# EAGLE schematic PCB_schematic_v1 (EAGLE 9.6.2)
Assembly variants: +3V3
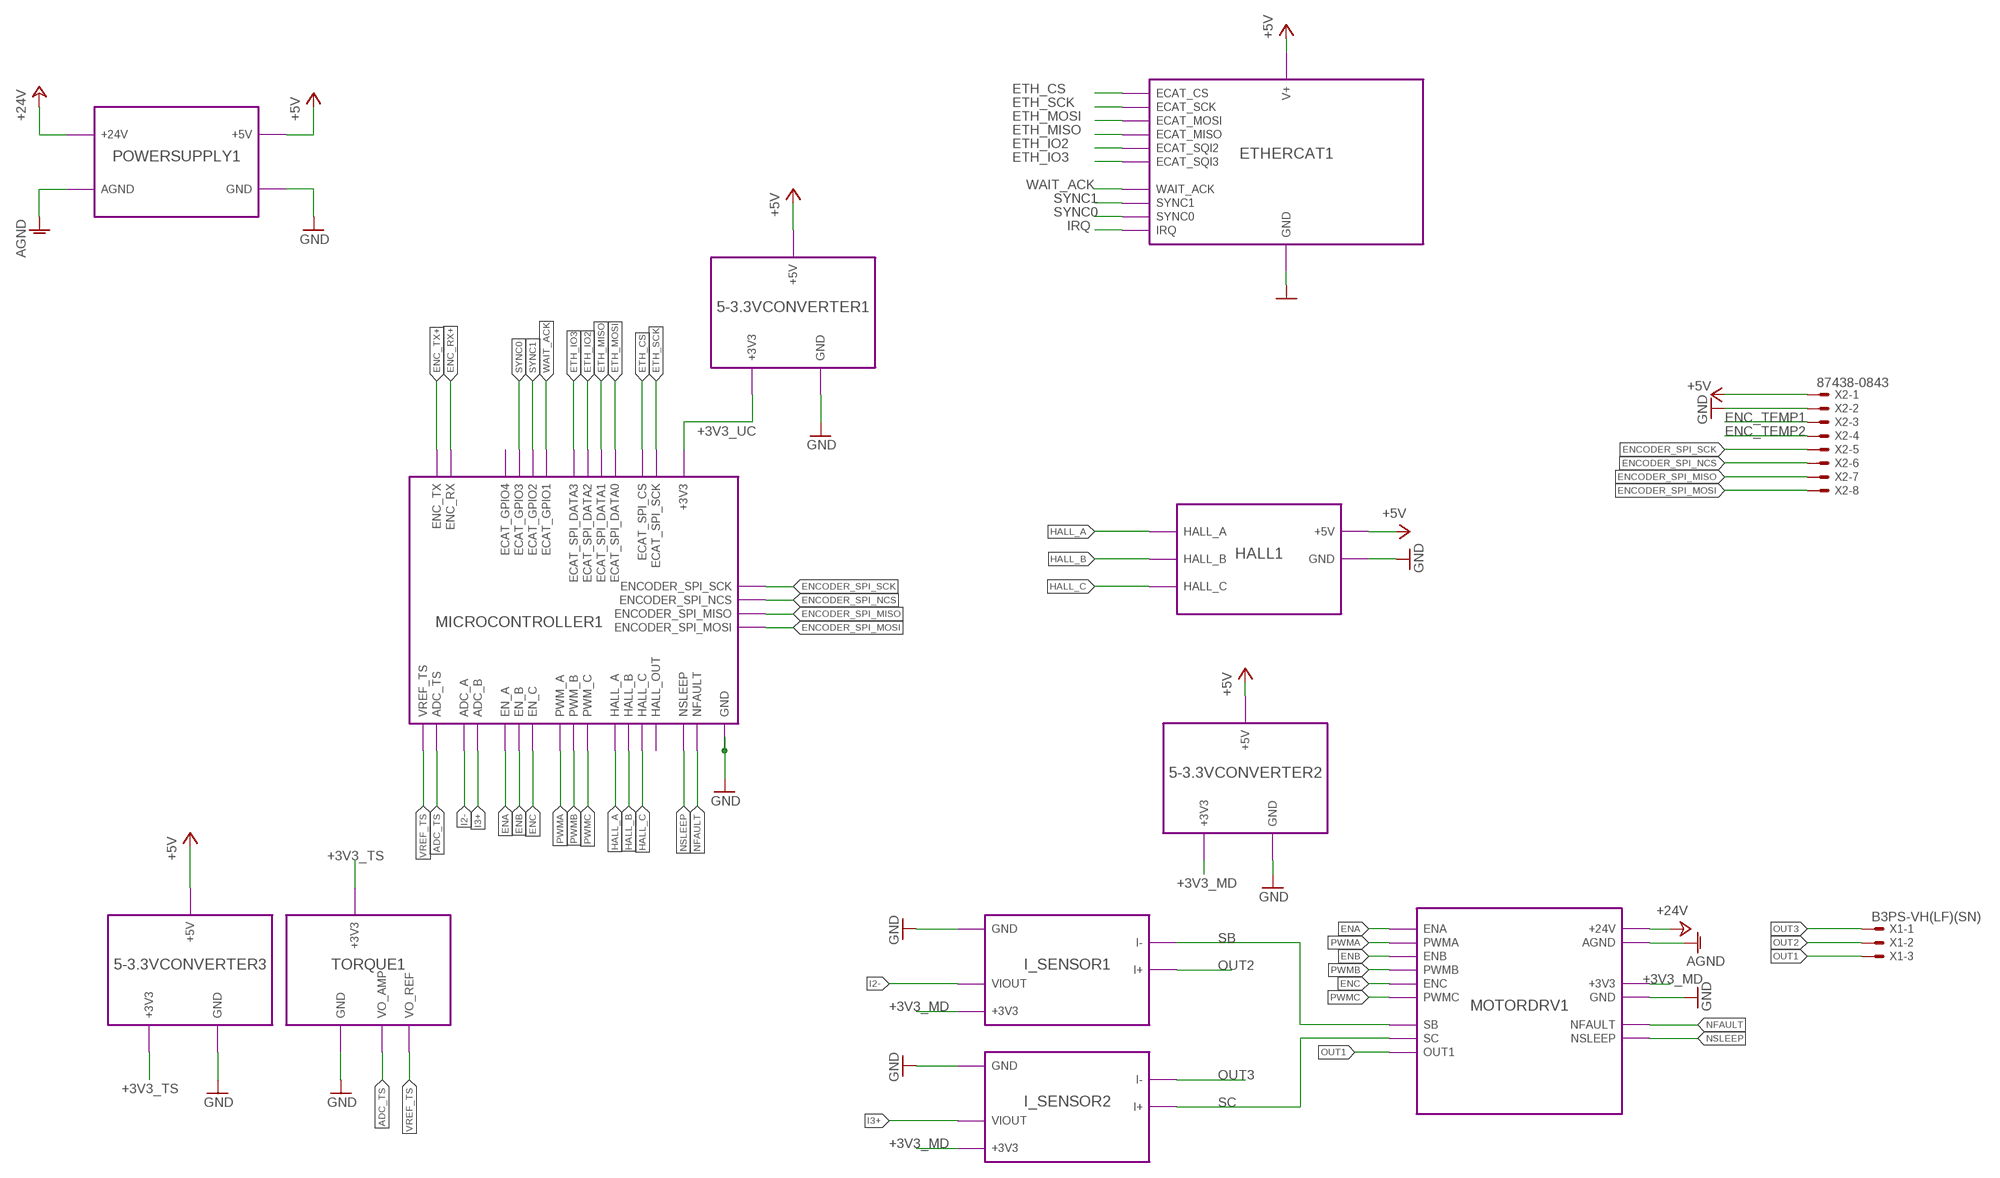
[diagram p0: schematic, sheet 1]

## Parts
X1  B3PS-VH(LF)(SN)  [B3PS-VH(LF)(SN)]
X2  87438-0843  [87438-08]

## Module instances
POWERSUPPLY1 = POWERSUPPLY
MOTORDRV1 = MOTORDRV
I_SENSOR1 = I_SENSOR
I_SENSOR2 = I_SENSOR
TORQUE1 = TORQUE
ETHERCAT1 = ETHERCAT
HALL1 = HALL
5-3.3VCONVERTER3 = 5-3.3VCONVERTER$A
5-3.3VCONVERTER1 = 5-3.3VCONVERTER$B
5-3.3VCONVERTER2 = 5-3.3VCONVERTER$C
MICROCONTROLLER1 = MICROCONTROLLER

## Nets
+3V3_MD: port 5-3.3VCONVERTER2.+3V3 I_SENSOR1.+3V3 I_SENSOR2.+3V3 MOTORDRV1.+3V3
+3V3_TS: port 5-3.3VCONVERTER3.+3V3 TORQUE1.+3V3
+3V3_UC: port 5-3.3VCONVERTER1.+3V3 MICROCONTROLLER1.+3V3
+5V: X2.1 ; port POWERSUPPLY1.+5V ETHERCAT1.V+ 5-3.3VCONVERTER2.+5V HALL1.+5V 5-3.3VCONVERTER1.+5V 5-3.3VCONVERTER3.+5V
+24V [Power]: port MOTORDRV1.+24V POWERSUPPLY1.+24V
ADC_TS: port TORQUE1.VO_AMP MICROCONTROLLER1.ADC_TS
AGND [Power]: port MOTORDRV1.AGND POWERSUPPLY1.AGND
ENA: port MOTORDRV1.ENA MICROCONTROLLER1.EN_A
ENB: port MOTORDRV1.ENB MICROCONTROLLER1.EN_B
ENC: port MOTORDRV1.ENC MICROCONTROLLER1.EN_C
ENC_RX+: port MICROCONTROLLER1.ENC_RX
ENC_TEMP1: X2.3
ENC_TEMP2: X2.4
ENC_TX+: port MICROCONTROLLER1.ENC_TX
ENCODER_SPI_MISO: X2.7 ; port MICROCONTROLLER1.ENCODER_SPI_MISO
ENCODER_SPI_MOSI: X2.8 ; port MICROCONTROLLER1.ENCODER_SPI_MOSI
ENCODER_SPI_NCS: X2.6 ; port MICROCONTROLLER1.ENCODER_SPI_NCS
ENCODER_SPI_SCK: X2.5 ; port MICROCONTROLLER1.ENCODER_SPI_SCK
ETH_CS: port ETHERCAT1.ECAT_CS MICROCONTROLLER1.ECAT_SPI_CS
ETH_IO2: port ETHERCAT1.ECAT_SQI2 MICROCONTROLLER1.ECAT_SPI_DATA2
ETH_IO3: port ETHERCAT1.ECAT_SQI3 MICROCONTROLLER1.ECAT_SPI_DATA3
ETH_MISO: port ETHERCAT1.ECAT_MISO MICROCONTROLLER1.ECAT_SPI_DATA1
ETH_MOSI: port ETHERCAT1.ECAT_MOSI MICROCONTROLLER1.ECAT_SPI_DATA0
ETH_SCK: port ETHERCAT1.ECAT_SCK MICROCONTROLLER1.ECAT_SPI_SCK
GND: X2.2 ; port I_SENSOR1.GND I_SENSOR2.GND MOTORDRV1.GND POWERSUPPLY1.GND ETHERCAT1.GND TORQUE1.GND HALL1.GND 5-3.3VCONVERTER1.GND 5-3.3VCONVERTER3.GND MICROCONTROLLER1.GND 5-3.3VCONVERTER2.GND
HALL_A: port HALL1.HALL_A MICROCONTROLLER1.HALL_A
HALL_B: port HALL1.HALL_B MICROCONTROLLER1.HALL_B
HALL_C: port HALL1.HALL_C MICROCONTROLLER1.HALL_C
I2-: port I_SENSOR1.VIOUT MICROCONTROLLER1.ADC_A
I3+: port I_SENSOR2.VIOUT MICROCONTROLLER1.ADC_B
IRQ: port ETHERCAT1.IRQ
NFAULT: port MOTORDRV1.NFAULT MICROCONTROLLER1.NFAULT
NSLEEP: port MOTORDRV1.NSLEEP MICROCONTROLLER1.NSLEEP
OUT1 [Power]: X1.1 ; port MOTORDRV1.OUT1
OUT2 [Power]: X1.2 ; port I_SENSOR1.I+
OUT3 [Power]: X1.3 ; port I_SENSOR2.I-
PWMA: port MOTORDRV1.PWMA MICROCONTROLLER1.PWM_A
PWMB: port MOTORDRV1.PWMB MICROCONTROLLER1.PWM_B
PWMC: port MOTORDRV1.PWMC MICROCONTROLLER1.PWM_C
SB: port MOTORDRV1.SB I_SENSOR1.I-
SC: port MOTORDRV1.SC I_SENSOR2.I+
SYNC0: port ETHERCAT1.SYNC0 MICROCONTROLLER1.ECAT_GPIO3
SYNC1: port ETHERCAT1.SYNC1 MICROCONTROLLER1.ECAT_GPIO2
VREF_TS: port TORQUE1.VO_REF MICROCONTROLLER1.VREF_TS
WAIT_ACK: port ETHERCAT1.WAIT_ACK MICROCONTROLLER1.ECAT_GPIO1

## Library data of the parts
X1 = msrm:B3PS-VH(LF)(SN): Connector Header Through Hole, Right Angle 3 position 0.156" (3.96mm) 455-1649 ___ Source: Digikey <https://www.digikey.de/product-detail/en/jst-sales-america-inc/B3PS-VH-LF-SN/455-1649-ND/926556> ; Datasheet <http://www.jst-mfg.com/product/pdf/eng/eVH.pdf>; DIGIKEY: 455-1649-ND
X2 = msrm:8743?-08*3: Wire-to-Board 1.50mm (.059") Pitch Header - SMT, Shrouded Source: http://www.molex.com/product/micro/87437.html; DIGIKEY: WM7652CT-ND

## Module POWERSUPPLY
Ports: +24V(pwr) AGND(pwr) +5V(pwr) GND(pwr)
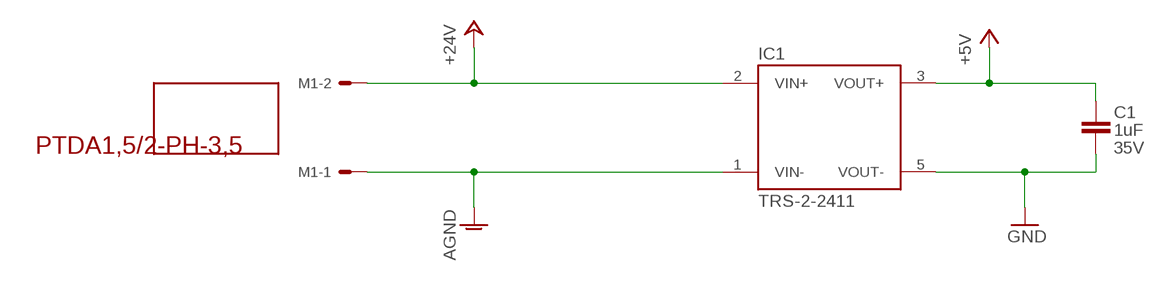
[diagram p1: schematic, module POWERSUPPLY, sheet 1]

### Parts
C1  GRM155R6YA105KE11D  [C0402]
IC1  TRS-2-2411  [7-SMD]
M1  PST1,3/2-3,5  [1945096]
U$1  PTDA1,5/2-PH-3,5  [1725107]

### Nets
+5V: C1.1 IC1.3(VOUT+)
+24V: IC1.2(VIN+) M1.2
AGND: IC1.1(VIN-) M1.1
GND: C1.2 IC1.5(VOUT-)

### Library data of the parts
C1 = msrm:GRM?R6*: CAP CER 0.1UF 100V X5R 0402 Part Numbering <https://search.murata.co.jp/Ceramy/image/img/A01X/partnumbering_e_01.pdf> package: C0402 : 4700pF ___ Source: Digikey <https://www.digikey.de/products/en?keywords=490-6317-1-ND‎> ; Datasheet <https://search.murata.co.jp/Ceramy/image/img/A01X/G101/ENG/GRM155R61H472KA01-01.pdf> 100nF_±10% ___ Source: Digikey <https://www.digikey.de/products/en?keywords=490-10458-1-ND> ; Datasheet <https://search.murata.co.jp/Ceramy/image/img/A01X/G101/ENG/GRM155R62A104KE14-01.pdf> 100nF_±20% ___ Source: Digikey <https://www.digikey.de/products/en?keywords=490-10459-1-ND> ; Datasheet <https://search.murata.co.jp/Ceramy/image/img/A01X/G101/ENG/GRM155R62A104ME14-01.pdf>; CAPACITANCE: 1uF; DIGIKEY: 490-10019-1-ND; TOLERANCE: ±10%; VOLTAGE: 35V
IC1 = msrm:TRS-2-: Isolated Module DC DC Converter 1 Output Datasheet <https://www.tracopower.com/products/trs2.pdf> package: 7-SMD : Input 24V 3300µF / 3.3V ___ Source: Digikey <https://www.digikey.de/products/en?keywords=1951-2041-ND> 1680µF / 5V ___ Source: Digikey <https://www.digikey.de/products/en?keywords=1951-2042-ND> 820µF / 12V ___ Source: Digikey <https://www.digikey.de/products/en?keywords=1951-2043-ND> 680µF / 15V ___ Source: Digikey <https://www.digikey.de/products/en?keywords=1951-2044-ND> 220µF / 24V ___ Source: Digikey <https://www.digikey.de/products/en?keywords=1951-2045-ND> 1000µF / 9V ___ Source: Digikey <https://www.digikey.de/products/en?keywords=TRS2-0919-ND> Input 24V 3300µF / 3.3V ___ Source: Digikey <https://www.digikey.de/products/en?keywords=1951-2057-ND> 1680µF / 5V ___ Source: Digikey <https://www.digikey.de/products/en?keywords=1951-2058-ND> 820µF / 12V ___ Source: Digikey <https://www.digikey.de/products/en?keywords=1951-2059-ND> 680µF / 15V ___ Source: Digikey <https://www.digikey.de/products/en?keywords=1951-2060-ND> 220µF / 24V ___ Source: Digikey <https://www.digikey.de/products/en?keywords=1951-2061-ND> 1000µF / 9V ___ Source: Digikey <https://www.digikey.de/products/en?keywords=TRS2-2419-ND> Input 48V 3300µF / 3.3V ___ Source: Digikey <https://www.digikey.de/products/en?keywords=1951-2065-ND> 1680µF / 5V ___ Source: Digikey <https://www.digikey.de/products/en?keywords=1951-2066-ND> 820µF / 12V ___ Source: Digikey <https://www.digikey.de/products/en?keywords=1951-2067-ND> 680µF / 15V ___ Source: Digikey <https://www.digikey.de/products/en?keywords=1951-2068-ND> 220µF / 24V ___ Source: Digikey <https://www.digikey.de/products/en?keywords=1951-2069-ND> 1000µF / 9V ___ Source: Digikey <https://www.digikey.de/products/en?keywords=TRS2-4819-ND>; CURRENT: 400mA; DIGIKEY: 1951-2058-ND; INPUT: 24V; MAX_CAPACITANCE: 1680uF; OUTPUT: 5V
M1 = msrm:PST*/2-?: 2 Position Terminal Block Header, Male Pins, Unshrouded 0.138" (3.50mm) Vertical Through Hole 277-1749-ND ___ Source: Digikey <https://www.digikey.de/products/en?keywords=277-1749-ND> ; Datasheet <https://media.digikey.com/pdf/Data%20Sheets/Phoenix%20Contact%20PDFs/Combicon%20Compact%20Series.pdf>; DIGIKEY: 277-1749-ND; PITCH: 3,5
U$1 = msrm:PTDA*/2-PH: 2 Position Terminal Block Plug for Unshrouded Header 0.138" (3.50mm) 45° Free Hanging (In-Line) 277-17182-ND ___ Source: Digikey <https://www.digikey.de/products/en?keywords=277-17182-ND> ; Datasheet <https://media.digikey.com/PDF/Data%20Sheets/Phoenix%20Contact%20PDFs/1725107.pdf>; DIGIKEY: 277-17182-ND

## Module MOTORDRV
Ports: ENA(io) PWMA(io) ENB(io) PWMB(io) ENC(io) PWMC(io) SB(io) SC(io) OUT1(io) +24V(io) AGND(io) +3V3(io) GND(io) NFAULT(io) NSLEEP(io)
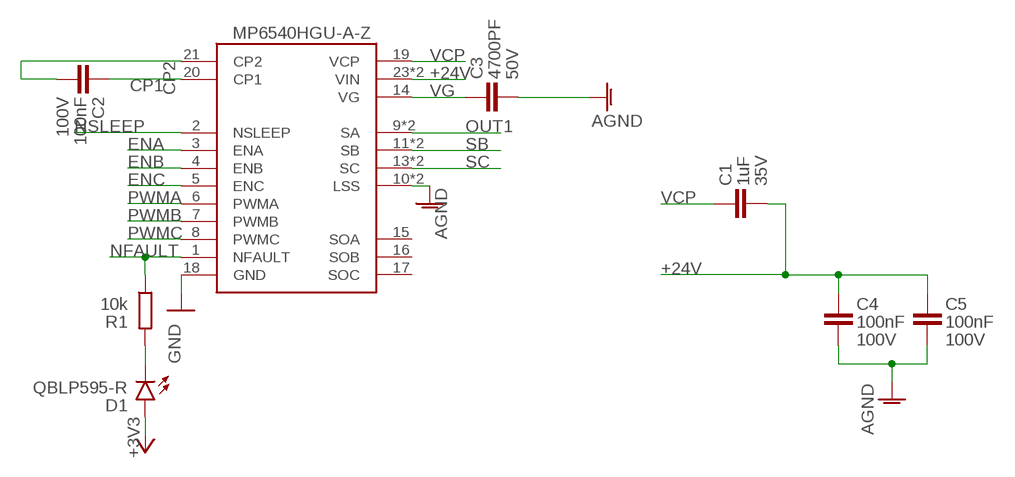
[diagram p2: schematic, module MOTORDRV, sheet 1]

### Parts
C1  GRM155R6YA105KE11D  [C0402]
C2  GRM155R62A104KE14  [C0402]
C3  GRM155R61H472KA01D  [C0402]
C4  GRM155R62A104KE14  [C0402]
C5  GRM155R62A104KE14  [C0402]
D1  QBLP595-R  [LED0402]
IC1  MP6540HGU-P  [MP6540HGUP]
R1  RT0402BRD0710KL  [R0402]

### Nets
+3V3: D1.2(A)
+24V: C1.2 C4.1 C5.1 IC1.23(VIN) IC1.25(VIN)
AGND: C3.2 C4.2 C5.2 IC1.10(LSS) IC1.12(LSS)
CP1: C2.1 IC1.20(CP1)
CP2: C2.2 IC1.21(CP2)
ENA: IC1.3(ENA)
ENB: IC1.4(ENB)
ENC: IC1.5(ENC)
GND: IC1.18(GND)
N$1: D1.1(C) R1.2
NFAULT: IC1.1(NFAULT) R1.1
NSLEEP: IC1.2(NSLEEP)
OUT1: IC1.9(SA) IC1.26(SA)
PWMA: IC1.6(PWMA)
PWMB: IC1.7(PWMB)
PWMC: IC1.8(PWMC)
SB: IC1.11(SB) IC1.24(SB)
SC: IC1.13(SC) IC1.22(SC)
VCP: C1.1 IC1.19(VCP)
VG: C3.1 IC1.14(VG)
Unconnected: IC1.15(SOA) IC1.16(SOB) IC1.17(SOC)

### Library data of the parts
C1 = msrm:GRM?R6*: CAP CER 0.1UF 100V X5R 0402 Part Numbering <https://search.murata.co.jp/Ceramy/image/img/A01X/partnumbering_e_01.pdf> package: C0402 : 4700pF ___ Source: Digikey <https://www.digikey.de/products/en?keywords=490-6317-1-ND‎> ; Datasheet <https://search.murata.co.jp/Ceramy/image/img/A01X/G101/ENG/GRM155R61H472KA01-01.pdf> 100nF_±10% ___ Source: Digikey <https://www.digikey.de/products/en?keywords=490-10458-1-ND> ; Datasheet <https://search.murata.co.jp/Ceramy/image/img/A01X/G101/ENG/GRM155R62A104KE14-01.pdf> 100nF_±20% ___ Source: Digikey <https://www.digikey.de/products/en?keywords=490-10459-1-ND> ; Datasheet <https://search.murata.co.jp/Ceramy/image/img/A01X/G101/ENG/GRM155R62A104ME14-01.pdf>; CAPACITANCE: 1uF; DIGIKEY: 490-10019-1-ND; TOLERANCE: ±10%; VOLTAGE: 35V
C2 C4 C5 = msrm:GRM?R6*: CAP CER 0.1UF 100V X5R 0402 Part Numbering <https://search.murata.co.jp/Ceramy/image/img/A01X/partnumbering_e_01.pdf> package: C0402 : 4700pF ___ Source: Digikey <https://www.digikey.de/products/en?keywords=490-6317-1-ND‎> ; Datasheet <https://search.murata.co.jp/Ceramy/image/img/A01X/G101/ENG/GRM155R61H472KA01-01.pdf> 100nF_±10% ___ Source: Digikey <https://www.digikey.de/products/en?keywords=490-10458-1-ND> ; Datasheet <https://search.murata.co.jp/Ceramy/image/img/A01X/G101/ENG/GRM155R62A104KE14-01.pdf> 100nF_±20% ___ Source: Digikey <https://www.digikey.de/products/en?keywords=490-10459-1-ND> ; Datasheet <https://search.murata.co.jp/Ceramy/image/img/A01X/G101/ENG/GRM155R62A104ME14-01.pdf>; CAPACITANCE: 100nF; DIGIKEY: 490-10458-1-ND; TOLERANCE: ±10%; VOLTAGE: 100V
C3 = msrm:GRM?R6*: CAP CER 0.1UF 100V X5R 0402 Part Numbering <https://search.murata.co.jp/Ceramy/image/img/A01X/partnumbering_e_01.pdf> package: C0402 : 4700pF ___ Source: Digikey <https://www.digikey.de/products/en?keywords=490-6317-1-ND‎> ; Datasheet <https://search.murata.co.jp/Ceramy/image/img/A01X/G101/ENG/GRM155R61H472KA01-01.pdf> 100nF_±10% ___ Source: Digikey <https://www.digikey.de/products/en?keywords=490-10458-1-ND> ; Datasheet <https://search.murata.co.jp/Ceramy/image/img/A01X/G101/ENG/GRM155R62A104KE14-01.pdf> 100nF_±20% ___ Source: Digikey <https://www.digikey.de/products/en?keywords=490-10459-1-ND> ; Datasheet <https://search.murata.co.jp/Ceramy/image/img/A01X/G101/ENG/GRM155R62A104ME14-01.pdf>; CAPACITANCE: 4700PF; DIGIKEY: 490-6317-1-ND‎; TOLERANCE: ±10%; VOLTAGE: 50V
D1 = msrm:QBLP595-: LED 0402 SMD, 2V package: 0402 : Yellow-Green ___ Source: Digikey <https://www.digikey.de/product-detail/en/qt-brightek-qtb/QBLP595-AG/1516-1218-1-ND/6201915> ; Datasheet <http://www.qt-brightek.com/datasheet/QBLP595%20Series.pdf> Blue ___ Source: Digikey <https://www.digikey.de/product-detail/en/qt-brightek-qtb/QBLP595-IB/1516-1215-1-ND/6201912> ; Datasheet <http://www.qt-brightek.com/datasheet/QBLP595%20Series.pdf> Green ___ Source: Digikey <https://www.digikey.de/product-detail/en/qt-brightek-qtb/QBLP595-IG/1516-1216-1-ND/6201913> ; Datasheet <http://www.qt-brightek.com/datasheet/QBLP595%20Series.pdf> Orange ___ Source: Digikey <https://www.digikey.de/product-detail/en/qt-brightek-qtb/QBLP595-O/1516-1220-1-ND/6201917> ; Datasheet <http://www.qt-brightek.com/datasheet/QBLP595%20Series.pdf> Red ___ Source: Digikey <https://www.digikey.de/product-detail/en/qt-brightek-qtb/QBLP595-R/1516-1217-1-ND/6201914> ; Datasheet <http://www.qt-brightek.com/datasheet/QBLP595%20Series.pdf> Yellow ___ Source: Digikey <https://www.digikey.de/product-detail/en/qt-brightek-qtb/QBLP595-Y/1516-1219-1-ND/6201916> ; Datasheet <http://www.qt-brightek.com/datasheet/QBLP595%20Series.pdf>; COLOR: Red; DIGIKEY: 1516-1217-1-ND
IC1 = msrm:MP6540H*: MP6540HGU-P - Multiphase Motor Driver Power MOSFET PWM 26-QFN (5x5) Source: Digikey <https://www.digikey.de/product-detail/en/MP6540HGU-P/1589-MP6540HGU-PCT-ND/13211361?utm_campaign=buynow&utm_medium=aggregator&curr=eur&utm_source=octopart> ; Datasheet <https://www.digikey.de/en/product-highlight/m/mps/mp6540h-mp6540ha-dc-motor-drivers>; DIGIKEY: 1589-MP6540HGU-PCT-ND
R1 = msrm:RT?BRD07*L: SMD-Resistor ±0.1% 0.063W, 1/16W Chip Resistor 0402 (1005 Metric) Thin Film package: R0402 : 1k ___ Source: Digikey <https://www.digikey.de/products/en?keywords=%20YAG1386CT-ND> ; Datasheet <https://www.yageo.com/upload/media/product/productsearch/datasheet/rchip/PYu-RT_1-to-0.01_RoHS_L_12.pdf> 2k05 ___ Source: Digikey <https://www.digikey.de/products/en?keywords=YAG1400CT-ND> ; Datasheet <https://www.yageo.com/upload/media/product/productsearch/datasheet/rchip/PYu-RT_1-to-0.01_RoHS_L_12.pdf> 3k2 ___ Source: Digikey <YAG4255CT-ND> ; Datasheet <https://www.yageo.com/upload/media/product/productsearch/datasheet/rchip/PYu-RT_1-to-0.01_RoHS_L_12.pdf> 4k99 ___ Source: Digikey <https://www.digikey.de/products/en?keywords=YAG1447CT-ND> ; Datasheet <https://www.yageo.com/upload/media/product/productsearch/datasheet/rchip/PYu-RT_1-to-0.01_RoHS_L_12.pdf> 10k ___ Source: Digikey <https://www.digikey.de/products/en?keywords=%E2%80%8EA119918CT-ND%E2%80%8E> ; Datasheet <https://www.yageo.com/upload/media/product/productsearch/datasheet/rchip/PYu-RT_1-to-0.01_RoHS_L_12.pdf> 12k ___ Source: Digikey <https://www.digikey.de/products/en?keywords=YAG1354CT-ND> ; Datasheet <https://www.yageo.com/upload/media/product/productsearch/datasheet/rchip/PYu-RT_1-to-0.01_RoHS_L_12.pdf> 22k ___ Source: Digikey <https://www.digikey.de/products/en?keywords=YAG4210CT-ND> ; Datasheet <https://www.yageo.com/upload/media/product/productsearch/datasheet/rchip/PYu-RT_1-to-0.01_RoHS_L_12.pdf> 56k ___ Source: Digikey <https://www.digikey.de/products/en?keywords=YAG1454CT-ND%20> ; Datasheet <https://www.yageo.com/upload/media/product/productsearch/datasheet/rchip/PYu-RT_1-to-0.01_RoHS_L_12.pdf> 60k4 ___ Source: Digikey <https://www.digikey.de/products/en?keywords=YAG1461CT-ND> ; Datasheet <https://www.yageo.com/upload/media/product/productsearch/datasheet/rchip/PYu-RT_1-to-0.01_RoHS_L_12.pdf> 270R ___ Source: Digikey <https://www.digikey.de/products/en?keywords=YAG1396CT-ND> ; Datasheet <https://www.yageo.com/upload/media/product/productsearch/datasheet/rchip/PYu-RT_1-to-0.01_RoHS_L_12.pdf>; DIGIKEY: ‎A119918CT-ND‎; RVALUE: 10k; SPICEPREFIX: R

## Module I_SENSOR
Ports: GND(pwr) VIOUT(out) +3V3(pwr) I-(io) I+(io)
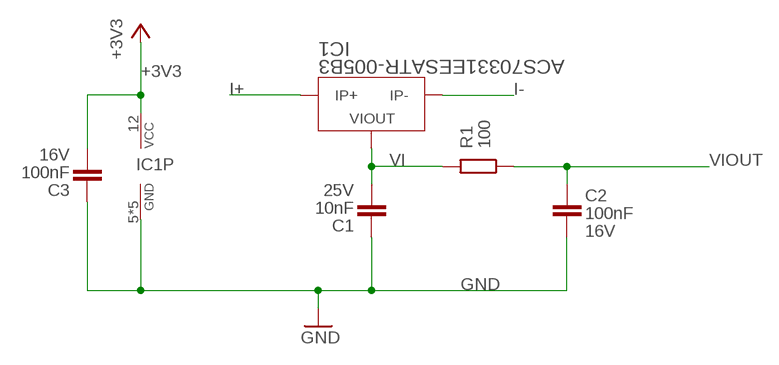
[diagram p3: schematic, module I_SENSOR, sheet 1]

### Parts
C1  GCM155R71E103KA37  [C0402]
C2  GCM155R71C104JA55  [C0402]
C3  GCM155R71C104JA55  [C0402]
IC1  ACS70331EESATR-005B3  [QFN12-ES]
R1  RT0402FRE07100RL  [R0402]

### Nets
+3V3: C3.2 IC1.12(VCC)
GND: C1.1 C2.2 C3.1 IC1.5(GND) IC1.6(GND) IC1.8(GND) IC1.9(GND) IC1.11(GND)
I+: IC1.1,2(IP+)
I-: IC1.3,4(IP-)
VI: C1.2 IC1.10(VIOUT) R1.2
VIOUT: C2.1 R1.1

### Library data of the parts
C1 = msrm:GCM?R7*: Multilayer Ceramic Capacitors Chip Multilayer Ceramic Capacitors for Automotive –55 to 125°C Sources: Catalogue <https://www.murata.com/~/media/webrenewal/support/library/catalog/products/capacitor/mlcc/c03e.ashx?la=en-us> Part Numbering <https://search.murata.co.jp/Ceramy/image/img/A01X/partnumbering_e_02.pdf> package: C0201 : 470pF ___ Source: Digikey <https://www.digikey.de/products/en?keywords=490-17744-1-ND> ; Datasheet <https://search.murata.co.jp/Ceramy/image/img/A01X/G101/ENG/GCM033R71E471KA03-01.pdf> package: C0402 : 100nF ___ Source: Digikey <https://www.digikey.de/products/en?keywords=490-16433-1-ND> ; Datasheet <https://search.murata.co.jp/Ceramy/image/img/A01X/G101/ENG/GCM155R71C104JA55-01.pdf> 220nF ___ Source: Digikey <https://www.digikey.de/products/en?keywords=490-10671-1-ND> ; Datasheet <https://www.murata.com/-/media/webrenewal/support/library/catalog/products/capacitor/ceramiccapacitor/c03e.ashx?la=en-us&cvid=20200707014404000000> 6.8nF ___ Source: Digikey <https://www.digikey.de/products/en?keywords=490-12655-1-ND> ; Datasheet <https://search.murata.co.jp/Ceramy/image/img/A01X/G101/ENG/GCM155R71C683KA55-01.pdf> 10nF ___ Source: Digikey <https://www.digikey.de/products/en?keywords=490-6043-1-ND> ; Datasheet <https://search.murata.co.jp/Ceramy/image/img/A01X/G101/ENG/GCM155R71E103KA37-01.pdf> 22nF ___ Source: Digikey <https://www.digikey.de/products/en?keywords=490-6044-1-ND> ; Datasheet <https://search.murata.co.jp/Ceramy/image/img/A01X/G101/ENG/GCM155R71E223KA55-01.pdf> 470pF ___ Source: Digikey <https://www.digikey.de/products/en?keywords=490-4913-1-ND> ; Datasheet <https://search.murata.co.jp/Ceramy/image/img/A01X/G101/ENG/GCM155R71H471KA37-01.pdf> package: C0603 : 1µF ___ Source: Digikey <https://www.digikey.de/products/en?keywords=490-5241-1-ND> ; Datasheet <https://www.murata.com/-/media/webrenewal/support/library/catalog/products/capacitor/ceramiccapacitor/c03e.ashx?la=en-us&cvid=20200707014404000000> 470nF ___ Source: Digikey <https://www.digikey.de/products/en?keywords=490-12589-1-ND> ; Datasheet <https://search.murata.co.jp/Ceramy/image/img/A01X/G101/ENG/GCM188R71C474KA55-01.pdf> 10nF ___ Source: Digikey <https://www.digikey.de/products/en?keywords=490-4781-1-ND> ; Datasheet <https://search.murata.co.jp/Ceramy/image/img/A01X/G101/ENG/GCM188R72A103KA37-01.pdf> 22nF ___ Source: Digikey <https://www.digikey.de/products/en?keywords=490-4782-1-ND> ; Datasheet <https://www.murata.com/-/media/webrenewal/support/library/catalog/products/capacitor/ceramiccapacitor/c03e.ashx?la=en-us&cvid=20200707014404000000> package: C0805 : 10µF ___ Source: Digikey <https://www.digikey.de/products/en?keywords=490-14361-1-ND> ; Datasheet <https://search.murata.co.jp/Ceramy/image/img/A01X/G101/ENG/GCM21BR70J106KE22-01.pdf> 2.2µF ___ Source: Digikey <https://www.digikey.de/products/en?keywords=490-4786-1-ND> ; Datasheet <https://search.murata.co.jp/Ceramy/image/img/A01X/G101/ENG/GCM21BR71C225KA64-01.pdf> 470nF ___ Source: Digikey <https://www.digikey.de/products/en?keywords=490-4788-1-ND> ; Datasheet <https://search.murata.co.jp/Ceramy/image/img/A01X/G101/ENG/GCM21BR71H474KA55-01.pdf> 100nF ___ Source: Digikey <https://www.digikey.de/products/en?keywords=490-8051-1-ND> ; Datasheet <https://search.murata.co.jp/Ceramy/image/img/A01X/G101/ENG/GCM21BR72A104KA37-01.pdf> package: C0805K : 220nF ___ Source: Digikey <https://www.digikey.de/products/en?keywords=490-8306-1-ND> ; Datasheet <https://search.murata.co.jp/Ceramy/image/img/A01X/G101/ENG/GRM21AR72A224KAC5-01.pdf> package: C1206 : 10µF ___ Source: Digikey <https://www.digikey.de/products/en?keywords=490-14746-1-ND> ; Datasheet <https://search.murata.co.jp/Ceramy/image/img/A01X/G101/ENG/GCM31CR71C106KA64-01.pdf> 2.2µF ___ Source: Digikey <https://www.digikey.de/products/en?keywords=490-11169-1-ND> ; Datasheet <https://search.murata.co.jp/Ceramy/image/img/A01X/G101/ENG/GCM31CR71H225KA55-01.pdf> package: C1206 : 2220nF ___ Source: Digikey <https://www.digikey.de/products/en?keywords=490-4975-1-ND> ; Datasheet <https://search.murata.co.jp/Ceramy/image/img/A01X/G101/ENG/GCM31MR72A224KA37-01.pdf>; CAPACITANCE: 10nF; DIGIKEY: 490-6043-1-ND; TOLERANCE: ±10%; VOLTAGE: 25V
C2 C3 = msrm:GCM?R7*: Multilayer Ceramic Capacitors Chip Multilayer Ceramic Capacitors for Automotive –55 to 125°C Sources: Catalogue <https://www.murata.com/~/media/webrenewal/support/library/catalog/products/capacitor/mlcc/c03e.ashx?la=en-us> Part Numbering <https://search.murata.co.jp/Ceramy/image/img/A01X/partnumbering_e_02.pdf> package: C0201 : 470pF ___ Source: Digikey <https://www.digikey.de/products/en?keywords=490-17744-1-ND> ; Datasheet <https://search.murata.co.jp/Ceramy/image/img/A01X/G101/ENG/GCM033R71E471KA03-01.pdf> package: C0402 : 100nF ___ Source: Digikey <https://www.digikey.de/products/en?keywords=490-16433-1-ND> ; Datasheet <https://search.murata.co.jp/Ceramy/image/img/A01X/G101/ENG/GCM155R71C104JA55-01.pdf> 220nF ___ Source: Digikey <https://www.digikey.de/products/en?keywords=490-10671-1-ND> ; Datasheet <https://www.murata.com/-/media/webrenewal/support/library/catalog/products/capacitor/ceramiccapacitor/c03e.ashx?la=en-us&cvid=20200707014404000000> 6.8nF ___ Source: Digikey <https://www.digikey.de/products/en?keywords=490-12655-1-ND> ; Datasheet <https://search.murata.co.jp/Ceramy/image/img/A01X/G101/ENG/GCM155R71C683KA55-01.pdf> 10nF ___ Source: Digikey <https://www.digikey.de/products/en?keywords=490-6043-1-ND> ; Datasheet <https://search.murata.co.jp/Ceramy/image/img/A01X/G101/ENG/GCM155R71E103KA37-01.pdf> 22nF ___ Source: Digikey <https://www.digikey.de/products/en?keywords=490-6044-1-ND> ; Datasheet <https://search.murata.co.jp/Ceramy/image/img/A01X/G101/ENG/GCM155R71E223KA55-01.pdf> 470pF ___ Source: Digikey <https://www.digikey.de/products/en?keywords=490-4913-1-ND> ; Datasheet <https://search.murata.co.jp/Ceramy/image/img/A01X/G101/ENG/GCM155R71H471KA37-01.pdf> package: C0603 : 1µF ___ Source: Digikey <https://www.digikey.de/products/en?keywords=490-5241-1-ND> ; Datasheet <https://www.murata.com/-/media/webrenewal/support/library/catalog/products/capacitor/ceramiccapacitor/c03e.ashx?la=en-us&cvid=20200707014404000000> 470nF ___ Source: Digikey <https://www.digikey.de/products/en?keywords=490-12589-1-ND> ; Datasheet <https://search.murata.co.jp/Ceramy/image/img/A01X/G101/ENG/GCM188R71C474KA55-01.pdf> 10nF ___ Source: Digikey <https://www.digikey.de/products/en?keywords=490-4781-1-ND> ; Datasheet <https://search.murata.co.jp/Ceramy/image/img/A01X/G101/ENG/GCM188R72A103KA37-01.pdf> 22nF ___ Source: Digikey <https://www.digikey.de/products/en?keywords=490-4782-1-ND> ; Datasheet <https://www.murata.com/-/media/webrenewal/support/library/catalog/products/capacitor/ceramiccapacitor/c03e.ashx?la=en-us&cvid=20200707014404000000> package: C0805 : 10µF ___ Source: Digikey <https://www.digikey.de/products/en?keywords=490-14361-1-ND> ; Datasheet <https://search.murata.co.jp/Ceramy/image/img/A01X/G101/ENG/GCM21BR70J106KE22-01.pdf> 2.2µF ___ Source: Digikey <https://www.digikey.de/products/en?keywords=490-4786-1-ND> ; Datasheet <https://search.murata.co.jp/Ceramy/image/img/A01X/G101/ENG/GCM21BR71C225KA64-01.pdf> 470nF ___ Source: Digikey <https://www.digikey.de/products/en?keywords=490-4788-1-ND> ; Datasheet <https://search.murata.co.jp/Ceramy/image/img/A01X/G101/ENG/GCM21BR71H474KA55-01.pdf> 100nF ___ Source: Digikey <https://www.digikey.de/products/en?keywords=490-8051-1-ND> ; Datasheet <https://search.murata.co.jp/Ceramy/image/img/A01X/G101/ENG/GCM21BR72A104KA37-01.pdf> package: C0805K : 220nF ___ Source: Digikey <https://www.digikey.de/products/en?keywords=490-8306-1-ND> ; Datasheet <https://search.murata.co.jp/Ceramy/image/img/A01X/G101/ENG/GRM21AR72A224KAC5-01.pdf> package: C1206 : 10µF ___ Source: Digikey <https://www.digikey.de/products/en?keywords=490-14746-1-ND> ; Datasheet <https://search.murata.co.jp/Ceramy/image/img/A01X/G101/ENG/GCM31CR71C106KA64-01.pdf> 2.2µF ___ Source: Digikey <https://www.digikey.de/products/en?keywords=490-11169-1-ND> ; Datasheet <https://search.murata.co.jp/Ceramy/image/img/A01X/G101/ENG/GCM31CR71H225KA55-01.pdf> package: C1206 : 2220nF ___ Source: Digikey <https://www.digikey.de/products/en?keywords=490-4975-1-ND> ; Datasheet <https://search.murata.co.jp/Ceramy/image/img/A01X/G101/ENG/GCM31MR72A224KA37-01.pdf>; CAPACITANCE: 100nF; DIGIKEY: 490-16433-1-ND; TOLERANCE: ±5%; VOLTAGE: 16V
IC1 = msrm:ACS70331E?: ACS70331 current sensor small package, Package:12-contact QFN with fused current loop. Temperature(°C): –40 to 85. Packing: 1500 pieces per reel. package: QFN12-ES 620-1889-1-ND___Source: Digikey <https://www.digikey.de/products/en?keywords=620-1889-1-ND> ; Datasheet <https://www.allegromicro.com/~/media/Files/Datasheets/ACS70331-Datasheet.ashx> 620-1890-1-ND___Source: Digikey <https://www.digikey.de/products/en?keywords=620-1890-1-ND> ; Datasheet <https://www.allegromicro.com/~/media/Files/Datasheets/ACS70331-Datasheet.ashx> 620-1887-1-ND___Source: Digikey <https://www.digikey.de/products/en?keywords=620-1887-1-ND> ; Datasheet <https://www.allegromicro.com/~/media/Files/Datasheets/ACS70331-Datasheet.ashx> 620-1888-1-ND___Source: Digikey <https://www.digikey.de/products/en?keywords=620-1888-1-ND> ; Datasheet <https://www.allegromicro.com/~/media/Files/Datasheets/ACS70331-Datasheet.ashx> package: SOIC8 ACS70331EOLCTR-2P5B3-ND___Source: Digikey <https://www.digikey.de/products/en?keywords=ACS70331EOLCTR-2P5B3> ; Datasheet <https://www.allegromicro.com/~/media/Files/Datasheets/ACS70331-Datasheet.ashx> ACS70331EOLCTR-2P5U3-ND ___Source: Digikey <https://www.digikey.de/products/en?keywords=ACS70331EOLCTR-2P5U3> ; Datasheet <https://www.allegromicro.com/~/media/Files/Datasheets/ACS70331-Datasheet.ashx> ACS70331EOLCTR-005B3-ND___Source: Digikey <https://www.digikey.de/products/en?keywords=ACS70331EOLCTR-005B3> ; Datasheet <https://www.allegromicro.com/~/media/Files/Datasheets/ACS70331-Datasheet.ashx> ACS70331EOLCTR-005U3-ND___Source: Digikey <https://www.digikey.de/products/en?keywords=ACS70331EOLCTR-005U3> ; Datasheet <https://www.allegromicro.com/~/media/Files/Datasheets/ACS70331-Datasheet.ashx>; CURRENT_RANGE: -5~5A; DIGIKEY: 620-1887-1-ND; SENSITIVITY: 200mV/A
R1 = msrm:RT?FRE07*L: SMD RESISTOR ± 1% Tol, Paper/PE taping reel, 50 ppm/°C, 7 inch dia. Reel Datasheet <http://www.yageo.com/documents/recent/PYu-RT_1-to-0.01_RoHS_L_11.pdf> package: 0201 : 0R ___ Source: Digikey <https://www.digikey.de/products/en?keywords=311-0.0MCT-ND> 1k ___ Source: Digikey <https://www.digikey.de/products/en?keywords=RT0201FRE071KL-ND> 10k ___ Source: Digikey <https://www.digikey.de/products/en?keywords=RT0201FRE0710KL-ND> 100 ___ Source: Digikey <https://www.digikey.de/products/en?keywords=RT0201FRE07100RL-ND> 330 ___ Source: Digikey <https://www.digikey.de/products/en?keywords=RT0201FRE07330RL-ND> package: 0402 : 0R ___ Source: Digikey <https://www.digikey.de/products/en?keywords=311-0.0LRCT-ND> 1k ___ Source: Digikey <https://www.digikey.de/products/en?keywords=%20YAG1234CT-ND> 2k2 ___ Source: Digikey <https://www.digikey.de/products/en?keywords=RT0402FRE072K2L-ND> 2k ___ Source: Digikey <https://www.digikey.de/products/en?keywords=YAG3345CT-ND> 4k7 ___ Source: Digikey <https://www.digikey.de/products/en?keywords=YAG3347CT-ND%20> 10k ___ Source: Digikey <https://www.digikey.de/products/en?keywords=YAG1233CT-ND> 12k1 ___ Source: Digikey <https://www.digikey.de/products/en?keywords=RT0402FRE0712K1L-ND> 49R9 ___ Source: Digikey <https://www.digikey.de/products/en?keywords=YAG3346CT-ND> 56k ___ Source: Digikey <https://www.digikey.de/products/en?keywords=RT0402FRE0756K2L-ND> 100k ___ Source: Digikey <https://www.digikey.de/products/en?keywords=YAG2307CT-ND> 100 ___ Source: Digikey <https://www.digikey.de/products/en?keywords=YAG3342CT-ND> 150 ___ Source: Digikey <https://www.digikey.de/product-detail/en/yageo/RT0402FRE07150RL/13-RT0402FRE07150RLCT-ND/12705162> 300 ___ Source: Digikey <https://www.digikey.de/products/en?keywords=RT0402FRE07300RL-ND> package: 0603 : 0R ___ Source: Digikey <https://www.digikey.de/products/en?keywords=311-0.0HRCT-ND> 1k ___ Source: Digikey <https://www.digikey.de/products/en?keywords=YAG2323CT-ND> 10k ___ Source: Digikey <https://www.digikey.de/products/en?keywords=YAG2321CT-ND> 100k ___ Source: Digikey <https://www.digikey.de/products/en?keywords=YAG2319CT-ND> 100 ___ Source: Digikey <https://www.digikey.de/products/en?keywords=YAG2320CT-ND> 300 ___ Source: Digikey <https://www.digikey.de/products/en?keywords=RT0603FRE07300RL-ND> 330 ___ Source: Digikey <https://www.digikey.de/products/en?keywords=YAG5957CT-ND>; DIGIKEY: YAG3342CT-ND; RVALUE: 100; SPICEPREFIX: R

## Module ETHERCAT
Ports: ECAT_CS(in) ECAT_MISO(io) ECAT_MOSI(io) ECAT_SCK(in) ECAT_SQI2(io) ECAT_SQI3(io) V+(pwr) GND(pwr) WAIT_ACK(out) SYNC0(out) SYNC1(out) IRQ(out)
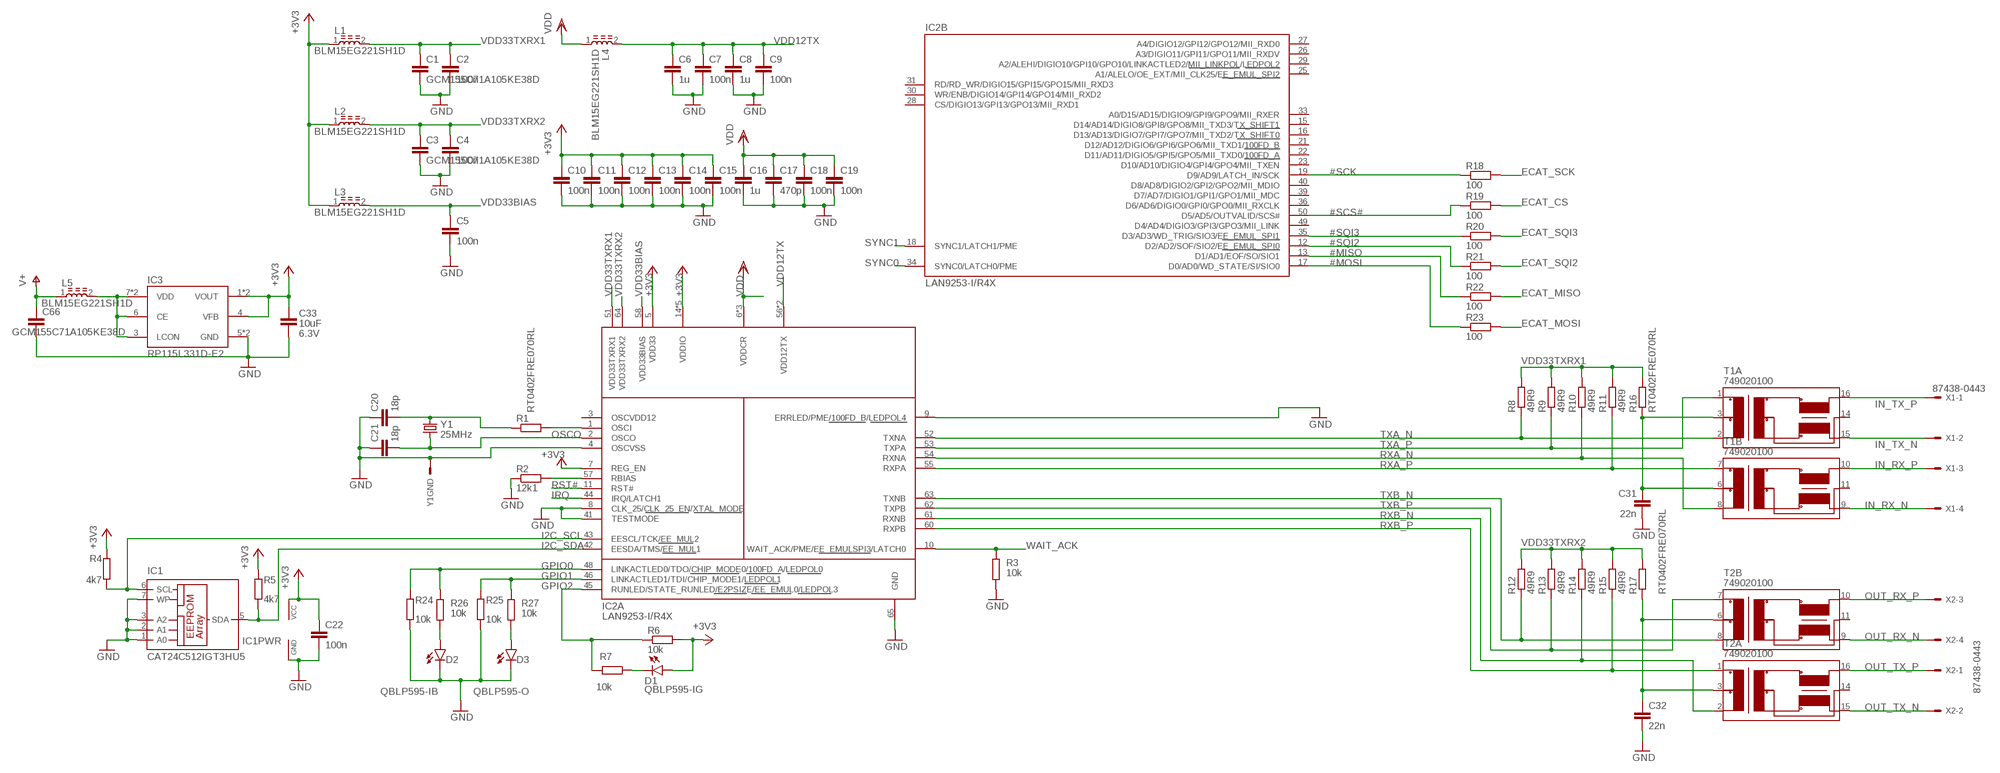
[diagram p4: schematic, module ETHERCAT, sheet 1]

### Parts
C1  GCM155C71A105KE38D  [C0402]
C2  100n  GCM155R71C104JA55  [C0402]
C3  GCM155C71A105KE38D  [C0402]
C4  100n  GCM155R71C104JA55  [C0402]
C5  100n  GCM155R71C104JA55  [C0402]
C6  1u  GCM155C71A105KE38D  [C0402]
C7  100n  GCM155R71C104JA55  [C0402]
C8  1u  GCM155C71A105KE38D  [C0402]
C9  100n  GCM155R71C104JA55  [C0402]
C10  100n  GCM155R71C104JA55  [C0402]
C11  100n  GCM155R71C104JA55  [C0402]
C12  100n  GCM155R71C104JA55  [C0402]
C13  100n  GCM155R71C104JA55  [C0402]
C14  100n  GCM155R71C104JA55  [C0402]
C15  100n  GCM155R71C104JA55  [C0402]
C16  1u  GCM155C71A105KE38D  [C0402]
C17  470p  GCM155R71H471KA37  [C0402]
C18  100n  GCM155R71C104JA55  [C0402]
C19  100n  GCM155R71C104JA55  [C0402]
C20  18p  GCM1555C1H180JA16  [C0402]
C21  18p  GCM1555C1H180JA16  [C0402]
C22  100n  GCM155R71C104JA55  [C0402]
C31  22n  GCM155R71E223KA55  [C0402]
C32  22n  GCM155R71E223KA55  [C0402]
C33  GRM155C80J106ME11D  [C0402]
C66  GCM155C71A105KE38D  [C0402]  (not fitted in variant +3V3)
D1  QBLP595-IG  [LED0402]
D2  QBLP595-IB  [LED0402]
D3  QBLP595-O  [LED0402]
IC1  CAT24C512IGT3HU5  [UDFN8]
IC2  LAN9253-I/R4X  [QFN64-T600]
IC3  RP115L331D-E2  [SON40P120X160X40-9T30X130N]
L1  BLM15EG221SH1D  [BEAD0402]
L2  BLM15EG221SH1D  [BEAD0402]
L3  BLM15EG221SH1D  [BEAD0402]
L4  BLM15EG221SH1D  [BEAD0402]
L5  BLM15EG221SH1D  [BEAD0402]
R1  RT0402FRE070RL  [R0402]
R2  12k1  RT0402FRE0712K1L  [R0402]
R3  RL1206FR-7WL  RT0402FRE0710KL  [R0402]
R4  4k7  RT0402FRE074K7L  [R0402]
R5  4k7  RT0402FRE074K7L  [R0402]
R6  10k  RT0402FRE0710KL  [R0402]
R7  RL1206FR-7WL  RT0402FRE0710KL  [R0402]
R8  49R9  RT0402FRE0749R9L  [R0402]
R9  49R9  RT0402FRE0749R9L  [R0402]
R10  49R9  RT0402FRE0749R9L  [R0402]
R11  49R9  RT0402FRE0749R9L  [R0402]
R12  49R9  RT0402FRE0749R9L  [R0402]
R13  49R9  RT0402FRE0749R9L  [R0402]
R14  49R9  RT0402FRE0749R9L  [R0402]
R15  49R9  RT0402FRE0749R9L  [R0402]
R16  RT0402FRE070RL  [R0402]
R17  RT0402FRE070RL  [R0402]
R18  100  RT0402FRE07100RL  [R0402]
R19  100  RT0402FRE07100RL  [R0402]
R20  100  RT0402FRE07100RL  [R0402]
R21  100  RT0402FRE07100RL  [R0402]
R22  100  RT0402FRE07100RL  [R0402]
R23  100  RT0402FRE07100RL  [R0402]
R24  10k  RT0402FRE0710KL  [R0402]
R25  10k  RT0402FRE0710KL  [R0402]
R26  RL1206FR-7WL  RT0402FRE0710KL  [R0402]
R27  RL1206FR-7WL  RT0402FRE0710KL  [R0402]
T1  749020100  [SOIC127P965X533-16-TRAFO]
T2  749020100  [SOIC127P965X533-16-TRAFO]
X1  87438-0443  [87438-04]
X2  87438-0443  [87438-04]
Y1  ECS-250-18-36B-CKY-TR  [ECX-2236]

### Nets
#MISO: IC2.13(B:D1/AD1/EOF/SO/SIO1) R22.1
#MOSI: IC2.17(B:D0/AD0/WD_STATE/SI/SIO0) R23.1
#SCK: IC2.19(B:D9/AD9/LATCH_IN/SCK) R18.1
#SCS#: IC2.50(B:D5/AD5/OUTVALID/SCS#) R19.1
#SQI2: IC2.12(B:D2/AD2/SOF/SIO2/EE_EMUL_SPI0) R21.1
#SQI3: IC2.35(B:D3/AD3/WD_TRIG/SIO3/EE_EMUL_SPI1) R20.1
+3V3 [Power]: C10.1 C11.1 C12.1 C13.1 C14.1 C15.1 C22.1 C33.1 D1.2(A) IC1.8(VCC) IC2.5(A:VDD33) IC2.7(A:REG_EN) IC2.14(A:VDDIO) IC2.20(A:VDDIO) IC2.32(A:VDDIO) IC2.37(A:VDDIO) IC2.47(A:VDDIO) IC3.1(VOUT) IC3.2(VOUT) IC3.4(VFB) L1.1 L2.1 L3.1 R4.2 R5.2 R6.2
CT1: C31.1 R16.1 T1.3(A:CT) T1.6(B:CT)
CT2: C32.1 R17.1 T2.3(A:CT) T2.6(B:CT)
ECAT_CS: R19.2
ECAT_MISO: R22.2
ECAT_MOSI: R23.2
ECAT_SCK: R18.2
ECAT_SQI2: R21.2
ECAT_SQI3: R20.2
GND [Power]: C1.2 C2.2 C3.2 C4.2 C5.2 C6.2 C7.2 C8.2 C9.2 C10.2 C11.2 C12.2 C13.2 C14.2 C15.2 C16.2 C17.2 C18.2 C19.2 C20.1 C21.1 C22.2 C31.2 C32.2 C33.2 C66.2 D2.1(C) D3.1(C) IC1.1(A0) IC1.2(A1) IC1.3(A2) IC1.4(GND) IC1.7(WP) IC1.9(GND) IC2.4(A:OSCVSS) IC2.8(A:CLK_25/CLK_25_EN/XTAL_MODE) IC2.9(A:ERRLED/PME/100FD_B/LEDPOL4) IC2.41(A:TESTMODE) IC2.65(A:GND) IC3.5(GND) IC3.9(GND) R2.1 R3.2 R24.1 R25.1 Y1.2(S) Y1.4(S)
GPIO0: IC2.48(A:LINKACTLED0/TDO/CHIP_MODE0/100FD_A/LEDPOL0) R24.2 R26.1
GPIO1: IC2.46(A:LINKACTLED1/TDI/CHIP_MODE1/LEDPOL1) R25.2 R27.1
GPIO2: IC2.45(A:RUNLED/STATE_RUNLED/E2PSIZE/EE_EMUL0/LEDPOL3) R6.1 R7.2
I2C_SCL: IC1.6(SCL) IC2.43(A:EESCL/TCK/EE_MUL2) R4.1
I2C_SDA: IC1.5(SDA) IC2.42(A:EESDA/TMS/EE_MUL1) R5.1
IN_RX_N [Ethernet]: T1.9(B:X-) X1.4
IN_RX_P [Ethernet]: T1.10(B:X+) X1.3
IN_TX_N [Ethernet]: T1.15(A:X-) X1.2
IN_TX_P [Ethernet]: T1.16(A:X+) X1.1
IRQ: IC2.44(A:IRQ/LATCH1)
N$1: D2.2(A) R26.2
N$2: D3.2(A) R27.2
N$3: IC3.3(LCON) IC3.6(CE) IC3.7(VDD) IC3.8(VDD) L5.2
N$15: D1.1(C) R7.1
OSCI: IC2.1(A:OSCI) R1.2
OSCI1: C20.2 R1.1 Y1.3
OSCO: C21.2 IC2.2(A:OSCO) Y1.1
OUT_RX_N [Ethernet]: T2.9(B:X-) X2.4
OUT_RX_P [Ethernet]: T2.10(B:X+) X2.3
OUT_TX_N [Ethernet]: T2.15(A:X-) X2.2
OUT_TX_P [Ethernet]: T2.16(A:X+) X2.1
RBIAS: IC2.57(A:RBIAS) R2.2
RST#: IC2.11(A:RST#)
RXA_N: IC2.54(A:RXNA) R10.1 T1.8(B:D-)
RXA_P: IC2.55(A:RXPA) R11.1 T1.7(B:D+)
RXB_N: IC2.61(A:RXNB) R14.1 T2.2(A:D-)
RXB_P: IC2.60(A:RXPB) R15.1 T2.1(A:D+)
SYNC0: IC2.34(B:SYNC0/LATCH0/PME)
SYNC1: IC2.18(B:SYNC1/LATCH1/PME)
TXA_N: IC2.52(A:TXNA) R8.1 T1.2(A:D-)
TXA_P: IC2.53(A:TXPA) R9.1 T1.1(A:D+)
TXB_N: IC2.63(A:TXNB) R12.1 T2.8(B:D-)
TXB_P: IC2.62(A:TXPB) R13.1 T2.7(B:D+)
V+: C66.1 L5.1
VDD [Power]: C16.1 C17.1 C18.1 C19.1 IC2.6(A:VDDCR) IC2.24(A:VDDCR) IC2.38(A:VDDCR) L4.1
VDD12TX [Power]: C6.1 C7.1 C8.1 C9.1 IC2.56(A:VDD12TX) IC2.59(A:VDD12TX) L4.2
VDD33BIAS [Power]: C5.1 IC2.58(A:VDD33BIAS) L3.2
VDD33TXRX1 [Power]: C1.1 C2.1 IC2.51(A:VDD33TXRX1) L1.2 R8.2 R9.2 R10.2 R11.2 R16.2
VDD33TXRX2 [Power]: C3.1 C4.1 IC2.64(A:VDD33TXRX2) L2.2 R12.2 R13.2 R14.2 R15.2 R17.2
WAIT_ACK: IC2.10(A:WAIT_ACK/PME/EE_EMULSPI3/LATCH0) R3.1
Unconnected: IC2.15(B:D14/AD14/DIGIO8/GPI8/GPO8/MII_TXD3/TX_SHIFT1) IC2.16(B:D13/AD13/DIGIO7/GPI7/GPO7/MII_TXD2/TX_SHIFT0) IC2.21(B:D12/AD12/DIGIO6/GPI6/GPO6/MII_TXD1/100FD_B) IC2.22(B:D11/AD11/DIGIO5/GPI5/GPO5/MII_TXD0/100FD_A) IC2.23(B:D10/AD10/DIGIO4/GPI4/GPO4/MII_TXEN) IC2.25(B:A1/ALELO/OE_EXT/MII_CLK25/EE_EMUL_SPI2) IC2.26(B:A3/DIGIO11/GPI11/GPO11/MII_RXDV) IC2.27(B:A4/DIGIO12/GPI12/GPO12/MII_RXD0) IC2.28(B:CS/DIGIO13/GPI13/GPO13/MII_RXD1) IC2.29(B:A2/ALEHI/DIGIO10/GPI10/GPO10/LINKACTLED2/MII_LINKPOL/LEDPOL2) IC2.30(B:WR/ENB/DIGIO14/GPI14/GPO14/MII_RXD2) IC2.31(B:RD/RD_WR/DIGIO15/GPI15/GPO15/MII_RXD3) IC2.33(B:A0/D15/AD15/DIGIO9/GPI9/GPO9/MII_RXER) IC2.36(B:D6/AD6/DIGIO0/GPI0/GPO0/MII_RXCLK) IC2.39(B:D7/AD7/DIGIO1/GPI1/GPO1/MII_MDC) IC2.40(B:D8/AD8/DIGIO2/GPI2/GPO2/MII_MDIO) IC2.49(B:D4/AD4/DIGIO3/GPI3/GPO3/MII_LINK) T1.11(B:XCT) T1.14(A:XCT) T2.11(B:XCT) T2.14(A:XCT)

### Power pins joined to a net without a drawn wire
OSCVDD12: IC2.3(A:OSCVDD12)

### Library data of the parts
C1 C3 C6 C8 C16 C66 = msrm:GCM?C7*: Multilayer Ceramic Capacitors Chip Multilayer Ceramic Capacitors for Automotive Sources: Catalogue <https://www.murata.com/~/media/webrenewal/support/library/catalog/products/capacitor/mlcc/c03e.ashx?la=en-us> Part Numbering <https://search.murata.co.jp/Ceramy/image/img/A01X/partnumbering_e_02.pdf> package: C0402 : 490-13409-1 ___ Source: Digikey <https://www.digikey.de/products/en?keywords=490-13409-1-ND> ; Datasheet <https://www.murata.com/-/media/webrenewal/support/library/catalog/products/capacitor/ceramiccapacitor/c03e.ashx?la=en-us&cvid=20200707014404000000> 490-14427-1 ___ Source: Digikey <https://www.digikey.de/products/en?keywords=490-14427-1-ND> ; Datasheet <https://search.murata.co.jp/Ceramy/image/img/A01X/G101/ENG/GCM155C71A474KE36-01.pdf>; CAPACITANCE: 1uF; DIGIKEY: 490-13409-1-ND; TOLERANCE: ±10%; VOLTAGE: 10V
C2 C4 C5 C7 C9-C15 C18 C19 C22 = msrm:GCM?R7*: Multilayer Ceramic Capacitors Chip Multilayer Ceramic Capacitors for Automotive –55 to 125°C Sources: Catalogue <https://www.murata.com/~/media/webrenewal/support/library/catalog/products/capacitor/mlcc/c03e.ashx?la=en-us> Part Numbering <https://search.murata.co.jp/Ceramy/image/img/A01X/partnumbering_e_02.pdf> package: C0201 : 470pF ___ Source: Digikey <https://www.digikey.de/products/en?keywords=490-17744-1-ND> ; Datasheet <https://search.murata.co.jp/Ceramy/image/img/A01X/G101/ENG/GCM033R71E471KA03-01.pdf> package: C0402 : 100nF ___ Source: Digikey <https://www.digikey.de/products/en?keywords=490-16433-1-ND> ; Datasheet <https://search.murata.co.jp/Ceramy/image/img/A01X/G101/ENG/GCM155R71C104JA55-01.pdf> 220nF ___ Source: Digikey <https://www.digikey.de/products/en?keywords=490-10671-1-ND> ; Datasheet <https://www.murata.com/-/media/webrenewal/support/library/catalog/products/capacitor/ceramiccapacitor/c03e.ashx?la=en-us&cvid=20200707014404000000> 6.8nF ___ Source: Digikey <https://www.digikey.de/products/en?keywords=490-12655-1-ND> ; Datasheet <https://search.murata.co.jp/Ceramy/image/img/A01X/G101/ENG/GCM155R71C683KA55-01.pdf> 10nF ___ Source: Digikey <https://www.digikey.de/products/en?keywords=490-6043-1-ND> ; Datasheet <https://search.murata.co.jp/Ceramy/image/img/A01X/G101/ENG/GCM155R71E103KA37-01.pdf> 22nF ___ Source: Digikey <https://www.digikey.de/products/en?keywords=490-6044-1-ND> ; Datasheet <https://search.murata.co.jp/Ceramy/image/img/A01X/G101/ENG/GCM155R71E223KA55-01.pdf> 470pF ___ Source: Digikey <https://www.digikey.de/products/en?keywords=490-4913-1-ND> ; Datasheet <https://search.murata.co.jp/Ceramy/image/img/A01X/G101/ENG/GCM155R71H471KA37-01.pdf> package: C0603 : 1µF ___ Source: Digikey <https://www.digikey.de/products/en?keywords=490-5241-1-ND> ; Datasheet <https://www.murata.com/-/media/webrenewal/support/library/catalog/products/capacitor/ceramiccapacitor/c03e.ashx?la=en-us&cvid=20200707014404000000> 470nF ___ Source: Digikey <https://www.digikey.de/products/en?keywords=490-12589-1-ND> ; Datasheet <https://search.murata.co.jp/Ceramy/image/img/A01X/G101/ENG/GCM188R71C474KA55-01.pdf> 10nF ___ Source: Digikey <https://www.digikey.de/products/en?keywords=490-4781-1-ND> ; Datasheet <https://search.murata.co.jp/Ceramy/image/img/A01X/G101/ENG/GCM188R72A103KA37-01.pdf> 22nF ___ Source: Digikey <https://www.digikey.de/products/en?keywords=490-4782-1-ND> ; Datasheet <https://www.murata.com/-/media/webrenewal/support/library/catalog/products/capacitor/ceramiccapacitor/c03e.ashx?la=en-us&cvid=20200707014404000000> package: C0805 : 10µF ___ Source: Digikey <https://www.digikey.de/products/en?keywords=490-14361-1-ND> ; Datasheet <https://search.murata.co.jp/Ceramy/image/img/A01X/G101/ENG/GCM21BR70J106KE22-01.pdf> 2.2µF ___ Source: Digikey <https://www.digikey.de/products/en?keywords=490-4786-1-ND> ; Datasheet <https://search.murata.co.jp/Ceramy/image/img/A01X/G101/ENG/GCM21BR71C225KA64-01.pdf> 470nF ___ Source: Digikey <https://www.digikey.de/products/en?keywords=490-4788-1-ND> ; Datasheet <https://search.murata.co.jp/Ceramy/image/img/A01X/G101/ENG/GCM21BR71H474KA55-01.pdf> 100nF ___ Source: Digikey <https://www.digikey.de/products/en?keywords=490-8051-1-ND> ; Datasheet <https://search.murata.co.jp/Ceramy/image/img/A01X/G101/ENG/GCM21BR72A104KA37-01.pdf> package: C0805K : 220nF ___ Source: Digikey <https://www.digikey.de/products/en?keywords=490-8306-1-ND> ; Datasheet <https://search.murata.co.jp/Ceramy/image/img/A01X/G101/ENG/GRM21AR72A224KAC5-01.pdf> package: C1206 : 10µF ___ Source: Digikey <https://www.digikey.de/products/en?keywords=490-14746-1-ND> ; Datasheet <https://search.murata.co.jp/Ceramy/image/img/A01X/G101/ENG/GCM31CR71C106KA64-01.pdf> 2.2µF ___ Source: Digikey <https://www.digikey.de/products/en?keywords=490-11169-1-ND> ; Datasheet <https://search.murata.co.jp/Ceramy/image/img/A01X/G101/ENG/GCM31CR71H225KA55-01.pdf> package: C1206 : 2220nF ___ Source: Digikey <https://www.digikey.de/products/en?keywords=490-4975-1-ND> ; Datasheet <https://search.murata.co.jp/Ceramy/image/img/A01X/G101/ENG/GCM31MR72A224KA37-01.pdf>; CAPACITANCE: 100nF; DIGIKEY: 490-16433-1-ND; TOLERANCE: ±5%; VOLTAGE: 16V
C17 = msrm:GCM?R7*: Multilayer Ceramic Capacitors Chip Multilayer Ceramic Capacitors for Automotive –55 to 125°C Sources: Catalogue <https://www.murata.com/~/media/webrenewal/support/library/catalog/products/capacitor/mlcc/c03e.ashx?la=en-us> Part Numbering <https://search.murata.co.jp/Ceramy/image/img/A01X/partnumbering_e_02.pdf> package: C0201 : 470pF ___ Source: Digikey <https://www.digikey.de/products/en?keywords=490-17744-1-ND> ; Datasheet <https://search.murata.co.jp/Ceramy/image/img/A01X/G101/ENG/GCM033R71E471KA03-01.pdf> package: C0402 : 100nF ___ Source: Digikey <https://www.digikey.de/products/en?keywords=490-16433-1-ND> ; Datasheet <https://search.murata.co.jp/Ceramy/image/img/A01X/G101/ENG/GCM155R71C104JA55-01.pdf> 220nF ___ Source: Digikey <https://www.digikey.de/products/en?keywords=490-10671-1-ND> ; Datasheet <https://www.murata.com/-/media/webrenewal/support/library/catalog/products/capacitor/ceramiccapacitor/c03e.ashx?la=en-us&cvid=20200707014404000000> 6.8nF ___ Source: Digikey <https://www.digikey.de/products/en?keywords=490-12655-1-ND> ; Datasheet <https://search.murata.co.jp/Ceramy/image/img/A01X/G101/ENG/GCM155R71C683KA55-01.pdf> 10nF ___ Source: Digikey <https://www.digikey.de/products/en?keywords=490-6043-1-ND> ; Datasheet <https://search.murata.co.jp/Ceramy/image/img/A01X/G101/ENG/GCM155R71E103KA37-01.pdf> 22nF ___ Source: Digikey <https://www.digikey.de/products/en?keywords=490-6044-1-ND> ; Datasheet <https://search.murata.co.jp/Ceramy/image/img/A01X/G101/ENG/GCM155R71E223KA55-01.pdf> 470pF ___ Source: Digikey <https://www.digikey.de/products/en?keywords=490-4913-1-ND> ; Datasheet <https://search.murata.co.jp/Ceramy/image/img/A01X/G101/ENG/GCM155R71H471KA37-01.pdf> package: C0603 : 1µF ___ Source: Digikey <https://www.digikey.de/products/en?keywords=490-5241-1-ND> ; Datasheet <https://www.murata.com/-/media/webrenewal/support/library/catalog/products/capacitor/ceramiccapacitor/c03e.ashx?la=en-us&cvid=20200707014404000000> 470nF ___ Source: Digikey <https://www.digikey.de/products/en?keywords=490-12589-1-ND> ; Datasheet <https://search.murata.co.jp/Ceramy/image/img/A01X/G101/ENG/GCM188R71C474KA55-01.pdf> 10nF ___ Source: Digikey <https://www.digikey.de/products/en?keywords=490-4781-1-ND> ; Datasheet <https://search.murata.co.jp/Ceramy/image/img/A01X/G101/ENG/GCM188R72A103KA37-01.pdf> 22nF ___ Source: Digikey <https://www.digikey.de/products/en?keywords=490-4782-1-ND> ; Datasheet <https://www.murata.com/-/media/webrenewal/support/library/catalog/products/capacitor/ceramiccapacitor/c03e.ashx?la=en-us&cvid=20200707014404000000> package: C0805 : 10µF ___ Source: Digikey <https://www.digikey.de/products/en?keywords=490-14361-1-ND> ; Datasheet <https://search.murata.co.jp/Ceramy/image/img/A01X/G101/ENG/GCM21BR70J106KE22-01.pdf> 2.2µF ___ Source: Digikey <https://www.digikey.de/products/en?keywords=490-4786-1-ND> ; Datasheet <https://search.murata.co.jp/Ceramy/image/img/A01X/G101/ENG/GCM21BR71C225KA64-01.pdf> 470nF ___ Source: Digikey <https://www.digikey.de/products/en?keywords=490-4788-1-ND> ; Datasheet <https://search.murata.co.jp/Ceramy/image/img/A01X/G101/ENG/GCM21BR71H474KA55-01.pdf> 100nF ___ Source: Digikey <https://www.digikey.de/products/en?keywords=490-8051-1-ND> ; Datasheet <https://search.murata.co.jp/Ceramy/image/img/A01X/G101/ENG/GCM21BR72A104KA37-01.pdf> package: C0805K : 220nF ___ Source: Digikey <https://www.digikey.de/products/en?keywords=490-8306-1-ND> ; Datasheet <https://search.murata.co.jp/Ceramy/image/img/A01X/G101/ENG/GRM21AR72A224KAC5-01.pdf> package: C1206 : 10µF ___ Source: Digikey <https://www.digikey.de/products/en?keywords=490-14746-1-ND> ; Datasheet <https://search.murata.co.jp/Ceramy/image/img/A01X/G101/ENG/GCM31CR71C106KA64-01.pdf> 2.2µF ___ Source: Digikey <https://www.digikey.de/products/en?keywords=490-11169-1-ND> ; Datasheet <https://search.murata.co.jp/Ceramy/image/img/A01X/G101/ENG/GCM31CR71H225KA55-01.pdf> package: C1206 : 2220nF ___ Source: Digikey <https://www.digikey.de/products/en?keywords=490-4975-1-ND> ; Datasheet <https://search.murata.co.jp/Ceramy/image/img/A01X/G101/ENG/GCM31MR72A224KA37-01.pdf>; CAPACITANCE: 470pF; DIGIKEY: 490-4913-1-ND; TOLERANCE: ±10%; VOLTAGE: 50V
C20 C21 = msrm:GCM?5C*: Multilayer Ceramic Capacitors Chip Multilayer Ceramic Capacitors for Automotive -55°C to 125°C Part Numbering <https://search.murata.co.jp/Ceramy/image/img/A01X/partnumbering_e_02.pdf> package: C0402 : 8.2pF ___ Source: Digikey <https://www.digikey.de/products/en?keywords=490-14426-6-ND> ; Datasheet <https://search.murata.co.jp/Ceramy/image/img/A01X/G101/ENG/GCM1555C1H8R2BA16-01.pdf> 10pF ___ Source: Digikey <https://www.digikey.de/products/en?keywords=490-10668-1-ND> ; Datasheet <https://www.murata.com/-/media/webrenewal/support/library/catalog/products/capacitor/ceramiccapacitor/c03e.ashx?la=en-us&cvid=20200707014404000000> 100pF___ Source: Digikey <https://www.digikey.de/products/en?keywords=490-10669-1-ND> ; Datasheet <https://www.murata.com/-/media/webrenewal/support/library/catalog/products/capacitor/ceramiccapacitor/c03e.ashx?la=en-us&cvid=20200707014404000000> 1000pF ___ Source: Digikey <https://www.digikey.de/products/en?keywords=490-16461-1-ND> ; Datasheet <https://search.murata.co.jp/Ceramy/image/img/A01X/G101/ENG/GCM1555C1H102FA16-01.pdf> 15pF_1% ___ Source: Digikey <https://www.digikey.de/products/en?keywords=490-14350-1-ND> ; Datasheet <https://search.murata.co.jp/Ceramy/image/img/A01X/G101/ENG/GCM1555C1H150FA16-01.pdf> 15pF_5% ___ Source: Digikey <https://www.digikey.de/products/en?keywords=490-11147-1-ND> ; Datasheet <https://www.murata.com/-/media/webrenewal/support/library/catalog/products/capacitor/ceramiccapacitor/c03e.ashx?la=en-us&cvid=20200707014404000000> 18pF ___ Source: Digikey <https://www.digikey.de/products/en?keywords=490-12650-1-ND> ; Datasheet <https://www.murata.com/-/media/webrenewal/support/library/catalog/products/capacitor/ceramiccapacitor/c03e.ashx?la=en-us&cvid=20200707014404000000> 22pF ___ Source: Digikey <https://www.digikey.de/products/en?keywords=490-9648-1-ND> ; Datasheet <https://search.murata.co.jp/Ceramy/image/img/A01X/G101/ENG/GCM1555C1H220JA16-01.pdf> 51pF ___ Source: Digikey <https://www.digikey.de/products/en?keywords=490-5944-1-ND> ; Datasheet <https://search.murata.co.jp/Ceramy/image/img/A01X/G101/ENG/GRM1555C1H510JA01-01.pdf> 680pF ___ Source: Digikey <https://www.digikey.de/products/en?keywords=490-16439-1-ND> ; Datasheet <https://search.murata.co.jp/Ceramy/image/img/A01X/G101/ENG/GCM1555C1H681FA16-01.pdf>; CAPACITANCE: 18pF; DIGIKEY: 490-12650-1-ND; TOLERANCE: ±5%; VOLTAGE: 50V
C31 C32 = msrm:GCM?R7*: Multilayer Ceramic Capacitors Chip Multilayer Ceramic Capacitors for Automotive –55 to 125°C Sources: Catalogue <https://www.murata.com/~/media/webrenewal/support/library/catalog/products/capacitor/mlcc/c03e.ashx?la=en-us> Part Numbering <https://search.murata.co.jp/Ceramy/image/img/A01X/partnumbering_e_02.pdf> package: C0201 : 470pF ___ Source: Digikey <https://www.digikey.de/products/en?keywords=490-17744-1-ND> ; Datasheet <https://search.murata.co.jp/Ceramy/image/img/A01X/G101/ENG/GCM033R71E471KA03-01.pdf> package: C0402 : 100nF ___ Source: Digikey <https://www.digikey.de/products/en?keywords=490-16433-1-ND> ; Datasheet <https://search.murata.co.jp/Ceramy/image/img/A01X/G101/ENG/GCM155R71C104JA55-01.pdf> 220nF ___ Source: Digikey <https://www.digikey.de/products/en?keywords=490-10671-1-ND> ; Datasheet <https://www.murata.com/-/media/webrenewal/support/library/catalog/products/capacitor/ceramiccapacitor/c03e.ashx?la=en-us&cvid=20200707014404000000> 6.8nF ___ Source: Digikey <https://www.digikey.de/products/en?keywords=490-12655-1-ND> ; Datasheet <https://search.murata.co.jp/Ceramy/image/img/A01X/G101/ENG/GCM155R71C683KA55-01.pdf> 10nF ___ Source: Digikey <https://www.digikey.de/products/en?keywords=490-6043-1-ND> ; Datasheet <https://search.murata.co.jp/Ceramy/image/img/A01X/G101/ENG/GCM155R71E103KA37-01.pdf> 22nF ___ Source: Digikey <https://www.digikey.de/products/en?keywords=490-6044-1-ND> ; Datasheet <https://search.murata.co.jp/Ceramy/image/img/A01X/G101/ENG/GCM155R71E223KA55-01.pdf> 470pF ___ Source: Digikey <https://www.digikey.de/products/en?keywords=490-4913-1-ND> ; Datasheet <https://search.murata.co.jp/Ceramy/image/img/A01X/G101/ENG/GCM155R71H471KA37-01.pdf> package: C0603 : 1µF ___ Source: Digikey <https://www.digikey.de/products/en?keywords=490-5241-1-ND> ; Datasheet <https://www.murata.com/-/media/webrenewal/support/library/catalog/products/capacitor/ceramiccapacitor/c03e.ashx?la=en-us&cvid=20200707014404000000> 470nF ___ Source: Digikey <https://www.digikey.de/products/en?keywords=490-12589-1-ND> ; Datasheet <https://search.murata.co.jp/Ceramy/image/img/A01X/G101/ENG/GCM188R71C474KA55-01.pdf> 10nF ___ Source: Digikey <https://www.digikey.de/products/en?keywords=490-4781-1-ND> ; Datasheet <https://search.murata.co.jp/Ceramy/image/img/A01X/G101/ENG/GCM188R72A103KA37-01.pdf> 22nF ___ Source: Digikey <https://www.digikey.de/products/en?keywords=490-4782-1-ND> ; Datasheet <https://www.murata.com/-/media/webrenewal/support/library/catalog/products/capacitor/ceramiccapacitor/c03e.ashx?la=en-us&cvid=20200707014404000000> package: C0805 : 10µF ___ Source: Digikey <https://www.digikey.de/products/en?keywords=490-14361-1-ND> ; Datasheet <https://search.murata.co.jp/Ceramy/image/img/A01X/G101/ENG/GCM21BR70J106KE22-01.pdf> 2.2µF ___ Source: Digikey <https://www.digikey.de/products/en?keywords=490-4786-1-ND> ; Datasheet <https://search.murata.co.jp/Ceramy/image/img/A01X/G101/ENG/GCM21BR71C225KA64-01.pdf> 470nF ___ Source: Digikey <https://www.digikey.de/products/en?keywords=490-4788-1-ND> ; Datasheet <https://search.murata.co.jp/Ceramy/image/img/A01X/G101/ENG/GCM21BR71H474KA55-01.pdf> 100nF ___ Source: Digikey <https://www.digikey.de/products/en?keywords=490-8051-1-ND> ; Datasheet <https://search.murata.co.jp/Ceramy/image/img/A01X/G101/ENG/GCM21BR72A104KA37-01.pdf> package: C0805K : 220nF ___ Source: Digikey <https://www.digikey.de/products/en?keywords=490-8306-1-ND> ; Datasheet <https://search.murata.co.jp/Ceramy/image/img/A01X/G101/ENG/GRM21AR72A224KAC5-01.pdf> package: C1206 : 10µF ___ Source: Digikey <https://www.digikey.de/products/en?keywords=490-14746-1-ND> ; Datasheet <https://search.murata.co.jp/Ceramy/image/img/A01X/G101/ENG/GCM31CR71C106KA64-01.pdf> 2.2µF ___ Source: Digikey <https://www.digikey.de/products/en?keywords=490-11169-1-ND> ; Datasheet <https://search.murata.co.jp/Ceramy/image/img/A01X/G101/ENG/GCM31CR71H225KA55-01.pdf> package: C1206 : 2220nF ___ Source: Digikey <https://www.digikey.de/products/en?keywords=490-4975-1-ND> ; Datasheet <https://search.murata.co.jp/Ceramy/image/img/A01X/G101/ENG/GCM31MR72A224KA37-01.pdf>; CAPACITANCE: 22nF; DIGIKEY: 490-6044-1-ND; TOLERANCE: ±10%; VOLTAGE: 25V
C33 = msrm:GRM?C8*: CAP CER 10UF 6.3V X6S 0402 package: C0402 : 10µF ___ Source: Digikey <https://www.digikey.de/products/en?keywords=490-13233-1-ND> ; Datasheet <https://search.murata.co.jp/Ceramy/image/img/A01X/G101/ENG/GRM155C80J106ME11-01.pdf> 2.2µF ___ Source: Digikey <https://www.digikey.de/products/en?keywords=490-10012-1-ND> ; Datasheet <https://search.murata.co.jp/Ceramy/image/img/A01X/G101/ENG/GRM155C80J225KE95-01.pdf> 4.7µF ___ Source: Digikey <https://www.digikey.de/products/en?keywords=490-14458-1-ND> ; Datasheet <https://search.murata.co.jp/Ceramy/image/img/A01X/G101/ENG/GRM155C80J475MEAA-01.pdf>; CAPACITANCE: 10uF; DIGIKEY: 490-13233-1-ND; TOLERANCE: ±20%; VOLTAGE: 6.3V
D1 = msrm:QBLP595-: LED 0402 SMD, 2V package: 0402 : Yellow-Green ___ Source: Digikey <https://www.digikey.de/product-detail/en/qt-brightek-qtb/QBLP595-AG/1516-1218-1-ND/6201915> ; Datasheet <http://www.qt-brightek.com/datasheet/QBLP595%20Series.pdf> Blue ___ Source: Digikey <https://www.digikey.de/product-detail/en/qt-brightek-qtb/QBLP595-IB/1516-1215-1-ND/6201912> ; Datasheet <http://www.qt-brightek.com/datasheet/QBLP595%20Series.pdf> Green ___ Source: Digikey <https://www.digikey.de/product-detail/en/qt-brightek-qtb/QBLP595-IG/1516-1216-1-ND/6201913> ; Datasheet <http://www.qt-brightek.com/datasheet/QBLP595%20Series.pdf> Orange ___ Source: Digikey <https://www.digikey.de/product-detail/en/qt-brightek-qtb/QBLP595-O/1516-1220-1-ND/6201917> ; Datasheet <http://www.qt-brightek.com/datasheet/QBLP595%20Series.pdf> Red ___ Source: Digikey <https://www.digikey.de/product-detail/en/qt-brightek-qtb/QBLP595-R/1516-1217-1-ND/6201914> ; Datasheet <http://www.qt-brightek.com/datasheet/QBLP595%20Series.pdf> Yellow ___ Source: Digikey <https://www.digikey.de/product-detail/en/qt-brightek-qtb/QBLP595-Y/1516-1219-1-ND/6201916> ; Datasheet <http://www.qt-brightek.com/datasheet/QBLP595%20Series.pdf>; COLOR: Green; DIGIKEY: 1516-1216-1-ND
D2 = msrm:QBLP595-: LED 0402 SMD, 2V package: 0402 : Yellow-Green ___ Source: Digikey <https://www.digikey.de/product-detail/en/qt-brightek-qtb/QBLP595-AG/1516-1218-1-ND/6201915> ; Datasheet <http://www.qt-brightek.com/datasheet/QBLP595%20Series.pdf> Blue ___ Source: Digikey <https://www.digikey.de/product-detail/en/qt-brightek-qtb/QBLP595-IB/1516-1215-1-ND/6201912> ; Datasheet <http://www.qt-brightek.com/datasheet/QBLP595%20Series.pdf> Green ___ Source: Digikey <https://www.digikey.de/product-detail/en/qt-brightek-qtb/QBLP595-IG/1516-1216-1-ND/6201913> ; Datasheet <http://www.qt-brightek.com/datasheet/QBLP595%20Series.pdf> Orange ___ Source: Digikey <https://www.digikey.de/product-detail/en/qt-brightek-qtb/QBLP595-O/1516-1220-1-ND/6201917> ; Datasheet <http://www.qt-brightek.com/datasheet/QBLP595%20Series.pdf> Red ___ Source: Digikey <https://www.digikey.de/product-detail/en/qt-brightek-qtb/QBLP595-R/1516-1217-1-ND/6201914> ; Datasheet <http://www.qt-brightek.com/datasheet/QBLP595%20Series.pdf> Yellow ___ Source: Digikey <https://www.digikey.de/product-detail/en/qt-brightek-qtb/QBLP595-Y/1516-1219-1-ND/6201916> ; Datasheet <http://www.qt-brightek.com/datasheet/QBLP595%20Series.pdf>; COLOR: Blue; DIGIKEY: 1516-1215-1-ND
D3 = msrm:QBLP595-: LED 0402 SMD, 2V package: 0402 : Yellow-Green ___ Source: Digikey <https://www.digikey.de/product-detail/en/qt-brightek-qtb/QBLP595-AG/1516-1218-1-ND/6201915> ; Datasheet <http://www.qt-brightek.com/datasheet/QBLP595%20Series.pdf> Blue ___ Source: Digikey <https://www.digikey.de/product-detail/en/qt-brightek-qtb/QBLP595-IB/1516-1215-1-ND/6201912> ; Datasheet <http://www.qt-brightek.com/datasheet/QBLP595%20Series.pdf> Green ___ Source: Digikey <https://www.digikey.de/product-detail/en/qt-brightek-qtb/QBLP595-IG/1516-1216-1-ND/6201913> ; Datasheet <http://www.qt-brightek.com/datasheet/QBLP595%20Series.pdf> Orange ___ Source: Digikey <https://www.digikey.de/product-detail/en/qt-brightek-qtb/QBLP595-O/1516-1220-1-ND/6201917> ; Datasheet <http://www.qt-brightek.com/datasheet/QBLP595%20Series.pdf> Red ___ Source: Digikey <https://www.digikey.de/product-detail/en/qt-brightek-qtb/QBLP595-R/1516-1217-1-ND/6201914> ; Datasheet <http://www.qt-brightek.com/datasheet/QBLP595%20Series.pdf> Yellow ___ Source: Digikey <https://www.digikey.de/product-detail/en/qt-brightek-qtb/QBLP595-Y/1516-1219-1-ND/6201916> ; Datasheet <http://www.qt-brightek.com/datasheet/QBLP595%20Series.pdf>; COLOR: Orange; DIGIKEY: 1516-1220-1-ND
IC1 = msrm:CAT24C512: EEPROM Memory IC 512Kb (64K x 8) I²C 1MHz 400ns Source: Datasheet <http://www.onsemi.com/pub/Collateral/CAT24C512-D.PDF>; DIGIKEY: CAT24C512HU5IGT3OSCT-ND; LEAD_FINISH: NiPdAu; TEMPERATURE: -40°C ~ 85°C
IC2 = msrm:LAN9253: 2/3-Port EtherCAT® Slave Controller with Integrated Ethernet PHYs package: QFN64-T600 / ML : LAN9252 ___ Source: Digikey <https://www.digikey.de/products/en?keywords=LAN9252/ML-ND> ; Datasheet <http://www.microchip.com/mymicrochip/filehandler.aspx?ddocname=en573610> LAN9252I ___ Source: Digikey <https://www.digikey.de/products/en?keywords=LAN9252I/ML-ND> ; Datasheet <http://www.microchip.com/mymicrochip/filehandler.aspx?ddocname=en573610> LAN9252T___ Source: Digikey <https://www.digikey.de/products/en?keywords=LAN9252T/ML-ND> ; Datasheet <http://www.microchip.com/mymicrochip/filehandler.aspx?ddocname=en573610> LAN9252TI ___ Source: Digikey <https://www.digikey.de/products/en?keywords=LAN9252TI/ML-ND> ; Datasheet <http://www.microchip.com/mymicrochip/filehandler.aspx?ddocname=en573610> LAN9252TV ___ Source: Digikey <https://www.digikey.de/products/en?keywords=LAN9252TV/ML-ND> ; Datasheet <http://www.microchip.com/mymicrochip/filehandler.aspx?ddocname=en573610> LAN9252V ___ Source: Digikey <https://www.digikey.de/products/en?keywords=LAN9252V/ML-ND> ; Datasheet <http://www.microchip.com/mymicrochip/filehandler.aspx?ddocname=en573610> package: TQFP64-T570 / PT : LAN9252 ___ Source: Digikey <https://www.digikey.de/products/en?keywords=LAN9252/PT-ND> ; Datasheet <http://www.microchip.com/mymicrochip/filehandler.aspx?ddocname=en573610> LAN9252I ___ Source: Digikey <https://www.digikey.de/products/en?keywords=LAN9252I/PT-ND> ; Datasheet <http://www.microchip.com/mymicrochip/filehandler.aspx?ddocname=en573610> LAN9252T ___ Source: Digikey <https://www.digikey.de/products/en?keywords=LAN9252T/PT-ND> ; Datasheet <http://www.microchip.com/mymicrochip/filehandler.aspx?ddocname=en573610> LAN9252TI ___ Source: Digikey <https://www.digikey.de/products/en?keywords=LAN9252TI/PT-ND> ; Datasheet <http://www.microchip.com/mymicrochip/filehandler.aspx?ddocname=en573610>; DIGIKEY: 150-LAN9253-I/R4X-ND; TAPE_AND_REEL: Tray; TEMP: -40°C to 85°C
IC3 = msrm:RP115?*: Linear Voltage Regulator IC 1 Output 1A DFN1216-8 package: 8-XFDFN Exposed Pad : L331D-E2 ___ Source: Digikey <https://www.digikey.de/products/en?keywords=2129-RP115L331D-E2CT-ND> ; Datasheet <https://www.n-redc.co.jp/en/pdf/datasheet/rp115-ea.pdf>; CURRENT: 1A; DIGIKEY: 2129-RP115L331D-E2CT-ND; INPUT: 5.25V; OUTPUT: 3.3V
L1-L5 = msrm:BLM?EG*1D: Murata's SMD Ferrite Bead BLM18EG Series Productdata: Part Numbering <https://www.murata.com/en-us/products/productdata/8796733767710/S0580E.pdf> package: 0402 : 220 Ohms @ 100MHz ___ Source: Digikey <https://www.digikey.de/products/en?keywords=490-17345-1-ND> ; Datasheet <https://www.murata.com/en-us/products/productdata/8799741607966/QNFA9136.pdf> package: 0603 : 100 Ohms @ 100MHz ___ Source: Digikey <https://www.digikey.de/products/en?keywords=490-5978-1-ND> ; Datasheet <https://www.murata.com/en-us/products/productdata/8796747366430/ENFA0021.pdf> 120 Ohms @ 100MHz___ Source: Digikey <https://www.digikey.de/products/en?keywords=490-3991-1-ND> ; Datasheet <https://www.murata.com/en-us/products/productdata/8796747366430/ENFA0021.pdf> 220 Ohms @ 100MHz ___ Source: Digikey <https://www.digikey.de/products/en?keywords=490-3992-6-ND> ; Datasheet <https://www.murata.com/en-us/products/productdata/8796747366430/ENFA0021.pdf> 220 Ohms @ 100MHz ___ Source: Digikey <https://www.digikey.de/products/en?keywords=490-5979-1-ND> ; Datasheet <https://www.murata.com/en-us/products/productdata/8796747366430/ENFA0021.pdf> 330 Ohms @ 100MHz ___ Source: Digikey <https://www.digikey.de/products/en?keywords=490-5913-1-ND> ; Datasheet <https://www.murata.com/en-us/products/productdata/8796747366430/ENFA0021.pdf> 390 Ohms @ 100MHz ___ Source: Digikey <https://www.digikey.de/products/en?keywords=490-5980-2-ND> ; Datasheet <https://www.murata.com/en-us/products/productdata/8796747366430/ENFA0021.pdf> 470 Ohms @ 100MHz ___ Source: Digikey <https://www.digikey.de/products/en?keywords=490-3993-1-ND> ; Datasheet <https://www.murata.com/en-us/products/productdata/8796747366430/ENFA0021.pdf> 600 Ohms @ 100MHz ___ Source: Digikey <https://www.digikey.de/products/en?keywords=490-3994-1-ND> ; Datasheet <https://www.murata.com/en-us/products/productdata/8796747366430/ENFA0021.pdf>; DC_RES: 280mOhm; DIGIKEY: 490-17345-1-ND; IMPEDANCE-FREQUENCY: 220 Ohms @ 100MHz
R1 R16 R17 = msrm:RT?FRE07*L: SMD RESISTOR ± 1% Tol, Paper/PE taping reel, 50 ppm/°C, 7 inch dia. Reel Datasheet <http://www.yageo.com/documents/recent/PYu-RT_1-to-0.01_RoHS_L_11.pdf> package: 0201 : 0R ___ Source: Digikey <https://www.digikey.de/products/en?keywords=311-0.0MCT-ND> 1k ___ Source: Digikey <https://www.digikey.de/products/en?keywords=RT0201FRE071KL-ND> 10k ___ Source: Digikey <https://www.digikey.de/products/en?keywords=RT0201FRE0710KL-ND> 100 ___ Source: Digikey <https://www.digikey.de/products/en?keywords=RT0201FRE07100RL-ND> 330 ___ Source: Digikey <https://www.digikey.de/products/en?keywords=RT0201FRE07330RL-ND> package: 0402 : 0R ___ Source: Digikey <https://www.digikey.de/products/en?keywords=311-0.0LRCT-ND> 1k ___ Source: Digikey <https://www.digikey.de/products/en?keywords=%20YAG1234CT-ND> 2k2 ___ Source: Digikey <https://www.digikey.de/products/en?keywords=RT0402FRE072K2L-ND> 2k ___ Source: Digikey <https://www.digikey.de/products/en?keywords=YAG3345CT-ND> 4k7 ___ Source: Digikey <https://www.digikey.de/products/en?keywords=YAG3347CT-ND%20> 10k ___ Source: Digikey <https://www.digikey.de/products/en?keywords=YAG1233CT-ND> 12k1 ___ Source: Digikey <https://www.digikey.de/products/en?keywords=RT0402FRE0712K1L-ND> 49R9 ___ Source: Digikey <https://www.digikey.de/products/en?keywords=YAG3346CT-ND> 56k ___ Source: Digikey <https://www.digikey.de/products/en?keywords=RT0402FRE0756K2L-ND> 100k ___ Source: Digikey <https://www.digikey.de/products/en?keywords=YAG2307CT-ND> 100 ___ Source: Digikey <https://www.digikey.de/products/en?keywords=YAG3342CT-ND> 150 ___ Source: Digikey <https://www.digikey.de/product-detail/en/yageo/RT0402FRE07150RL/13-RT0402FRE07150RLCT-ND/12705162> 300 ___ Source: Digikey <https://www.digikey.de/products/en?keywords=RT0402FRE07300RL-ND> package: 0603 : 0R ___ Source: Digikey <https://www.digikey.de/products/en?keywords=311-0.0HRCT-ND> 1k ___ Source: Digikey <https://www.digikey.de/products/en?keywords=YAG2323CT-ND> 10k ___ Source: Digikey <https://www.digikey.de/products/en?keywords=YAG2321CT-ND> 100k ___ Source: Digikey <https://www.digikey.de/products/en?keywords=YAG2319CT-ND> 100 ___ Source: Digikey <https://www.digikey.de/products/en?keywords=YAG2320CT-ND> 300 ___ Source: Digikey <https://www.digikey.de/products/en?keywords=RT0603FRE07300RL-ND> 330 ___ Source: Digikey <https://www.digikey.de/products/en?keywords=YAG5957CT-ND>; DIGIKEY: 311-0.0LRCT-ND; NOTES: Actual Part Number: RC0402FR-070RL; RVALUE: 0R; SPICEPREFIX: R
R2 = msrm:RT?FRE07*L: SMD RESISTOR ± 1% Tol, Paper/PE taping reel, 50 ppm/°C, 7 inch dia. Reel Datasheet <http://www.yageo.com/documents/recent/PYu-RT_1-to-0.01_RoHS_L_11.pdf> package: 0201 : 0R ___ Source: Digikey <https://www.digikey.de/products/en?keywords=311-0.0MCT-ND> 1k ___ Source: Digikey <https://www.digikey.de/products/en?keywords=RT0201FRE071KL-ND> 10k ___ Source: Digikey <https://www.digikey.de/products/en?keywords=RT0201FRE0710KL-ND> 100 ___ Source: Digikey <https://www.digikey.de/products/en?keywords=RT0201FRE07100RL-ND> 330 ___ Source: Digikey <https://www.digikey.de/products/en?keywords=RT0201FRE07330RL-ND> package: 0402 : 0R ___ Source: Digikey <https://www.digikey.de/products/en?keywords=311-0.0LRCT-ND> 1k ___ Source: Digikey <https://www.digikey.de/products/en?keywords=%20YAG1234CT-ND> 2k2 ___ Source: Digikey <https://www.digikey.de/products/en?keywords=RT0402FRE072K2L-ND> 2k ___ Source: Digikey <https://www.digikey.de/products/en?keywords=YAG3345CT-ND> 4k7 ___ Source: Digikey <https://www.digikey.de/products/en?keywords=YAG3347CT-ND%20> 10k ___ Source: Digikey <https://www.digikey.de/products/en?keywords=YAG1233CT-ND> 12k1 ___ Source: Digikey <https://www.digikey.de/products/en?keywords=RT0402FRE0712K1L-ND> 49R9 ___ Source: Digikey <https://www.digikey.de/products/en?keywords=YAG3346CT-ND> 56k ___ Source: Digikey <https://www.digikey.de/products/en?keywords=RT0402FRE0756K2L-ND> 100k ___ Source: Digikey <https://www.digikey.de/products/en?keywords=YAG2307CT-ND> 100 ___ Source: Digikey <https://www.digikey.de/products/en?keywords=YAG3342CT-ND> 150 ___ Source: Digikey <https://www.digikey.de/product-detail/en/yageo/RT0402FRE07150RL/13-RT0402FRE07150RLCT-ND/12705162> 300 ___ Source: Digikey <https://www.digikey.de/products/en?keywords=RT0402FRE07300RL-ND> package: 0603 : 0R ___ Source: Digikey <https://www.digikey.de/products/en?keywords=311-0.0HRCT-ND> 1k ___ Source: Digikey <https://www.digikey.de/products/en?keywords=YAG2323CT-ND> 10k ___ Source: Digikey <https://www.digikey.de/products/en?keywords=YAG2321CT-ND> 100k ___ Source: Digikey <https://www.digikey.de/products/en?keywords=YAG2319CT-ND> 100 ___ Source: Digikey <https://www.digikey.de/products/en?keywords=YAG2320CT-ND> 300 ___ Source: Digikey <https://www.digikey.de/products/en?keywords=RT0603FRE07300RL-ND> 330 ___ Source: Digikey <https://www.digikey.de/products/en?keywords=YAG5957CT-ND>; DIGIKEY: RT0402FRE0712K1L-ND; RVALUE: 12k1; SPICEPREFIX: R
R3 R6 R7 R24-R27 = msrm:RT?FRE07*L: SMD RESISTOR ± 1% Tol, Paper/PE taping reel, 50 ppm/°C, 7 inch dia. Reel Datasheet <http://www.yageo.com/documents/recent/PYu-RT_1-to-0.01_RoHS_L_11.pdf> package: 0201 : 0R ___ Source: Digikey <https://www.digikey.de/products/en?keywords=311-0.0MCT-ND> 1k ___ Source: Digikey <https://www.digikey.de/products/en?keywords=RT0201FRE071KL-ND> 10k ___ Source: Digikey <https://www.digikey.de/products/en?keywords=RT0201FRE0710KL-ND> 100 ___ Source: Digikey <https://www.digikey.de/products/en?keywords=RT0201FRE07100RL-ND> 330 ___ Source: Digikey <https://www.digikey.de/products/en?keywords=RT0201FRE07330RL-ND> package: 0402 : 0R ___ Source: Digikey <https://www.digikey.de/products/en?keywords=311-0.0LRCT-ND> 1k ___ Source: Digikey <https://www.digikey.de/products/en?keywords=%20YAG1234CT-ND> 2k2 ___ Source: Digikey <https://www.digikey.de/products/en?keywords=RT0402FRE072K2L-ND> 2k ___ Source: Digikey <https://www.digikey.de/products/en?keywords=YAG3345CT-ND> 4k7 ___ Source: Digikey <https://www.digikey.de/products/en?keywords=YAG3347CT-ND%20> 10k ___ Source: Digikey <https://www.digikey.de/products/en?keywords=YAG1233CT-ND> 12k1 ___ Source: Digikey <https://www.digikey.de/products/en?keywords=RT0402FRE0712K1L-ND> 49R9 ___ Source: Digikey <https://www.digikey.de/products/en?keywords=YAG3346CT-ND> 56k ___ Source: Digikey <https://www.digikey.de/products/en?keywords=RT0402FRE0756K2L-ND> 100k ___ Source: Digikey <https://www.digikey.de/products/en?keywords=YAG2307CT-ND> 100 ___ Source: Digikey <https://www.digikey.de/products/en?keywords=YAG3342CT-ND> 150 ___ Source: Digikey <https://www.digikey.de/product-detail/en/yageo/RT0402FRE07150RL/13-RT0402FRE07150RLCT-ND/12705162> 300 ___ Source: Digikey <https://www.digikey.de/products/en?keywords=RT0402FRE07300RL-ND> package: 0603 : 0R ___ Source: Digikey <https://www.digikey.de/products/en?keywords=311-0.0HRCT-ND> 1k ___ Source: Digikey <https://www.digikey.de/products/en?keywords=YAG2323CT-ND> 10k ___ Source: Digikey <https://www.digikey.de/products/en?keywords=YAG2321CT-ND> 100k ___ Source: Digikey <https://www.digikey.de/products/en?keywords=YAG2319CT-ND> 100 ___ Source: Digikey <https://www.digikey.de/products/en?keywords=YAG2320CT-ND> 300 ___ Source: Digikey <https://www.digikey.de/products/en?keywords=RT0603FRE07300RL-ND> 330 ___ Source: Digikey <https://www.digikey.de/products/en?keywords=YAG5957CT-ND>; DIGIKEY: YAG1233CT-ND; RVALUE: 10k; SPICEPREFIX: R
R4 R5 = msrm:RT?FRE07*L: SMD RESISTOR ± 1% Tol, Paper/PE taping reel, 50 ppm/°C, 7 inch dia. Reel Datasheet <http://www.yageo.com/documents/recent/PYu-RT_1-to-0.01_RoHS_L_11.pdf> package: 0201 : 0R ___ Source: Digikey <https://www.digikey.de/products/en?keywords=311-0.0MCT-ND> 1k ___ Source: Digikey <https://www.digikey.de/products/en?keywords=RT0201FRE071KL-ND> 10k ___ Source: Digikey <https://www.digikey.de/products/en?keywords=RT0201FRE0710KL-ND> 100 ___ Source: Digikey <https://www.digikey.de/products/en?keywords=RT0201FRE07100RL-ND> 330 ___ Source: Digikey <https://www.digikey.de/products/en?keywords=RT0201FRE07330RL-ND> package: 0402 : 0R ___ Source: Digikey <https://www.digikey.de/products/en?keywords=311-0.0LRCT-ND> 1k ___ Source: Digikey <https://www.digikey.de/products/en?keywords=%20YAG1234CT-ND> 2k2 ___ Source: Digikey <https://www.digikey.de/products/en?keywords=RT0402FRE072K2L-ND> 2k ___ Source: Digikey <https://www.digikey.de/products/en?keywords=YAG3345CT-ND> 4k7 ___ Source: Digikey <https://www.digikey.de/products/en?keywords=YAG3347CT-ND%20> 10k ___ Source: Digikey <https://www.digikey.de/products/en?keywords=YAG1233CT-ND> 12k1 ___ Source: Digikey <https://www.digikey.de/products/en?keywords=RT0402FRE0712K1L-ND> 49R9 ___ Source: Digikey <https://www.digikey.de/products/en?keywords=YAG3346CT-ND> 56k ___ Source: Digikey <https://www.digikey.de/products/en?keywords=RT0402FRE0756K2L-ND> 100k ___ Source: Digikey <https://www.digikey.de/products/en?keywords=YAG2307CT-ND> 100 ___ Source: Digikey <https://www.digikey.de/products/en?keywords=YAG3342CT-ND> 150 ___ Source: Digikey <https://www.digikey.de/product-detail/en/yageo/RT0402FRE07150RL/13-RT0402FRE07150RLCT-ND/12705162> 300 ___ Source: Digikey <https://www.digikey.de/products/en?keywords=RT0402FRE07300RL-ND> package: 0603 : 0R ___ Source: Digikey <https://www.digikey.de/products/en?keywords=311-0.0HRCT-ND> 1k ___ Source: Digikey <https://www.digikey.de/products/en?keywords=YAG2323CT-ND> 10k ___ Source: Digikey <https://www.digikey.de/products/en?keywords=YAG2321CT-ND> 100k ___ Source: Digikey <https://www.digikey.de/products/en?keywords=YAG2319CT-ND> 100 ___ Source: Digikey <https://www.digikey.de/products/en?keywords=YAG2320CT-ND> 300 ___ Source: Digikey <https://www.digikey.de/products/en?keywords=RT0603FRE07300RL-ND> 330 ___ Source: Digikey <https://www.digikey.de/products/en?keywords=YAG5957CT-ND>; DIGIKEY: YAG3347CT-ND; RVALUE: 4k7; SPICEPREFIX: R
R8-R15 = msrm:RT?FRE07*L: SMD RESISTOR ± 1% Tol, Paper/PE taping reel, 50 ppm/°C, 7 inch dia. Reel Datasheet <http://www.yageo.com/documents/recent/PYu-RT_1-to-0.01_RoHS_L_11.pdf> package: 0201 : 0R ___ Source: Digikey <https://www.digikey.de/products/en?keywords=311-0.0MCT-ND> 1k ___ Source: Digikey <https://www.digikey.de/products/en?keywords=RT0201FRE071KL-ND> 10k ___ Source: Digikey <https://www.digikey.de/products/en?keywords=RT0201FRE0710KL-ND> 100 ___ Source: Digikey <https://www.digikey.de/products/en?keywords=RT0201FRE07100RL-ND> 330 ___ Source: Digikey <https://www.digikey.de/products/en?keywords=RT0201FRE07330RL-ND> package: 0402 : 0R ___ Source: Digikey <https://www.digikey.de/products/en?keywords=311-0.0LRCT-ND> 1k ___ Source: Digikey <https://www.digikey.de/products/en?keywords=%20YAG1234CT-ND> 2k2 ___ Source: Digikey <https://www.digikey.de/products/en?keywords=RT0402FRE072K2L-ND> 2k ___ Source: Digikey <https://www.digikey.de/products/en?keywords=YAG3345CT-ND> 4k7 ___ Source: Digikey <https://www.digikey.de/products/en?keywords=YAG3347CT-ND%20> 10k ___ Source: Digikey <https://www.digikey.de/products/en?keywords=YAG1233CT-ND> 12k1 ___ Source: Digikey <https://www.digikey.de/products/en?keywords=RT0402FRE0712K1L-ND> 49R9 ___ Source: Digikey <https://www.digikey.de/products/en?keywords=YAG3346CT-ND> 56k ___ Source: Digikey <https://www.digikey.de/products/en?keywords=RT0402FRE0756K2L-ND> 100k ___ Source: Digikey <https://www.digikey.de/products/en?keywords=YAG2307CT-ND> 100 ___ Source: Digikey <https://www.digikey.de/products/en?keywords=YAG3342CT-ND> 150 ___ Source: Digikey <https://www.digikey.de/product-detail/en/yageo/RT0402FRE07150RL/13-RT0402FRE07150RLCT-ND/12705162> 300 ___ Source: Digikey <https://www.digikey.de/products/en?keywords=RT0402FRE07300RL-ND> package: 0603 : 0R ___ Source: Digikey <https://www.digikey.de/products/en?keywords=311-0.0HRCT-ND> 1k ___ Source: Digikey <https://www.digikey.de/products/en?keywords=YAG2323CT-ND> 10k ___ Source: Digikey <https://www.digikey.de/products/en?keywords=YAG2321CT-ND> 100k ___ Source: Digikey <https://www.digikey.de/products/en?keywords=YAG2319CT-ND> 100 ___ Source: Digikey <https://www.digikey.de/products/en?keywords=YAG2320CT-ND> 300 ___ Source: Digikey <https://www.digikey.de/products/en?keywords=RT0603FRE07300RL-ND> 330 ___ Source: Digikey <https://www.digikey.de/products/en?keywords=YAG5957CT-ND>; DIGIKEY: YAG3346CT-ND; RVALUE: 49R9; SPICEPREFIX: R
R18-R23 = msrm:RT?FRE07*L: SMD RESISTOR ± 1% Tol, Paper/PE taping reel, 50 ppm/°C, 7 inch dia. Reel Datasheet <http://www.yageo.com/documents/recent/PYu-RT_1-to-0.01_RoHS_L_11.pdf> package: 0201 : 0R ___ Source: Digikey <https://www.digikey.de/products/en?keywords=311-0.0MCT-ND> 1k ___ Source: Digikey <https://www.digikey.de/products/en?keywords=RT0201FRE071KL-ND> 10k ___ Source: Digikey <https://www.digikey.de/products/en?keywords=RT0201FRE0710KL-ND> 100 ___ Source: Digikey <https://www.digikey.de/products/en?keywords=RT0201FRE07100RL-ND> 330 ___ Source: Digikey <https://www.digikey.de/products/en?keywords=RT0201FRE07330RL-ND> package: 0402 : 0R ___ Source: Digikey <https://www.digikey.de/products/en?keywords=311-0.0LRCT-ND> 1k ___ Source: Digikey <https://www.digikey.de/products/en?keywords=%20YAG1234CT-ND> 2k2 ___ Source: Digikey <https://www.digikey.de/products/en?keywords=RT0402FRE072K2L-ND> 2k ___ Source: Digikey <https://www.digikey.de/products/en?keywords=YAG3345CT-ND> 4k7 ___ Source: Digikey <https://www.digikey.de/products/en?keywords=YAG3347CT-ND%20> 10k ___ Source: Digikey <https://www.digikey.de/products/en?keywords=YAG1233CT-ND> 12k1 ___ Source: Digikey <https://www.digikey.de/products/en?keywords=RT0402FRE0712K1L-ND> 49R9 ___ Source: Digikey <https://www.digikey.de/products/en?keywords=YAG3346CT-ND> 56k ___ Source: Digikey <https://www.digikey.de/products/en?keywords=RT0402FRE0756K2L-ND> 100k ___ Source: Digikey <https://www.digikey.de/products/en?keywords=YAG2307CT-ND> 100 ___ Source: Digikey <https://www.digikey.de/products/en?keywords=YAG3342CT-ND> 150 ___ Source: Digikey <https://www.digikey.de/product-detail/en/yageo/RT0402FRE07150RL/13-RT0402FRE07150RLCT-ND/12705162> 300 ___ Source: Digikey <https://www.digikey.de/products/en?keywords=RT0402FRE07300RL-ND> package: 0603 : 0R ___ Source: Digikey <https://www.digikey.de/products/en?keywords=311-0.0HRCT-ND> 1k ___ Source: Digikey <https://www.digikey.de/products/en?keywords=YAG2323CT-ND> 10k ___ Source: Digikey <https://www.digikey.de/products/en?keywords=YAG2321CT-ND> 100k ___ Source: Digikey <https://www.digikey.de/products/en?keywords=YAG2319CT-ND> 100 ___ Source: Digikey <https://www.digikey.de/products/en?keywords=YAG2320CT-ND> 300 ___ Source: Digikey <https://www.digikey.de/products/en?keywords=RT0603FRE07300RL-ND> 330 ___ Source: Digikey <https://www.digikey.de/products/en?keywords=YAG5957CT-ND>; DIGIKEY: YAG3342CT-ND; RVALUE: 100; SPICEPREFIX: R
T1 T2 = msrm:749020100: TRANSFORMER LAN 350µH LAN 10/100 Base-T, Power over Ethernet (PoE) Pulse Transformer 1:1 Surface Mount Source: Digikey <https://www.digikey.de/products/de?keywords=732-3268-1-ND> ; Datasheet <https://www.we-online.de/katalog/datasheet/749020100.pdf>; DIGIKEY: 732-3268-1-ND
X1 X2 = msrm:8743?-04*3: Wire-to-Board 1.50mm (.059") Pitch Header - SMT, Shrouded Source: http://www.molex.com/product/micro/87437.html; DIGIKEY: WM7648CT-ND; MF: MOLEX
Y1 = msrm:ECS-*?-TR: SMD CRYSTAL Various frequencies, with GND pins Part Numbering <http://www.ecsxtal.com/store/pdf/partnumber4.pdf> package: ECS-33B : XC2845 ___ Source: Digikey <https://www.digikey.de/products/en?keywords=%20XC2845CT-ND> ; Datasheet <https://ecsxtal.com/store/pdf/ECS-33B.pdf> XC2439 ___ Source: Digikey <https://www.digikey.de/products/en?keywords=XC2439CT-ND> ; Datasheet <https://ecsxtal.com/store/pdf/ECS-33B.pdf> XC2458 ___ Source: Digikey <https://www.digikey.de/products/en?keywords=XC2458CT-ND> ; Datasheet <https://ecsxtal.com/store/pdf/ECS-33B.pdf> XC2479 ___ Source: Digikey <https://www.digikey.de/products/en?keywords=XC2479CT-ND> ; Datasheet <https://ecsxtal.com/store/pdf/ECS-33B.pdf> XC2547 ___ Source: Digikey <https://www.digikey.de/products/en?keywords=XC2547CT-ND> ; Datasheet <https://ecsxtal.com/store/pdf/ECS-33B.pdf> package: ECX2236 : XC3046 ___ Source: Digikey <https://www.digikey.de/products/en?keywords=XC3046CT-ND> ; Datasheet <https://ecsxtal.com/store/pdf/ECX-2236B.pdf> XC3048 ___ Source: Digikey <https://www.digikey.de/products/en?keywords=XC3048CT-ND> ; Datasheet <https://ecsxtal.com/store/pdf/ECX-2236B.pdf> XC3051 ___ Source: Digikey <https://www.digikey.de/products/en?keywords=XC3051CT-ND> ; Datasheet <https://ecsxtal.com/store/pdf/ECX-2236B.pdf> XC3093 ___ Source: Digikey <https://www.digikey.de/products/en?keywords=XC3093CT-ND> ; Datasheet <https://ecsxtal.com/store/pdf/ECX-2236B.pdf> XC3053 ___ Source: Digikey <https://www.digikey.de/products/en?keywords=XC3053CT-ND> ; Datasheet <https://ecsxtal.com/store/pdf/ECX-2236B.pdf> XC3052 ___ Source: Digikey <https://www.digikey.de/products/en?keywords=XC3052CT-ND> ; Datasheet <https://ecsxtal.com/store/pdf/ECX-2236B.pdf> XC3054 ___ Source: Digikey <https://www.digikey.de/products/en?keywords=XC3054CT-ND> ; Datasheet <https://ecsxtal.com/store/pdf/ECX-2236B.pdf> XC3057 ___ Source: Digikey <https://www.digikey.de/products/en?keywords=XC3057CT-ND> ; Datasheet <https://ecsxtal.com/store/pdf/ECX-2236B.pdf> XC3058 ___ Source: Digikey <https://www.digikey.de/products/en?keywords=XC3058CT-ND> ; Datasheet <https://ecsxtal.com/store/pdf/ECX-2236B.pdf> XC3060 ___ Source: Digikey <https://www.digikey.de/products/en?keywords=XC3060CT-ND> ; Datasheet <https://ecsxtal.com/store/pdf/ECX-2236B.pdf> XC3059 ___ Source: Digikey <https://www.digikey.de/products/en?keywords=XC3059CT-ND> ; Datasheet <https://ecsxtal.com/store/pdf/ECX-2236B.pdf>; DIGIKEY: XC3051CT-ND; F: 25MHz; F_TOLERANCE: ±10ppm; L_CAPACITANCE: 18pF

## Module TORQUE
Ports: +3V3(pwr) GND(pwr) VO_AMP(out) VO_REF(io)
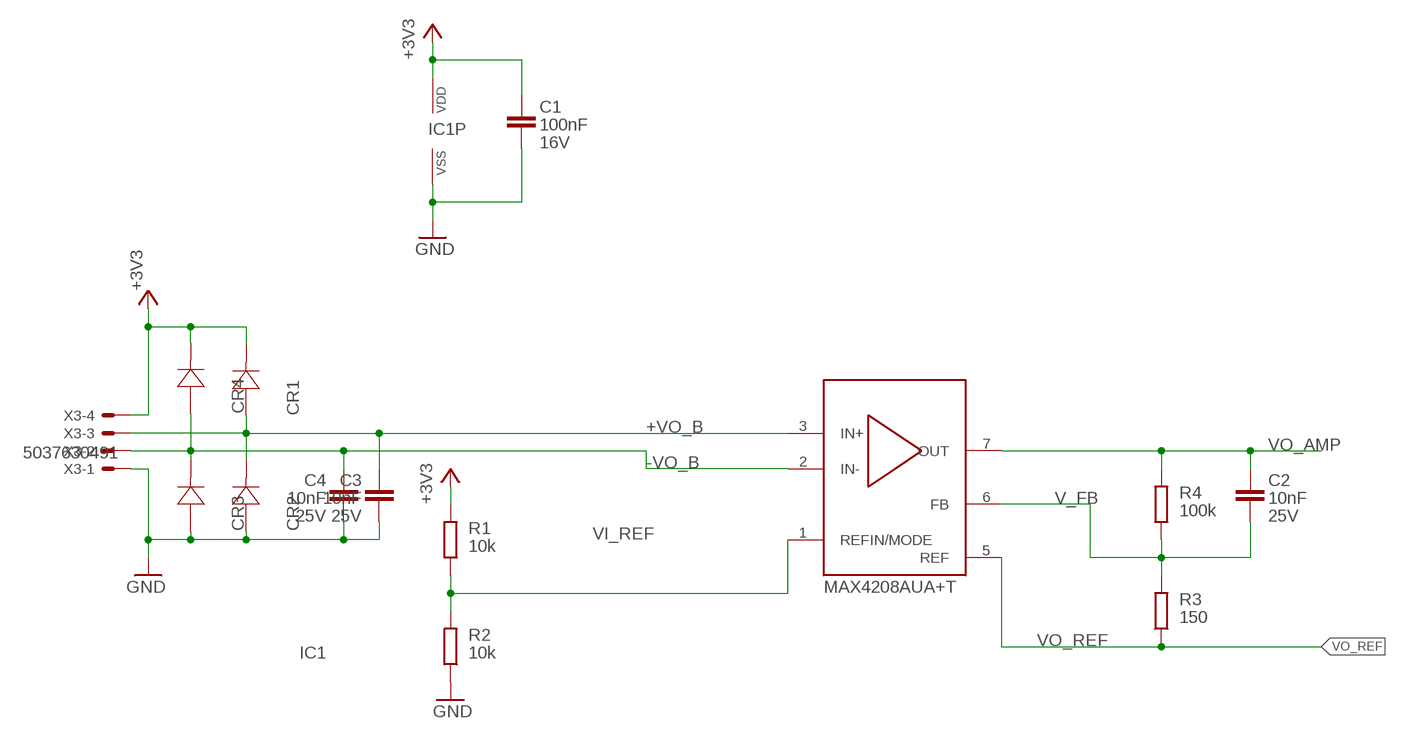
[diagram p5: schematic, module TORQUE, sheet 1]

### Parts
C1  GCM155R71C104JA55  [C0402]
C2  GCM155R71E103KA37  [C0402]
C3  GCM155R71E103KA37  [C0402]
C4  GCM155R71E103KA37  [C0402]
CR1  CDSQR4148  [0402/SOD-923F]
CR2  CDSQR4148  [0402/SOD-923F]
CR3  CDSQR4148  [0402/SOD-923F]
CR4  CDSQR4148  [0402/SOD-923F]
IC1  MAX4208AUA+T  [USOP8]
R1  RT0402FRE0710KL  [R0402]
R2  RT0402FRE0710KL  [R0402]
R3  RT0402FRE07150RL  [R0402]
R4  RT0402FRE07100KL  [R0402]
X3  5037630491  [5037630491]

### Nets
+3V3: C1.1 CR1.2(C) CR4.2(C) IC1.8(VDD) R1.2 X3.4
+VO_B: C3.1 CR1.1(A) CR2.2(C) IC1.3(IN+) X3.3
-VO_B: C4.1 CR3.2(C) CR4.1(A) IC1.2(IN-) X3.2
GND: C1.2 C3.2 C4.2 CR2.1(A) CR3.1(A) IC1.4(VSS) R2.1 X3.1
V_FB: C2.2 IC1.6(FB) R3.2 R4.1
VI_REF: IC1.1(REFIN/MODE) R1.1 R2.2
VO_AMP: C2.1 IC1.7(OUT) R4.2
VO_REF: IC1.5(REF) R3.1

### Library data of the parts
C1 = msrm:GCM?R7*: Multilayer Ceramic Capacitors Chip Multilayer Ceramic Capacitors for Automotive –55 to 125°C Sources: Catalogue <https://www.murata.com/~/media/webrenewal/support/library/catalog/products/capacitor/mlcc/c03e.ashx?la=en-us> Part Numbering <https://search.murata.co.jp/Ceramy/image/img/A01X/partnumbering_e_02.pdf> package: C0201 : 470pF ___ Source: Digikey <https://www.digikey.de/products/en?keywords=490-17744-1-ND> ; Datasheet <https://search.murata.co.jp/Ceramy/image/img/A01X/G101/ENG/GCM033R71E471KA03-01.pdf> package: C0402 : 100nF ___ Source: Digikey <https://www.digikey.de/products/en?keywords=490-16433-1-ND> ; Datasheet <https://search.murata.co.jp/Ceramy/image/img/A01X/G101/ENG/GCM155R71C104JA55-01.pdf> 220nF ___ Source: Digikey <https://www.digikey.de/products/en?keywords=490-10671-1-ND> ; Datasheet <https://www.murata.com/-/media/webrenewal/support/library/catalog/products/capacitor/ceramiccapacitor/c03e.ashx?la=en-us&cvid=20200707014404000000> 6.8nF ___ Source: Digikey <https://www.digikey.de/products/en?keywords=490-12655-1-ND> ; Datasheet <https://search.murata.co.jp/Ceramy/image/img/A01X/G101/ENG/GCM155R71C683KA55-01.pdf> 10nF ___ Source: Digikey <https://www.digikey.de/products/en?keywords=490-6043-1-ND> ; Datasheet <https://search.murata.co.jp/Ceramy/image/img/A01X/G101/ENG/GCM155R71E103KA37-01.pdf> 22nF ___ Source: Digikey <https://www.digikey.de/products/en?keywords=490-6044-1-ND> ; Datasheet <https://search.murata.co.jp/Ceramy/image/img/A01X/G101/ENG/GCM155R71E223KA55-01.pdf> 470pF ___ Source: Digikey <https://www.digikey.de/products/en?keywords=490-4913-1-ND> ; Datasheet <https://search.murata.co.jp/Ceramy/image/img/A01X/G101/ENG/GCM155R71H471KA37-01.pdf> package: C0603 : 1µF ___ Source: Digikey <https://www.digikey.de/products/en?keywords=490-5241-1-ND> ; Datasheet <https://www.murata.com/-/media/webrenewal/support/library/catalog/products/capacitor/ceramiccapacitor/c03e.ashx?la=en-us&cvid=20200707014404000000> 470nF ___ Source: Digikey <https://www.digikey.de/products/en?keywords=490-12589-1-ND> ; Datasheet <https://search.murata.co.jp/Ceramy/image/img/A01X/G101/ENG/GCM188R71C474KA55-01.pdf> 10nF ___ Source: Digikey <https://www.digikey.de/products/en?keywords=490-4781-1-ND> ; Datasheet <https://search.murata.co.jp/Ceramy/image/img/A01X/G101/ENG/GCM188R72A103KA37-01.pdf> 22nF ___ Source: Digikey <https://www.digikey.de/products/en?keywords=490-4782-1-ND> ; Datasheet <https://www.murata.com/-/media/webrenewal/support/library/catalog/products/capacitor/ceramiccapacitor/c03e.ashx?la=en-us&cvid=20200707014404000000> package: C0805 : 10µF ___ Source: Digikey <https://www.digikey.de/products/en?keywords=490-14361-1-ND> ; Datasheet <https://search.murata.co.jp/Ceramy/image/img/A01X/G101/ENG/GCM21BR70J106KE22-01.pdf> 2.2µF ___ Source: Digikey <https://www.digikey.de/products/en?keywords=490-4786-1-ND> ; Datasheet <https://search.murata.co.jp/Ceramy/image/img/A01X/G101/ENG/GCM21BR71C225KA64-01.pdf> 470nF ___ Source: Digikey <https://www.digikey.de/products/en?keywords=490-4788-1-ND> ; Datasheet <https://search.murata.co.jp/Ceramy/image/img/A01X/G101/ENG/GCM21BR71H474KA55-01.pdf> 100nF ___ Source: Digikey <https://www.digikey.de/products/en?keywords=490-8051-1-ND> ; Datasheet <https://search.murata.co.jp/Ceramy/image/img/A01X/G101/ENG/GCM21BR72A104KA37-01.pdf> package: C0805K : 220nF ___ Source: Digikey <https://www.digikey.de/products/en?keywords=490-8306-1-ND> ; Datasheet <https://search.murata.co.jp/Ceramy/image/img/A01X/G101/ENG/GRM21AR72A224KAC5-01.pdf> package: C1206 : 10µF ___ Source: Digikey <https://www.digikey.de/products/en?keywords=490-14746-1-ND> ; Datasheet <https://search.murata.co.jp/Ceramy/image/img/A01X/G101/ENG/GCM31CR71C106KA64-01.pdf> 2.2µF ___ Source: Digikey <https://www.digikey.de/products/en?keywords=490-11169-1-ND> ; Datasheet <https://search.murata.co.jp/Ceramy/image/img/A01X/G101/ENG/GCM31CR71H225KA55-01.pdf> package: C1206 : 2220nF ___ Source: Digikey <https://www.digikey.de/products/en?keywords=490-4975-1-ND> ; Datasheet <https://search.murata.co.jp/Ceramy/image/img/A01X/G101/ENG/GCM31MR72A224KA37-01.pdf>; CAPACITANCE: 100nF; DIGIKEY: 490-16433-1-ND; TOLERANCE: ±5%; VOLTAGE: 16V
C2-C4 = msrm:GCM?R7*: Multilayer Ceramic Capacitors Chip Multilayer Ceramic Capacitors for Automotive –55 to 125°C Sources: Catalogue <https://www.murata.com/~/media/webrenewal/support/library/catalog/products/capacitor/mlcc/c03e.ashx?la=en-us> Part Numbering <https://search.murata.co.jp/Ceramy/image/img/A01X/partnumbering_e_02.pdf> package: C0201 : 470pF ___ Source: Digikey <https://www.digikey.de/products/en?keywords=490-17744-1-ND> ; Datasheet <https://search.murata.co.jp/Ceramy/image/img/A01X/G101/ENG/GCM033R71E471KA03-01.pdf> package: C0402 : 100nF ___ Source: Digikey <https://www.digikey.de/products/en?keywords=490-16433-1-ND> ; Datasheet <https://search.murata.co.jp/Ceramy/image/img/A01X/G101/ENG/GCM155R71C104JA55-01.pdf> 220nF ___ Source: Digikey <https://www.digikey.de/products/en?keywords=490-10671-1-ND> ; Datasheet <https://www.murata.com/-/media/webrenewal/support/library/catalog/products/capacitor/ceramiccapacitor/c03e.ashx?la=en-us&cvid=20200707014404000000> 6.8nF ___ Source: Digikey <https://www.digikey.de/products/en?keywords=490-12655-1-ND> ; Datasheet <https://search.murata.co.jp/Ceramy/image/img/A01X/G101/ENG/GCM155R71C683KA55-01.pdf> 10nF ___ Source: Digikey <https://www.digikey.de/products/en?keywords=490-6043-1-ND> ; Datasheet <https://search.murata.co.jp/Ceramy/image/img/A01X/G101/ENG/GCM155R71E103KA37-01.pdf> 22nF ___ Source: Digikey <https://www.digikey.de/products/en?keywords=490-6044-1-ND> ; Datasheet <https://search.murata.co.jp/Ceramy/image/img/A01X/G101/ENG/GCM155R71E223KA55-01.pdf> 470pF ___ Source: Digikey <https://www.digikey.de/products/en?keywords=490-4913-1-ND> ; Datasheet <https://search.murata.co.jp/Ceramy/image/img/A01X/G101/ENG/GCM155R71H471KA37-01.pdf> package: C0603 : 1µF ___ Source: Digikey <https://www.digikey.de/products/en?keywords=490-5241-1-ND> ; Datasheet <https://www.murata.com/-/media/webrenewal/support/library/catalog/products/capacitor/ceramiccapacitor/c03e.ashx?la=en-us&cvid=20200707014404000000> 470nF ___ Source: Digikey <https://www.digikey.de/products/en?keywords=490-12589-1-ND> ; Datasheet <https://search.murata.co.jp/Ceramy/image/img/A01X/G101/ENG/GCM188R71C474KA55-01.pdf> 10nF ___ Source: Digikey <https://www.digikey.de/products/en?keywords=490-4781-1-ND> ; Datasheet <https://search.murata.co.jp/Ceramy/image/img/A01X/G101/ENG/GCM188R72A103KA37-01.pdf> 22nF ___ Source: Digikey <https://www.digikey.de/products/en?keywords=490-4782-1-ND> ; Datasheet <https://www.murata.com/-/media/webrenewal/support/library/catalog/products/capacitor/ceramiccapacitor/c03e.ashx?la=en-us&cvid=20200707014404000000> package: C0805 : 10µF ___ Source: Digikey <https://www.digikey.de/products/en?keywords=490-14361-1-ND> ; Datasheet <https://search.murata.co.jp/Ceramy/image/img/A01X/G101/ENG/GCM21BR70J106KE22-01.pdf> 2.2µF ___ Source: Digikey <https://www.digikey.de/products/en?keywords=490-4786-1-ND> ; Datasheet <https://search.murata.co.jp/Ceramy/image/img/A01X/G101/ENG/GCM21BR71C225KA64-01.pdf> 470nF ___ Source: Digikey <https://www.digikey.de/products/en?keywords=490-4788-1-ND> ; Datasheet <https://search.murata.co.jp/Ceramy/image/img/A01X/G101/ENG/GCM21BR71H474KA55-01.pdf> 100nF ___ Source: Digikey <https://www.digikey.de/products/en?keywords=490-8051-1-ND> ; Datasheet <https://search.murata.co.jp/Ceramy/image/img/A01X/G101/ENG/GCM21BR72A104KA37-01.pdf> package: C0805K : 220nF ___ Source: Digikey <https://www.digikey.de/products/en?keywords=490-8306-1-ND> ; Datasheet <https://search.murata.co.jp/Ceramy/image/img/A01X/G101/ENG/GRM21AR72A224KAC5-01.pdf> package: C1206 : 10µF ___ Source: Digikey <https://www.digikey.de/products/en?keywords=490-14746-1-ND> ; Datasheet <https://search.murata.co.jp/Ceramy/image/img/A01X/G101/ENG/GCM31CR71C106KA64-01.pdf> 2.2µF ___ Source: Digikey <https://www.digikey.de/products/en?keywords=490-11169-1-ND> ; Datasheet <https://search.murata.co.jp/Ceramy/image/img/A01X/G101/ENG/GCM31CR71H225KA55-01.pdf> package: C1206 : 2220nF ___ Source: Digikey <https://www.digikey.de/products/en?keywords=490-4975-1-ND> ; Datasheet <https://search.murata.co.jp/Ceramy/image/img/A01X/G101/ENG/GCM31MR72A224KA37-01.pdf>; CAPACITANCE: 10nF; DIGIKEY: 490-6043-1-ND; TOLERANCE: ±10%; VOLTAGE: 25V
CR1-CR4 = msrm:CDSQR4148: Diode Standard 75V 150mA Surface Mount 0402/SOD-923F package: 0402-SOD : 641-1287-1 ___ Source: Digikey <https://www.digikey.de/products/en?keywords=641-1287-1-ND> ; Datasheet <https://www.comchiptech.com/admin/files/product/CDSQR4148-HF-RevC213424.pdf>; CURRENT: 150mA; DIGIKEY: 641-1287-1-ND; VOLTAGE: 75V
IC1 = msrm:MAX42*: Instrument Amp Single R-R O/P 2.75/5.5V package: USOP8 : MAX4289 ___ Source: Digikey <https://www.digikey.de/product-detail/en/maxim-integrated/MAX4208AUA-T/MAX4208AUA-TCT-ND/9760057> ; Datasheet <http://datasheets.maximintegrated.com/en/ds/MAX4208-MAX4209.pdf> MAX4209 ___ Source: Digikey <https://www.digikey.de/product-detail/en/maxim-integrated/MAX4209HAUA/MAX4209HAUA-ND/1780104> ; Datasheet <http://datasheets.maximintegrated.com/en/ds/MAX4208-MAX4209.pdf>; DESCRIPTION: Instrument Amp Single R-R O/P 2.75/5.5V; DIGIKEY: MAX4208AUA+-ND; HEIGHT: 1.1mm; INPUT_RESISTANCE: 2G; MANUFACTURER_NAME: Maxim Integrated; MANUFACTURER_PART_NUMBER: MAX4208AUA+; MOUSER_PART_NUMBER: 700-MAX4208AUA; MOUSER_PRICE-STOCK: https://www.mouser.com/Search/Refine.aspx?Keyword=700-MAX4208AUA; RS_PART_NUMBER: 7328406P; RS_PRICE-STOCK: http://uk.rs-online.com/web/p/products/7328406P; SUPPLY_CURRENT: Buffer OFF: 0.75 - 1.3 mA Buffer ON: 1.4 - 2.3 mA; SUPPLY_VOLTAGE: Single: 2.85 - 5.5 Dual: ±1.425 - ±2.75; VOLTAGE_GAIN: 1 - (1 + R2/R1)
R1 R2 = msrm:RT?FRE07*L: SMD RESISTOR ± 1% Tol, Paper/PE taping reel, 50 ppm/°C, 7 inch dia. Reel Datasheet <http://www.yageo.com/documents/recent/PYu-RT_1-to-0.01_RoHS_L_11.pdf> package: 0201 : 0R ___ Source: Digikey <https://www.digikey.de/products/en?keywords=311-0.0MCT-ND> 1k ___ Source: Digikey <https://www.digikey.de/products/en?keywords=RT0201FRE071KL-ND> 10k ___ Source: Digikey <https://www.digikey.de/products/en?keywords=RT0201FRE0710KL-ND> 100 ___ Source: Digikey <https://www.digikey.de/products/en?keywords=RT0201FRE07100RL-ND> 330 ___ Source: Digikey <https://www.digikey.de/products/en?keywords=RT0201FRE07330RL-ND> package: 0402 : 0R ___ Source: Digikey <https://www.digikey.de/products/en?keywords=311-0.0LRCT-ND> 1k ___ Source: Digikey <https://www.digikey.de/products/en?keywords=%20YAG1234CT-ND> 2k2 ___ Source: Digikey <https://www.digikey.de/products/en?keywords=RT0402FRE072K2L-ND> 2k ___ Source: Digikey <https://www.digikey.de/products/en?keywords=YAG3345CT-ND> 4k7 ___ Source: Digikey <https://www.digikey.de/products/en?keywords=YAG3347CT-ND%20> 10k ___ Source: Digikey <https://www.digikey.de/products/en?keywords=YAG1233CT-ND> 12k1 ___ Source: Digikey <https://www.digikey.de/products/en?keywords=RT0402FRE0712K1L-ND> 49R9 ___ Source: Digikey <https://www.digikey.de/products/en?keywords=YAG3346CT-ND> 56k ___ Source: Digikey <https://www.digikey.de/products/en?keywords=RT0402FRE0756K2L-ND> 100k ___ Source: Digikey <https://www.digikey.de/products/en?keywords=YAG2307CT-ND> 100 ___ Source: Digikey <https://www.digikey.de/products/en?keywords=YAG3342CT-ND> 150 ___ Source: Digikey <https://www.digikey.de/product-detail/en/yageo/RT0402FRE07150RL/13-RT0402FRE07150RLCT-ND/12705162> 300 ___ Source: Digikey <https://www.digikey.de/products/en?keywords=RT0402FRE07300RL-ND> package: 0603 : 0R ___ Source: Digikey <https://www.digikey.de/products/en?keywords=311-0.0HRCT-ND> 1k ___ Source: Digikey <https://www.digikey.de/products/en?keywords=YAG2323CT-ND> 10k ___ Source: Digikey <https://www.digikey.de/products/en?keywords=YAG2321CT-ND> 100k ___ Source: Digikey <https://www.digikey.de/products/en?keywords=YAG2319CT-ND> 100 ___ Source: Digikey <https://www.digikey.de/products/en?keywords=YAG2320CT-ND> 300 ___ Source: Digikey <https://www.digikey.de/products/en?keywords=RT0603FRE07300RL-ND> 330 ___ Source: Digikey <https://www.digikey.de/products/en?keywords=YAG5957CT-ND>; DIGIKEY: YAG1233CT-ND; RVALUE: 10k; SPICEPREFIX: R
R3 = msrm:RT?FRE07*L: SMD RESISTOR ± 1% Tol, Paper/PE taping reel, 50 ppm/°C, 7 inch dia. Reel Datasheet <http://www.yageo.com/documents/recent/PYu-RT_1-to-0.01_RoHS_L_11.pdf> package: 0201 : 0R ___ Source: Digikey <https://www.digikey.de/products/en?keywords=311-0.0MCT-ND> 1k ___ Source: Digikey <https://www.digikey.de/products/en?keywords=RT0201FRE071KL-ND> 10k ___ Source: Digikey <https://www.digikey.de/products/en?keywords=RT0201FRE0710KL-ND> 100 ___ Source: Digikey <https://www.digikey.de/products/en?keywords=RT0201FRE07100RL-ND> 330 ___ Source: Digikey <https://www.digikey.de/products/en?keywords=RT0201FRE07330RL-ND> package: 0402 : 0R ___ Source: Digikey <https://www.digikey.de/products/en?keywords=311-0.0LRCT-ND> 1k ___ Source: Digikey <https://www.digikey.de/products/en?keywords=%20YAG1234CT-ND> 2k2 ___ Source: Digikey <https://www.digikey.de/products/en?keywords=RT0402FRE072K2L-ND> 2k ___ Source: Digikey <https://www.digikey.de/products/en?keywords=YAG3345CT-ND> 4k7 ___ Source: Digikey <https://www.digikey.de/products/en?keywords=YAG3347CT-ND%20> 10k ___ Source: Digikey <https://www.digikey.de/products/en?keywords=YAG1233CT-ND> 12k1 ___ Source: Digikey <https://www.digikey.de/products/en?keywords=RT0402FRE0712K1L-ND> 49R9 ___ Source: Digikey <https://www.digikey.de/products/en?keywords=YAG3346CT-ND> 56k ___ Source: Digikey <https://www.digikey.de/products/en?keywords=RT0402FRE0756K2L-ND> 100k ___ Source: Digikey <https://www.digikey.de/products/en?keywords=YAG2307CT-ND> 100 ___ Source: Digikey <https://www.digikey.de/products/en?keywords=YAG3342CT-ND> 150 ___ Source: Digikey <https://www.digikey.de/product-detail/en/yageo/RT0402FRE07150RL/13-RT0402FRE07150RLCT-ND/12705162> 300 ___ Source: Digikey <https://www.digikey.de/products/en?keywords=RT0402FRE07300RL-ND> package: 0603 : 0R ___ Source: Digikey <https://www.digikey.de/products/en?keywords=311-0.0HRCT-ND> 1k ___ Source: Digikey <https://www.digikey.de/products/en?keywords=YAG2323CT-ND> 10k ___ Source: Digikey <https://www.digikey.de/products/en?keywords=YAG2321CT-ND> 100k ___ Source: Digikey <https://www.digikey.de/products/en?keywords=YAG2319CT-ND> 100 ___ Source: Digikey <https://www.digikey.de/products/en?keywords=YAG2320CT-ND> 300 ___ Source: Digikey <https://www.digikey.de/products/en?keywords=RT0603FRE07300RL-ND> 330 ___ Source: Digikey <https://www.digikey.de/products/en?keywords=YAG5957CT-ND>; DIGIKEY: 13-RT0402FRE07150RLCT-ND; RVALUE: 150; SPICEPREFIX: R
R4 = msrm:RT?FRE07*L: SMD RESISTOR ± 1% Tol, Paper/PE taping reel, 50 ppm/°C, 7 inch dia. Reel Datasheet <http://www.yageo.com/documents/recent/PYu-RT_1-to-0.01_RoHS_L_11.pdf> package: 0201 : 0R ___ Source: Digikey <https://www.digikey.de/products/en?keywords=311-0.0MCT-ND> 1k ___ Source: Digikey <https://www.digikey.de/products/en?keywords=RT0201FRE071KL-ND> 10k ___ Source: Digikey <https://www.digikey.de/products/en?keywords=RT0201FRE0710KL-ND> 100 ___ Source: Digikey <https://www.digikey.de/products/en?keywords=RT0201FRE07100RL-ND> 330 ___ Source: Digikey <https://www.digikey.de/products/en?keywords=RT0201FRE07330RL-ND> package: 0402 : 0R ___ Source: Digikey <https://www.digikey.de/products/en?keywords=311-0.0LRCT-ND> 1k ___ Source: Digikey <https://www.digikey.de/products/en?keywords=%20YAG1234CT-ND> 2k2 ___ Source: Digikey <https://www.digikey.de/products/en?keywords=RT0402FRE072K2L-ND> 2k ___ Source: Digikey <https://www.digikey.de/products/en?keywords=YAG3345CT-ND> 4k7 ___ Source: Digikey <https://www.digikey.de/products/en?keywords=YAG3347CT-ND%20> 10k ___ Source: Digikey <https://www.digikey.de/products/en?keywords=YAG1233CT-ND> 12k1 ___ Source: Digikey <https://www.digikey.de/products/en?keywords=RT0402FRE0712K1L-ND> 49R9 ___ Source: Digikey <https://www.digikey.de/products/en?keywords=YAG3346CT-ND> 56k ___ Source: Digikey <https://www.digikey.de/products/en?keywords=RT0402FRE0756K2L-ND> 100k ___ Source: Digikey <https://www.digikey.de/products/en?keywords=YAG2307CT-ND> 100 ___ Source: Digikey <https://www.digikey.de/products/en?keywords=YAG3342CT-ND> 150 ___ Source: Digikey <https://www.digikey.de/product-detail/en/yageo/RT0402FRE07150RL/13-RT0402FRE07150RLCT-ND/12705162> 300 ___ Source: Digikey <https://www.digikey.de/products/en?keywords=RT0402FRE07300RL-ND> package: 0603 : 0R ___ Source: Digikey <https://www.digikey.de/products/en?keywords=311-0.0HRCT-ND> 1k ___ Source: Digikey <https://www.digikey.de/products/en?keywords=YAG2323CT-ND> 10k ___ Source: Digikey <https://www.digikey.de/products/en?keywords=YAG2321CT-ND> 100k ___ Source: Digikey <https://www.digikey.de/products/en?keywords=YAG2319CT-ND> 100 ___ Source: Digikey <https://www.digikey.de/products/en?keywords=YAG2320CT-ND> 300 ___ Source: Digikey <https://www.digikey.de/products/en?keywords=RT0603FRE07300RL-ND> 330 ___ Source: Digikey <https://www.digikey.de/products/en?keywords=YAG5957CT-ND>; DIGIKEY: YAG2307CT-ND; RVALUE: 100k; SPICEPREFIX: R
X3 = msrm:5037630491: Pico-Lock 503763 Connector Header Surface Mount, Right Angle 4 position 0.039" (1.00mm); DIGIKEY: WM10655CT-ND

## Module 5-3.3VCONVERTER
Ports: +5V(pwr) +3V3(pwr) GND(pwr)
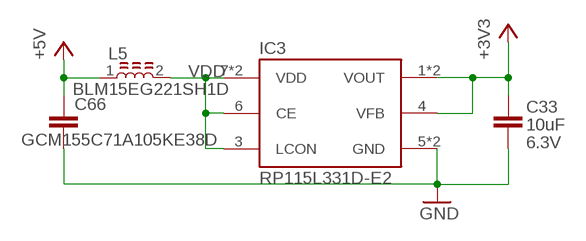
[diagram p6: schematic, module 5-3.3VCONVERTER, sheet 1]

### Parts
C33  GRM155C80J106ME11D  [C0402]
C66  GCM155C71A105KE38D  [C0402]
IC3  RP115L331D-E2  [SON40P120X160X40-9T30X130N]
L5  BLM15EG221SH1D  [BEAD0402]

### Nets
+3V3 [Power]: C33.1 IC3.1(VOUT) IC3.2(VOUT) IC3.4(VFB)
+5V: C66.1 L5.1
GND [Power]: C33.2 C66.2 IC3.5(GND) IC3.9(GND)
VDD: IC3.3(LCON) IC3.6(CE) IC3.7(VDD) IC3.8(VDD) L5.2

### Library data of the parts
C33 = msrm:GRM?C8*: CAP CER 10UF 6.3V X6S 0402 package: C0402 : 10µF ___ Source: Digikey <https://www.digikey.de/products/en?keywords=490-13233-1-ND> ; Datasheet <https://search.murata.co.jp/Ceramy/image/img/A01X/G101/ENG/GRM155C80J106ME11-01.pdf> 2.2µF ___ Source: Digikey <https://www.digikey.de/products/en?keywords=490-10012-1-ND> ; Datasheet <https://search.murata.co.jp/Ceramy/image/img/A01X/G101/ENG/GRM155C80J225KE95-01.pdf> 4.7µF ___ Source: Digikey <https://www.digikey.de/products/en?keywords=490-14458-1-ND> ; Datasheet <https://search.murata.co.jp/Ceramy/image/img/A01X/G101/ENG/GRM155C80J475MEAA-01.pdf>; CAPACITANCE: 10uF; DIGIKEY: 490-13233-1-ND; TOLERANCE: ±20%; VOLTAGE: 6.3V
C66 = msrm:GCM?C7*: Multilayer Ceramic Capacitors Chip Multilayer Ceramic Capacitors for Automotive Sources: Catalogue <https://www.murata.com/~/media/webrenewal/support/library/catalog/products/capacitor/mlcc/c03e.ashx?la=en-us> Part Numbering <https://search.murata.co.jp/Ceramy/image/img/A01X/partnumbering_e_02.pdf> package: C0402 : 490-13409-1 ___ Source: Digikey <https://www.digikey.de/products/en?keywords=490-13409-1-ND> ; Datasheet <https://www.murata.com/-/media/webrenewal/support/library/catalog/products/capacitor/ceramiccapacitor/c03e.ashx?la=en-us&cvid=20200707014404000000> 490-14427-1 ___ Source: Digikey <https://www.digikey.de/products/en?keywords=490-14427-1-ND> ; Datasheet <https://search.murata.co.jp/Ceramy/image/img/A01X/G101/ENG/GCM155C71A474KE36-01.pdf>; CAPACITANCE: 1uF; DIGIKEY: 490-13409-1-ND; TOLERANCE: ±10%; VOLTAGE: 10V
IC3 = msrm:RP115?*: Linear Voltage Regulator IC 1 Output 1A DFN1216-8 package: 8-XFDFN Exposed Pad : L331D-E2 ___ Source: Digikey <https://www.digikey.de/products/en?keywords=2129-RP115L331D-E2CT-ND> ; Datasheet <https://www.n-redc.co.jp/en/pdf/datasheet/rp115-ea.pdf>; CURRENT: 1A; DIGIKEY: 2129-RP115L331D-E2CT-ND; INPUT: 5.25V; OUTPUT: 3.3V
L5 = msrm:BLM?EG*1D: Murata's SMD Ferrite Bead BLM18EG Series Productdata: Part Numbering <https://www.murata.com/en-us/products/productdata/8796733767710/S0580E.pdf> package: 0402 : 220 Ohms @ 100MHz ___ Source: Digikey <https://www.digikey.de/products/en?keywords=490-17345-1-ND> ; Datasheet <https://www.murata.com/en-us/products/productdata/8799741607966/QNFA9136.pdf> package: 0603 : 100 Ohms @ 100MHz ___ Source: Digikey <https://www.digikey.de/products/en?keywords=490-5978-1-ND> ; Datasheet <https://www.murata.com/en-us/products/productdata/8796747366430/ENFA0021.pdf> 120 Ohms @ 100MHz___ Source: Digikey <https://www.digikey.de/products/en?keywords=490-3991-1-ND> ; Datasheet <https://www.murata.com/en-us/products/productdata/8796747366430/ENFA0021.pdf> 220 Ohms @ 100MHz ___ Source: Digikey <https://www.digikey.de/products/en?keywords=490-3992-6-ND> ; Datasheet <https://www.murata.com/en-us/products/productdata/8796747366430/ENFA0021.pdf> 220 Ohms @ 100MHz ___ Source: Digikey <https://www.digikey.de/products/en?keywords=490-5979-1-ND> ; Datasheet <https://www.murata.com/en-us/products/productdata/8796747366430/ENFA0021.pdf> 330 Ohms @ 100MHz ___ Source: Digikey <https://www.digikey.de/products/en?keywords=490-5913-1-ND> ; Datasheet <https://www.murata.com/en-us/products/productdata/8796747366430/ENFA0021.pdf> 390 Ohms @ 100MHz ___ Source: Digikey <https://www.digikey.de/products/en?keywords=490-5980-2-ND> ; Datasheet <https://www.murata.com/en-us/products/productdata/8796747366430/ENFA0021.pdf> 470 Ohms @ 100MHz ___ Source: Digikey <https://www.digikey.de/products/en?keywords=490-3993-1-ND> ; Datasheet <https://www.murata.com/en-us/products/productdata/8796747366430/ENFA0021.pdf> 600 Ohms @ 100MHz ___ Source: Digikey <https://www.digikey.de/products/en?keywords=490-3994-1-ND> ; Datasheet <https://www.murata.com/en-us/products/productdata/8796747366430/ENFA0021.pdf>; DC_RES: 280mOhm; DIGIKEY: 490-17345-1-ND; IMPEDANCE-FREQUENCY: 220 Ohms @ 100MHz

## Module HALL
Ports: HALL_A(out) HALL_B(out) HALL_C(out) +5V(pwr) GND(pwr)
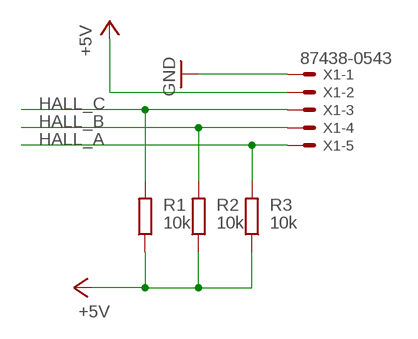
[diagram p7: schematic, module HALL, sheet 1]

### Parts
R1  RT0402BRD0710KL  [R0402]
R2  RT0402BRD0710KL  [R0402]
R3  RT0402BRD0710KL  [R0402]
X1  87438-0543  [87438-05]

### Nets
+5V: R1.1 R2.1 R3.1 X1.2
GND: X1.1
HALL_A: R3.2 X1.5
HALL_B: R2.2 X1.4
HALL_C: R1.2 X1.3

### Library data of the parts
R1-R3 = msrm:RT?BRD07*L: SMD-Resistor ±0.1% 0.063W, 1/16W Chip Resistor 0402 (1005 Metric) Thin Film package: R0402 : 1k ___ Source: Digikey <https://www.digikey.de/products/en?keywords=%20YAG1386CT-ND> ; Datasheet <https://www.yageo.com/upload/media/product/productsearch/datasheet/rchip/PYu-RT_1-to-0.01_RoHS_L_12.pdf> 2k05 ___ Source: Digikey <https://www.digikey.de/products/en?keywords=YAG1400CT-ND> ; Datasheet <https://www.yageo.com/upload/media/product/productsearch/datasheet/rchip/PYu-RT_1-to-0.01_RoHS_L_12.pdf> 3k2 ___ Source: Digikey <YAG4255CT-ND> ; Datasheet <https://www.yageo.com/upload/media/product/productsearch/datasheet/rchip/PYu-RT_1-to-0.01_RoHS_L_12.pdf> 4k99 ___ Source: Digikey <https://www.digikey.de/products/en?keywords=YAG1447CT-ND> ; Datasheet <https://www.yageo.com/upload/media/product/productsearch/datasheet/rchip/PYu-RT_1-to-0.01_RoHS_L_12.pdf> 10k ___ Source: Digikey <https://www.digikey.de/products/en?keywords=%E2%80%8EA119918CT-ND%E2%80%8E> ; Datasheet <https://www.yageo.com/upload/media/product/productsearch/datasheet/rchip/PYu-RT_1-to-0.01_RoHS_L_12.pdf> 12k ___ Source: Digikey <https://www.digikey.de/products/en?keywords=YAG1354CT-ND> ; Datasheet <https://www.yageo.com/upload/media/product/productsearch/datasheet/rchip/PYu-RT_1-to-0.01_RoHS_L_12.pdf> 22k ___ Source: Digikey <https://www.digikey.de/products/en?keywords=YAG4210CT-ND> ; Datasheet <https://www.yageo.com/upload/media/product/productsearch/datasheet/rchip/PYu-RT_1-to-0.01_RoHS_L_12.pdf> 56k ___ Source: Digikey <https://www.digikey.de/products/en?keywords=YAG1454CT-ND%20> ; Datasheet <https://www.yageo.com/upload/media/product/productsearch/datasheet/rchip/PYu-RT_1-to-0.01_RoHS_L_12.pdf> 60k4 ___ Source: Digikey <https://www.digikey.de/products/en?keywords=YAG1461CT-ND> ; Datasheet <https://www.yageo.com/upload/media/product/productsearch/datasheet/rchip/PYu-RT_1-to-0.01_RoHS_L_12.pdf> 270R ___ Source: Digikey <https://www.digikey.de/products/en?keywords=YAG1396CT-ND> ; Datasheet <https://www.yageo.com/upload/media/product/productsearch/datasheet/rchip/PYu-RT_1-to-0.01_RoHS_L_12.pdf>; DIGIKEY: ‎A119918CT-ND‎; RVALUE: 10k; SPICEPREFIX: R
X1 = msrm:8743?-05*3: Wire-to-Board 1.50mm (.059") Pitch Header -SMT, Shrouded Source: http://www.molex.com/product/micro/87438.html; COLOR: beige; DIGIKEY: WM7649CT-ND

## Module 5-3.3VCONVERTER$A
Ports: +5V(pwr) +3V3(pwr) GND(pwr)
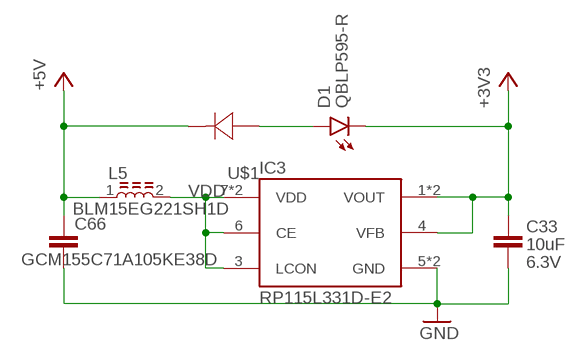
[diagram p8: schematic, module 5-3.3VCONVERTER$A, sheet 1]

### Parts
C33  GRM155C80J106ME11D  [C0402]
C66  GCM155C71A105KE38D  [C0402]
D1  QBLP595-R  [LED0402]
IC3  RP115L331D-E2  [SON40P120X160X40-9T30X130N]
L5  BLM15EG221SH1D  [BEAD0402]
U$1  MM3Z3V0B  [SODFL2513X100N]

### Nets
+3V3 [Power]: C33.1 D1.1(C) IC3.1(VOUT) IC3.2(VOUT) IC3.4(VFB)
+5V: C66.1 L5.1 U$1.C
GND [Power]: C33.2 C66.2 IC3.5(GND) IC3.9(GND)
N$1: D1.2(A) U$1.A
VDD: IC3.3(LCON) IC3.6(CE) IC3.7(VDD) IC3.8(VDD) L5.2

### Library data of the parts
C33 = msrm:GRM?C8*: CAP CER 10UF 6.3V X6S 0402 package: C0402 : 10µF ___ Source: Digikey <https://www.digikey.de/products/en?keywords=490-13233-1-ND> ; Datasheet <https://search.murata.co.jp/Ceramy/image/img/A01X/G101/ENG/GRM155C80J106ME11-01.pdf> 2.2µF ___ Source: Digikey <https://www.digikey.de/products/en?keywords=490-10012-1-ND> ; Datasheet <https://search.murata.co.jp/Ceramy/image/img/A01X/G101/ENG/GRM155C80J225KE95-01.pdf> 4.7µF ___ Source: Digikey <https://www.digikey.de/products/en?keywords=490-14458-1-ND> ; Datasheet <https://search.murata.co.jp/Ceramy/image/img/A01X/G101/ENG/GRM155C80J475MEAA-01.pdf>; CAPACITANCE: 10uF; DIGIKEY: 490-13233-1-ND; TOLERANCE: ±20%; VOLTAGE: 6.3V
C66 = msrm:GCM?C7*: Multilayer Ceramic Capacitors Chip Multilayer Ceramic Capacitors for Automotive Sources: Catalogue <https://www.murata.com/~/media/webrenewal/support/library/catalog/products/capacitor/mlcc/c03e.ashx?la=en-us> Part Numbering <https://search.murata.co.jp/Ceramy/image/img/A01X/partnumbering_e_02.pdf> package: C0402 : 490-13409-1 ___ Source: Digikey <https://www.digikey.de/products/en?keywords=490-13409-1-ND> ; Datasheet <https://www.murata.com/-/media/webrenewal/support/library/catalog/products/capacitor/ceramiccapacitor/c03e.ashx?la=en-us&cvid=20200707014404000000> 490-14427-1 ___ Source: Digikey <https://www.digikey.de/products/en?keywords=490-14427-1-ND> ; Datasheet <https://search.murata.co.jp/Ceramy/image/img/A01X/G101/ENG/GCM155C71A474KE36-01.pdf>; CAPACITANCE: 1uF; DIGIKEY: 490-13409-1-ND; TOLERANCE: ±10%; VOLTAGE: 10V
D1 = msrm:QBLP595-: LED 0402 SMD, 2V package: 0402 : Yellow-Green ___ Source: Digikey <https://www.digikey.de/product-detail/en/qt-brightek-qtb/QBLP595-AG/1516-1218-1-ND/6201915> ; Datasheet <http://www.qt-brightek.com/datasheet/QBLP595%20Series.pdf> Blue ___ Source: Digikey <https://www.digikey.de/product-detail/en/qt-brightek-qtb/QBLP595-IB/1516-1215-1-ND/6201912> ; Datasheet <http://www.qt-brightek.com/datasheet/QBLP595%20Series.pdf> Green ___ Source: Digikey <https://www.digikey.de/product-detail/en/qt-brightek-qtb/QBLP595-IG/1516-1216-1-ND/6201913> ; Datasheet <http://www.qt-brightek.com/datasheet/QBLP595%20Series.pdf> Orange ___ Source: Digikey <https://www.digikey.de/product-detail/en/qt-brightek-qtb/QBLP595-O/1516-1220-1-ND/6201917> ; Datasheet <http://www.qt-brightek.com/datasheet/QBLP595%20Series.pdf> Red ___ Source: Digikey <https://www.digikey.de/product-detail/en/qt-brightek-qtb/QBLP595-R/1516-1217-1-ND/6201914> ; Datasheet <http://www.qt-brightek.com/datasheet/QBLP595%20Series.pdf> Yellow ___ Source: Digikey <https://www.digikey.de/product-detail/en/qt-brightek-qtb/QBLP595-Y/1516-1219-1-ND/6201916> ; Datasheet <http://www.qt-brightek.com/datasheet/QBLP595%20Series.pdf>; COLOR: Red; DIGIKEY: 1516-1217-1-ND
IC3 = msrm:RP115?*: Linear Voltage Regulator IC 1 Output 1A DFN1216-8 package: 8-XFDFN Exposed Pad : L331D-E2 ___ Source: Digikey <https://www.digikey.de/products/en?keywords=2129-RP115L331D-E2CT-ND> ; Datasheet <https://www.n-redc.co.jp/en/pdf/datasheet/rp115-ea.pdf>; CURRENT: 1A; DIGIKEY: 2129-RP115L331D-E2CT-ND; INPUT: 5.25V; OUTPUT: 3.3V
L5 = msrm:BLM?EG*1D: Murata's SMD Ferrite Bead BLM18EG Series Productdata: Part Numbering <https://www.murata.com/en-us/products/productdata/8796733767710/S0580E.pdf> package: 0402 : 220 Ohms @ 100MHz ___ Source: Digikey <https://www.digikey.de/products/en?keywords=490-17345-1-ND> ; Datasheet <https://www.murata.com/en-us/products/productdata/8799741607966/QNFA9136.pdf> package: 0603 : 100 Ohms @ 100MHz ___ Source: Digikey <https://www.digikey.de/products/en?keywords=490-5978-1-ND> ; Datasheet <https://www.murata.com/en-us/products/productdata/8796747366430/ENFA0021.pdf> 120 Ohms @ 100MHz___ Source: Digikey <https://www.digikey.de/products/en?keywords=490-3991-1-ND> ; Datasheet <https://www.murata.com/en-us/products/productdata/8796747366430/ENFA0021.pdf> 220 Ohms @ 100MHz ___ Source: Digikey <https://www.digikey.de/products/en?keywords=490-3992-6-ND> ; Datasheet <https://www.murata.com/en-us/products/productdata/8796747366430/ENFA0021.pdf> 220 Ohms @ 100MHz ___ Source: Digikey <https://www.digikey.de/products/en?keywords=490-5979-1-ND> ; Datasheet <https://www.murata.com/en-us/products/productdata/8796747366430/ENFA0021.pdf> 330 Ohms @ 100MHz ___ Source: Digikey <https://www.digikey.de/products/en?keywords=490-5913-1-ND> ; Datasheet <https://www.murata.com/en-us/products/productdata/8796747366430/ENFA0021.pdf> 390 Ohms @ 100MHz ___ Source: Digikey <https://www.digikey.de/products/en?keywords=490-5980-2-ND> ; Datasheet <https://www.murata.com/en-us/products/productdata/8796747366430/ENFA0021.pdf> 470 Ohms @ 100MHz ___ Source: Digikey <https://www.digikey.de/products/en?keywords=490-3993-1-ND> ; Datasheet <https://www.murata.com/en-us/products/productdata/8796747366430/ENFA0021.pdf> 600 Ohms @ 100MHz ___ Source: Digikey <https://www.digikey.de/products/en?keywords=490-3994-1-ND> ; Datasheet <https://www.murata.com/en-us/products/productdata/8796747366430/ENFA0021.pdf>; DC_RES: 280mOhm; DIGIKEY: 490-17345-1-ND; IMPEDANCE-FREQUENCY: 220 Ohms @ 100MHz
U$1 = msrm:MM3Z3V0B: Zener Diode MM3Z3V0B: Digikey <https://www.digikey.de/en/products/detail/onsemi/MM3Z3V0B/1626763> ; Datasheet <https://www.onsemi.com/pdf/datasheet/mm3z9v1b-d.pdf> MM3Z4V7B: Digikey <https://www.digikey.de/en/products/detail/onsemi/MM3Z4V7B/1626777> ; Datasheet <https://www.onsemi.com/pdf/datasheet/mm3z9v1b-d.pdf> MM3Z3V0B: Digikey <https://www.digikey.de/en/products/detail/onsemi/MM3Z22VB/1626745> ; Datasheet <https://www.onsemi.com/pdf/datasheet/mm3z9v1b-d.pdf> MM3Z24VB: Digikey <https://www.digikey.de/en/products/detail/onsemi/MM3Z24VB/1626747> ; Datasheet <https://www.onsemi.com/pdf/datasheet/mm3z9v1b-d.pdf>; ZENER_VOLTAGE: 3.0V

## Module 5-3.3VCONVERTER$B
Ports: +5V(pwr) +3V3(pwr) GND(pwr)
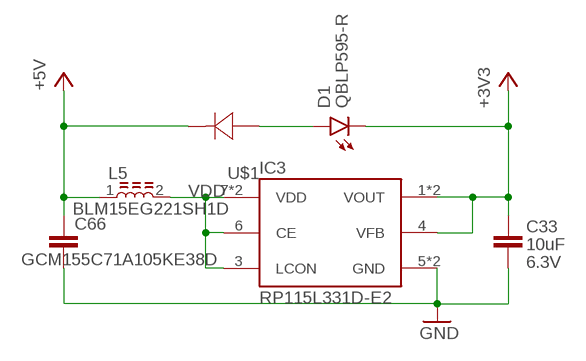
[diagram p9: schematic, module 5-3.3VCONVERTER$B, sheet 1]

### Parts
C33  GRM155C80J106ME11D  [C0402]
C66  GCM155C71A105KE38D  [C0402]
D1  QBLP595-R  [LED0402]
IC3  RP115L331D-E2  [SON40P120X160X40-9T30X130N]
L5  BLM15EG221SH1D  [BEAD0402]
U$1  MM3Z3V0B  [SODFL2513X100N]

### Nets
+3V3 [Power]: C33.1 D1.1(C) IC3.1(VOUT) IC3.2(VOUT) IC3.4(VFB)
+5V: C66.1 L5.1 U$1.C
GND [Power]: C33.2 C66.2 IC3.5(GND) IC3.9(GND)
N$1: D1.2(A) U$1.A
VDD: IC3.3(LCON) IC3.6(CE) IC3.7(VDD) IC3.8(VDD) L5.2

### Library data of the parts
C33 = msrm:GRM?C8*: CAP CER 10UF 6.3V X6S 0402 package: C0402 : 10µF ___ Source: Digikey <https://www.digikey.de/products/en?keywords=490-13233-1-ND> ; Datasheet <https://search.murata.co.jp/Ceramy/image/img/A01X/G101/ENG/GRM155C80J106ME11-01.pdf> 2.2µF ___ Source: Digikey <https://www.digikey.de/products/en?keywords=490-10012-1-ND> ; Datasheet <https://search.murata.co.jp/Ceramy/image/img/A01X/G101/ENG/GRM155C80J225KE95-01.pdf> 4.7µF ___ Source: Digikey <https://www.digikey.de/products/en?keywords=490-14458-1-ND> ; Datasheet <https://search.murata.co.jp/Ceramy/image/img/A01X/G101/ENG/GRM155C80J475MEAA-01.pdf>; CAPACITANCE: 10uF; DIGIKEY: 490-13233-1-ND; TOLERANCE: ±20%; VOLTAGE: 6.3V
C66 = msrm:GCM?C7*: Multilayer Ceramic Capacitors Chip Multilayer Ceramic Capacitors for Automotive Sources: Catalogue <https://www.murata.com/~/media/webrenewal/support/library/catalog/products/capacitor/mlcc/c03e.ashx?la=en-us> Part Numbering <https://search.murata.co.jp/Ceramy/image/img/A01X/partnumbering_e_02.pdf> package: C0402 : 490-13409-1 ___ Source: Digikey <https://www.digikey.de/products/en?keywords=490-13409-1-ND> ; Datasheet <https://www.murata.com/-/media/webrenewal/support/library/catalog/products/capacitor/ceramiccapacitor/c03e.ashx?la=en-us&cvid=20200707014404000000> 490-14427-1 ___ Source: Digikey <https://www.digikey.de/products/en?keywords=490-14427-1-ND> ; Datasheet <https://search.murata.co.jp/Ceramy/image/img/A01X/G101/ENG/GCM155C71A474KE36-01.pdf>; CAPACITANCE: 1uF; DIGIKEY: 490-13409-1-ND; TOLERANCE: ±10%; VOLTAGE: 10V
D1 = msrm:QBLP595-: LED 0402 SMD, 2V package: 0402 : Yellow-Green ___ Source: Digikey <https://www.digikey.de/product-detail/en/qt-brightek-qtb/QBLP595-AG/1516-1218-1-ND/6201915> ; Datasheet <http://www.qt-brightek.com/datasheet/QBLP595%20Series.pdf> Blue ___ Source: Digikey <https://www.digikey.de/product-detail/en/qt-brightek-qtb/QBLP595-IB/1516-1215-1-ND/6201912> ; Datasheet <http://www.qt-brightek.com/datasheet/QBLP595%20Series.pdf> Green ___ Source: Digikey <https://www.digikey.de/product-detail/en/qt-brightek-qtb/QBLP595-IG/1516-1216-1-ND/6201913> ; Datasheet <http://www.qt-brightek.com/datasheet/QBLP595%20Series.pdf> Orange ___ Source: Digikey <https://www.digikey.de/product-detail/en/qt-brightek-qtb/QBLP595-O/1516-1220-1-ND/6201917> ; Datasheet <http://www.qt-brightek.com/datasheet/QBLP595%20Series.pdf> Red ___ Source: Digikey <https://www.digikey.de/product-detail/en/qt-brightek-qtb/QBLP595-R/1516-1217-1-ND/6201914> ; Datasheet <http://www.qt-brightek.com/datasheet/QBLP595%20Series.pdf> Yellow ___ Source: Digikey <https://www.digikey.de/product-detail/en/qt-brightek-qtb/QBLP595-Y/1516-1219-1-ND/6201916> ; Datasheet <http://www.qt-brightek.com/datasheet/QBLP595%20Series.pdf>; COLOR: Red; DIGIKEY: 1516-1217-1-ND
IC3 = msrm:RP115?*: Linear Voltage Regulator IC 1 Output 1A DFN1216-8 package: 8-XFDFN Exposed Pad : L331D-E2 ___ Source: Digikey <https://www.digikey.de/products/en?keywords=2129-RP115L331D-E2CT-ND> ; Datasheet <https://www.n-redc.co.jp/en/pdf/datasheet/rp115-ea.pdf>; CURRENT: 1A; DIGIKEY: 2129-RP115L331D-E2CT-ND; INPUT: 5.25V; OUTPUT: 3.3V
L5 = msrm:BLM?EG*1D: Murata's SMD Ferrite Bead BLM18EG Series Productdata: Part Numbering <https://www.murata.com/en-us/products/productdata/8796733767710/S0580E.pdf> package: 0402 : 220 Ohms @ 100MHz ___ Source: Digikey <https://www.digikey.de/products/en?keywords=490-17345-1-ND> ; Datasheet <https://www.murata.com/en-us/products/productdata/8799741607966/QNFA9136.pdf> package: 0603 : 100 Ohms @ 100MHz ___ Source: Digikey <https://www.digikey.de/products/en?keywords=490-5978-1-ND> ; Datasheet <https://www.murata.com/en-us/products/productdata/8796747366430/ENFA0021.pdf> 120 Ohms @ 100MHz___ Source: Digikey <https://www.digikey.de/products/en?keywords=490-3991-1-ND> ; Datasheet <https://www.murata.com/en-us/products/productdata/8796747366430/ENFA0021.pdf> 220 Ohms @ 100MHz ___ Source: Digikey <https://www.digikey.de/products/en?keywords=490-3992-6-ND> ; Datasheet <https://www.murata.com/en-us/products/productdata/8796747366430/ENFA0021.pdf> 220 Ohms @ 100MHz ___ Source: Digikey <https://www.digikey.de/products/en?keywords=490-5979-1-ND> ; Datasheet <https://www.murata.com/en-us/products/productdata/8796747366430/ENFA0021.pdf> 330 Ohms @ 100MHz ___ Source: Digikey <https://www.digikey.de/products/en?keywords=490-5913-1-ND> ; Datasheet <https://www.murata.com/en-us/products/productdata/8796747366430/ENFA0021.pdf> 390 Ohms @ 100MHz ___ Source: Digikey <https://www.digikey.de/products/en?keywords=490-5980-2-ND> ; Datasheet <https://www.murata.com/en-us/products/productdata/8796747366430/ENFA0021.pdf> 470 Ohms @ 100MHz ___ Source: Digikey <https://www.digikey.de/products/en?keywords=490-3993-1-ND> ; Datasheet <https://www.murata.com/en-us/products/productdata/8796747366430/ENFA0021.pdf> 600 Ohms @ 100MHz ___ Source: Digikey <https://www.digikey.de/products/en?keywords=490-3994-1-ND> ; Datasheet <https://www.murata.com/en-us/products/productdata/8796747366430/ENFA0021.pdf>; DC_RES: 280mOhm; DIGIKEY: 490-17345-1-ND; IMPEDANCE-FREQUENCY: 220 Ohms @ 100MHz
U$1 = msrm:MM3Z3V0B: Zener Diode MM3Z3V0B: Digikey <https://www.digikey.de/en/products/detail/onsemi/MM3Z3V0B/1626763> ; Datasheet <https://www.onsemi.com/pdf/datasheet/mm3z9v1b-d.pdf> MM3Z4V7B: Digikey <https://www.digikey.de/en/products/detail/onsemi/MM3Z4V7B/1626777> ; Datasheet <https://www.onsemi.com/pdf/datasheet/mm3z9v1b-d.pdf> MM3Z3V0B: Digikey <https://www.digikey.de/en/products/detail/onsemi/MM3Z22VB/1626745> ; Datasheet <https://www.onsemi.com/pdf/datasheet/mm3z9v1b-d.pdf> MM3Z24VB: Digikey <https://www.digikey.de/en/products/detail/onsemi/MM3Z24VB/1626747> ; Datasheet <https://www.onsemi.com/pdf/datasheet/mm3z9v1b-d.pdf>; ZENER_VOLTAGE: 3.0V

## Module 5-3.3VCONVERTER$C
Ports: +5V(pwr) +3V3(pwr) GND(pwr)
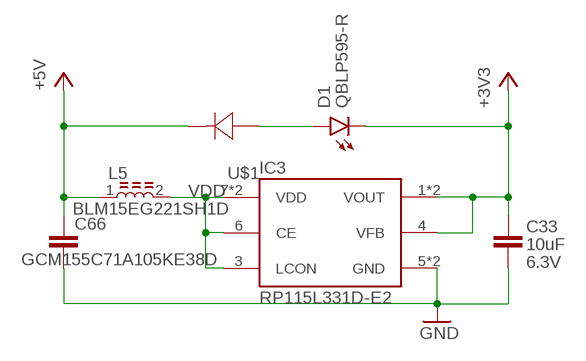
[diagram p10: schematic, module 5-3.3VCONVERTER$C, sheet 1]

### Parts
C33  GRM155C80J106ME11D  [C0402]
C66  GCM155C71A105KE38D  [C0402]
D1  QBLP595-R  [LED0402]
IC3  RP115L331D-E2  [SON40P120X160X40-9T30X130N]
L5  BLM15EG221SH1D  [BEAD0402]
U$1  MM3Z3V0B  [SODFL2513X100N]

### Nets
+3V3 [Power]: C33.1 D1.1(C) IC3.1(VOUT) IC3.2(VOUT) IC3.4(VFB)
+5V: C66.1 L5.1 U$1.C
GND [Power]: C33.2 C66.2 IC3.5(GND) IC3.9(GND)
N$1: D1.2(A) U$1.A
VDD: IC3.3(LCON) IC3.6(CE) IC3.7(VDD) IC3.8(VDD) L5.2

### Library data of the parts
C33 = msrm:GRM?C8*: CAP CER 10UF 6.3V X6S 0402 package: C0402 : 10µF ___ Source: Digikey <https://www.digikey.de/products/en?keywords=490-13233-1-ND> ; Datasheet <https://search.murata.co.jp/Ceramy/image/img/A01X/G101/ENG/GRM155C80J106ME11-01.pdf> 2.2µF ___ Source: Digikey <https://www.digikey.de/products/en?keywords=490-10012-1-ND> ; Datasheet <https://search.murata.co.jp/Ceramy/image/img/A01X/G101/ENG/GRM155C80J225KE95-01.pdf> 4.7µF ___ Source: Digikey <https://www.digikey.de/products/en?keywords=490-14458-1-ND> ; Datasheet <https://search.murata.co.jp/Ceramy/image/img/A01X/G101/ENG/GRM155C80J475MEAA-01.pdf>; CAPACITANCE: 10uF; DIGIKEY: 490-13233-1-ND; TOLERANCE: ±20%; VOLTAGE: 6.3V
C66 = msrm:GCM?C7*: Multilayer Ceramic Capacitors Chip Multilayer Ceramic Capacitors for Automotive Sources: Catalogue <https://www.murata.com/~/media/webrenewal/support/library/catalog/products/capacitor/mlcc/c03e.ashx?la=en-us> Part Numbering <https://search.murata.co.jp/Ceramy/image/img/A01X/partnumbering_e_02.pdf> package: C0402 : 490-13409-1 ___ Source: Digikey <https://www.digikey.de/products/en?keywords=490-13409-1-ND> ; Datasheet <https://www.murata.com/-/media/webrenewal/support/library/catalog/products/capacitor/ceramiccapacitor/c03e.ashx?la=en-us&cvid=20200707014404000000> 490-14427-1 ___ Source: Digikey <https://www.digikey.de/products/en?keywords=490-14427-1-ND> ; Datasheet <https://search.murata.co.jp/Ceramy/image/img/A01X/G101/ENG/GCM155C71A474KE36-01.pdf>; CAPACITANCE: 1uF; DIGIKEY: 490-13409-1-ND; TOLERANCE: ±10%; VOLTAGE: 10V
D1 = msrm:QBLP595-: LED 0402 SMD, 2V package: 0402 : Yellow-Green ___ Source: Digikey <https://www.digikey.de/product-detail/en/qt-brightek-qtb/QBLP595-AG/1516-1218-1-ND/6201915> ; Datasheet <http://www.qt-brightek.com/datasheet/QBLP595%20Series.pdf> Blue ___ Source: Digikey <https://www.digikey.de/product-detail/en/qt-brightek-qtb/QBLP595-IB/1516-1215-1-ND/6201912> ; Datasheet <http://www.qt-brightek.com/datasheet/QBLP595%20Series.pdf> Green ___ Source: Digikey <https://www.digikey.de/product-detail/en/qt-brightek-qtb/QBLP595-IG/1516-1216-1-ND/6201913> ; Datasheet <http://www.qt-brightek.com/datasheet/QBLP595%20Series.pdf> Orange ___ Source: Digikey <https://www.digikey.de/product-detail/en/qt-brightek-qtb/QBLP595-O/1516-1220-1-ND/6201917> ; Datasheet <http://www.qt-brightek.com/datasheet/QBLP595%20Series.pdf> Red ___ Source: Digikey <https://www.digikey.de/product-detail/en/qt-brightek-qtb/QBLP595-R/1516-1217-1-ND/6201914> ; Datasheet <http://www.qt-brightek.com/datasheet/QBLP595%20Series.pdf> Yellow ___ Source: Digikey <https://www.digikey.de/product-detail/en/qt-brightek-qtb/QBLP595-Y/1516-1219-1-ND/6201916> ; Datasheet <http://www.qt-brightek.com/datasheet/QBLP595%20Series.pdf>; COLOR: Red; DIGIKEY: 1516-1217-1-ND
IC3 = msrm:RP115?*: Linear Voltage Regulator IC 1 Output 1A DFN1216-8 package: 8-XFDFN Exposed Pad : L331D-E2 ___ Source: Digikey <https://www.digikey.de/products/en?keywords=2129-RP115L331D-E2CT-ND> ; Datasheet <https://www.n-redc.co.jp/en/pdf/datasheet/rp115-ea.pdf>; CURRENT: 1A; DIGIKEY: 2129-RP115L331D-E2CT-ND; INPUT: 5.25V; OUTPUT: 3.3V
L5 = msrm:BLM?EG*1D: Murata's SMD Ferrite Bead BLM18EG Series Productdata: Part Numbering <https://www.murata.com/en-us/products/productdata/8796733767710/S0580E.pdf> package: 0402 : 220 Ohms @ 100MHz ___ Source: Digikey <https://www.digikey.de/products/en?keywords=490-17345-1-ND> ; Datasheet <https://www.murata.com/en-us/products/productdata/8799741607966/QNFA9136.pdf> package: 0603 : 100 Ohms @ 100MHz ___ Source: Digikey <https://www.digikey.de/products/en?keywords=490-5978-1-ND> ; Datasheet <https://www.murata.com/en-us/products/productdata/8796747366430/ENFA0021.pdf> 120 Ohms @ 100MHz___ Source: Digikey <https://www.digikey.de/products/en?keywords=490-3991-1-ND> ; Datasheet <https://www.murata.com/en-us/products/productdata/8796747366430/ENFA0021.pdf> 220 Ohms @ 100MHz ___ Source: Digikey <https://www.digikey.de/products/en?keywords=490-3992-6-ND> ; Datasheet <https://www.murata.com/en-us/products/productdata/8796747366430/ENFA0021.pdf> 220 Ohms @ 100MHz ___ Source: Digikey <https://www.digikey.de/products/en?keywords=490-5979-1-ND> ; Datasheet <https://www.murata.com/en-us/products/productdata/8796747366430/ENFA0021.pdf> 330 Ohms @ 100MHz ___ Source: Digikey <https://www.digikey.de/products/en?keywords=490-5913-1-ND> ; Datasheet <https://www.murata.com/en-us/products/productdata/8796747366430/ENFA0021.pdf> 390 Ohms @ 100MHz ___ Source: Digikey <https://www.digikey.de/products/en?keywords=490-5980-2-ND> ; Datasheet <https://www.murata.com/en-us/products/productdata/8796747366430/ENFA0021.pdf> 470 Ohms @ 100MHz ___ Source: Digikey <https://www.digikey.de/products/en?keywords=490-3993-1-ND> ; Datasheet <https://www.murata.com/en-us/products/productdata/8796747366430/ENFA0021.pdf> 600 Ohms @ 100MHz ___ Source: Digikey <https://www.digikey.de/products/en?keywords=490-3994-1-ND> ; Datasheet <https://www.murata.com/en-us/products/productdata/8796747366430/ENFA0021.pdf>; DC_RES: 280mOhm; DIGIKEY: 490-17345-1-ND; IMPEDANCE-FREQUENCY: 220 Ohms @ 100MHz
U$1 = msrm:MM3Z3V0B: Zener Diode MM3Z3V0B: Digikey <https://www.digikey.de/en/products/detail/onsemi/MM3Z3V0B/1626763> ; Datasheet <https://www.onsemi.com/pdf/datasheet/mm3z9v1b-d.pdf> MM3Z4V7B: Digikey <https://www.digikey.de/en/products/detail/onsemi/MM3Z4V7B/1626777> ; Datasheet <https://www.onsemi.com/pdf/datasheet/mm3z9v1b-d.pdf> MM3Z3V0B: Digikey <https://www.digikey.de/en/products/detail/onsemi/MM3Z22VB/1626745> ; Datasheet <https://www.onsemi.com/pdf/datasheet/mm3z9v1b-d.pdf> MM3Z24VB: Digikey <https://www.digikey.de/en/products/detail/onsemi/MM3Z24VB/1626747> ; Datasheet <https://www.onsemi.com/pdf/datasheet/mm3z9v1b-d.pdf>; ZENER_VOLTAGE: 3.0V

## Module MICROCONTROLLER
Ports: +3V3(pwr) GND(pwr) ADC_A(io) ADC_B(io) EN_A(io) EN_B(io) EN_C(io) PWM_A(io) PWM_B(io) PWM_C(io) ECAT_GPIO4(io) ECAT_GPIO3(io) ECAT_GPIO2(io) ECAT_GPIO1(io) ECAT_SPI_DATA3(io) ECAT_SPI_DATA2(io) ECAT_SPI_DATA1(io) ECAT_SPI_DATA0(io) ECAT_SPI_CS(io) ECAT_SPI_SCK(io) HALL_A(io) HALL_B(io) HALL_C(io) HALL_OUT(io) ENC_TX(io) ENC_RX(io) ADC_TS(io) NSLEEP(io) NFAULT(io) VREF_TS(io) ENCODER_SPI_MISO(io) ENCODER_SPI_MOSI(io) ENCODER_SPI_NCS(io) ENCODER_SPI_SCK(io)
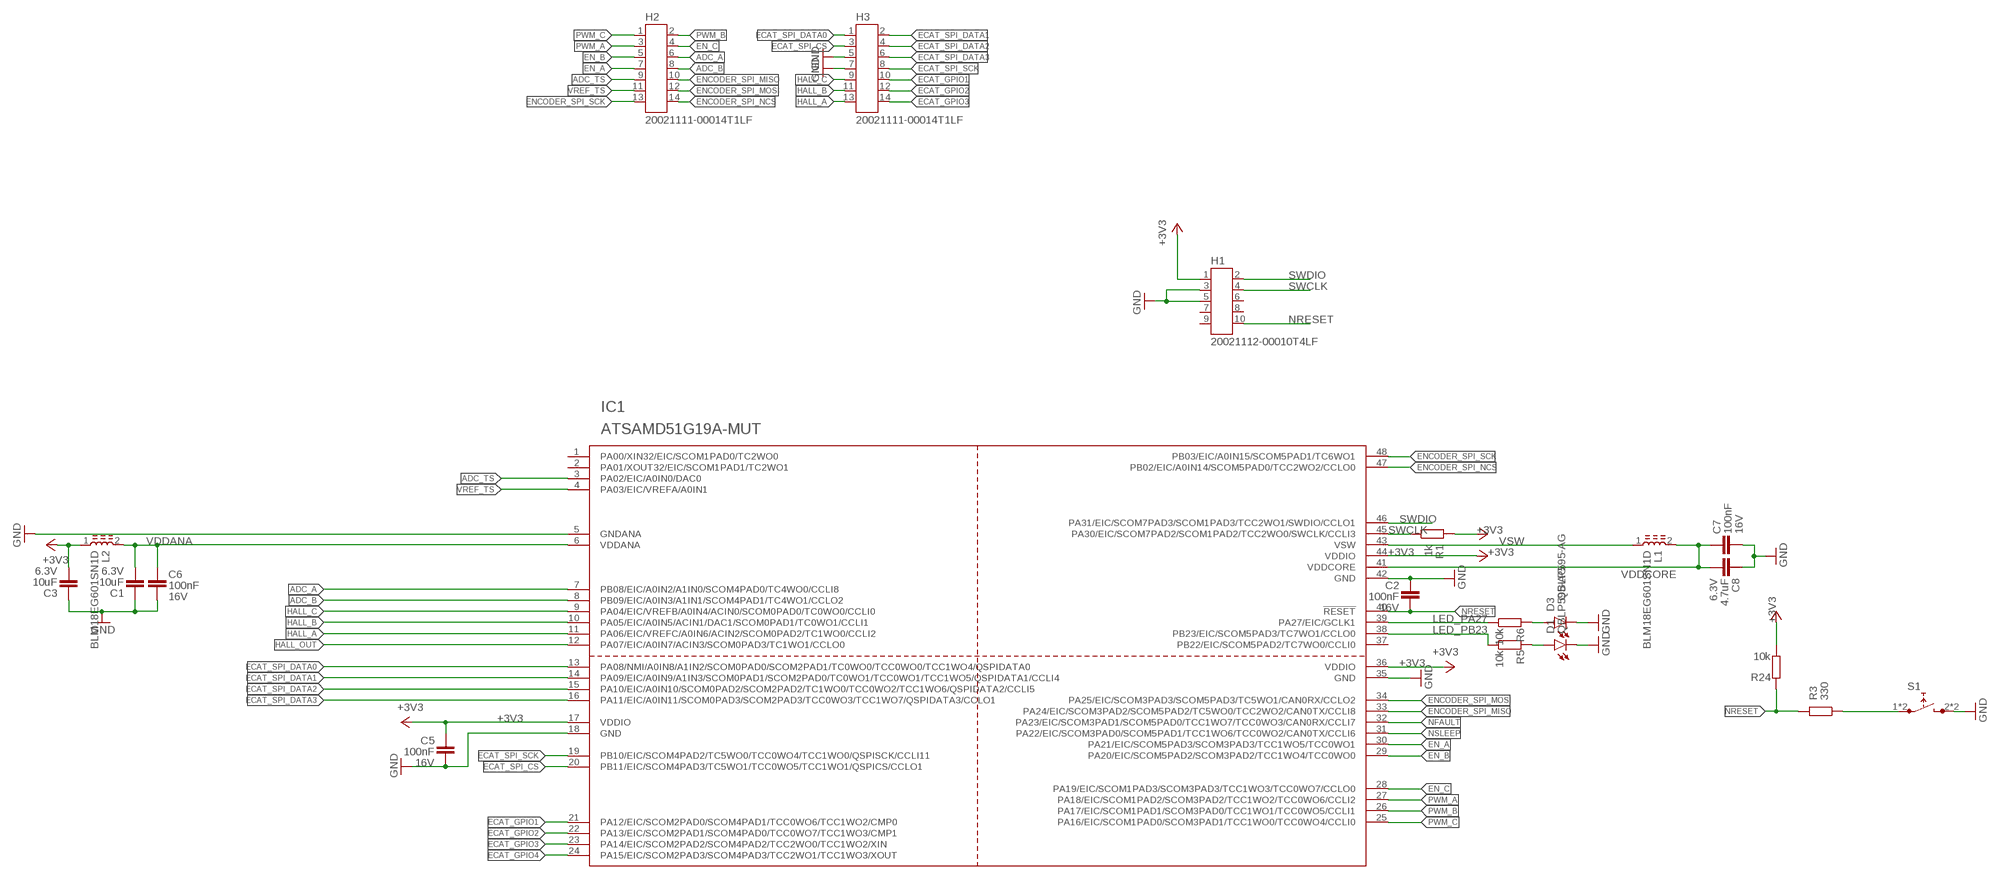
[diagram p11: schematic, module MICROCONTROLLER, sheet 1]

### Parts
C1  GRM155C80J106ME11D  [C0402]
C2  GCM155R71C104JA55  [C0402]
C3  GRM155C80J106ME11D  [C0402]
C5  GCM155R71C104JA55  [C0402]
C6  GCM155R71C104JA55  [C0402]
C7  GCM155R71C104JA55  [C0402]
C8  GRM155C80J475MEAAD  [C0402]
D1  QBLP595-AG  [LED0402]
D3  QBLP595-AG  [LED0402]
H1  20021112-00010T4LF  [20021112-00010]
H2  20021111-00014T1LF  [20021111-00014]
H3  20021111-00014T1LF  [20021111-00014]
IC1  ATSAMD51G19A-MUT  [QFN48]
L1  BLM18EG601SN1D  [BEADC1608X80]
L2  BLM18EG601SN1D  [BEADC1608X80]
R1  RT0402FRE071KL  [R0402]
R3  RT0603FRE07330RL  [R0603]
R5  10k  RT0402FRE0710KL  [R0402]
R6  10k  RT0402FRE0710KL  [R0402]
R24  10k  RT0402FRE0710KL  [R0402]
S1  USLPT2616CT2TR  [USLPT2616CT]

### Nets
+3V3: C3.2 C5.1 H1.1 IC1.17(VDDIO) IC1.36(VDDIO) IC1.44(VDDIO) L2.1 R1.2 R24.1
ADC_A: H2.6 IC1.7(PB08/EIC/A0IN2/A1IN0/SCOM4PAD0/TC4WO0/CCLI8)
ADC_B: H2.8 IC1.8(PB09/EIC/A0IN3/A1IN1/SCOM4PAD1/TC4WO1/CCLO2)
ADC_TS: H2.9 IC1.3(PA02/EIC/A0IN0/DAC0)
ECAT_GPIO1: H3.10 IC1.21(PA12/EIC/SCOM2PAD0/SCOM4PAD1/TCC0WO6/TCC1WO2/CMP0)
ECAT_GPIO2: H3.12 IC1.22(PA13/EIC/SCOM2PAD1/SCOM4PAD0/TCC0WO7/TCC1WO3/CMP1)
ECAT_GPIO3: H3.14 IC1.23(PA14/EIC/SCOM2PAD2/SCOM4PAD2/TCC2WO0/TCC1WO2/XIN)
ECAT_GPIO4: IC1.24(PA15/EIC/SCOM2PAD3/SCOM4PAD3/TCC2WO1/TCC1WO3/XOUT)
ECAT_SPI_CS: H3.3 IC1.20(PB11/EIC/SCOM4PAD3/TC5WO1/TCC0WO5/TCC1WO1/QSPICS/CCLO1)
ECAT_SPI_DATA0: H3.1 IC1.13(PA08/NMI/A0IN8/A1IN2/SCOM0PAD0/SCOM2PAD1/TC0WO0/TCC0WO0/TCC1WO4/QSPIDATA0)
ECAT_SPI_DATA1: H3.2 IC1.14(PA09/EIC/A0IN9/A1IN3/SCOM0PAD1/SCOM2PAD0/TC0WO1/TCC0WO1/TCC1WO5/QSPIDATA1/CCLI4)
ECAT_SPI_DATA2: H3.4 IC1.15(PA10/EIC/A0IN10/SCOM0PAD2/SCOM2PAD2/TC1WO0/TCC0WO2/TCC1WO6/QSPIDATA2/CCLI5)
ECAT_SPI_DATA3: H3.6 IC1.16(PA11/EIC/A0IN11/SCOM0PAD3/SCOM2PAD3/TCC0WO3/TCC1WO7/QSPIDATA3/CCLO1)
ECAT_SPI_SCK: H3.8 IC1.19(PB10/EIC/SCOM4PAD2/TC5WO0/TCC0WO4/TCC1WO0/QSPISCK/CCLI11)
EN_A: H2.7 IC1.30(PA21/EIC/SCOM5PAD3/SCOM3PAD3/TCC1WO5/TCC0WO1)
EN_B: H2.5 IC1.29(PA20/EIC/SCOM5PAD2/SCOM3PAD2/TCC1WO4/TCC0WO0)
EN_C: H2.4 IC1.28(PA19/EIC/SCOM1PAD3/SCOM3PAD3/TCC1WO3/TCC0WO7/CCLO0)
ENCODER_SPI_MISO: H2.10 IC1.33(PA24/EIC/SCOM3PAD2/SCOM5PAD2/TC5WO0/TCC2WO2/CAN0TX/CCLI8)
ENCODER_SPI_MOSI: H2.12 IC1.34(PA25/EIC/SCOM3PAD3/SCOM5PAD3/TC5WO1/CAN0RX/CCLO2)
ENCODER_SPI_NCS: H2.14 IC1.47(PB02/EIC/A0IN14/SCOM5PAD0/TCC2WO2/CCLO0)
ENCODER_SPI_SCK: H2.13 IC1.48(PB03/EIC/A0IN15/SCOM5PAD1/TC6WO1)
GND: C1.1 C2.1 C3.1 C5.2 C6.2 C7.2 C8.1 D1.1(C) D3.1(C) H1.3 H1.5 H3.5 H3.7 IC1.5(GNDANA) IC1.18(GND) IC1.35(GND) IC1.42(GND) S1.2 S1.4
HALL_A: H3.13 IC1.11(PA06/EIC/VREFC/A0IN6/ACIN2/SCOM0PAD2/TC1WO0/CCLI2)
HALL_B: H3.11 IC1.10(PA05/EIC/A0IN5/ACIN1/DAC1/SCOM0PAD1/TC0WO1/CCLI1)
HALL_C: H3.9 IC1.9(PA04/EIC/VREFB/A0IN4/ACIN0/SCOM0PAD0/TC0WO0/CCLI0)
HALL_OUT: IC1.12(PA07/EIC/A0IN7/ACIN3/SCOM0PAD3/TC1WO1/CCLO0)
LED_PA27: IC1.39(PA27/EIC/GCLK1) R6.1
LED_PB23: IC1.38(PB23/EIC/SCOM5PAD3/TC7WO1/CCLO0) R5.1
N$1: R3.1 S1.1 S1.3
N$2: D3.2(A) R6.2
N$4: D1.2(A) R5.2
NFAULT: IC1.32(PA23/EIC/SCOM3PAD1/SCOM5PAD0/TCC1WO7/TCC0WO3/CAN0RX/CCLI7)
NRESET: C2.2 H1.10 IC1.40(!RESET) R3.2 R24.2
NSLEEP: IC1.31(PA22/EIC/SCOM3PAD0/SCOM5PAD1/TCC1WO6/TCC0WO2/CAN0TX/CCLI6)
PWM_A: H2.3 IC1.27(PA18/EIC/SCOM1PAD2/SCOM3PAD2/TCC1WO2/TCC0WO6/CCLI2)
PWM_B: H2.2 IC1.26(PA17/EIC/SCOM1PAD1/SCOM3PAD0/TCC1WO1/TCC0WO5/CCLI1)
PWM_C: H2.1 IC1.25(PA16/EIC/SCOM1PAD0/SCOM3PAD1/TCC1WO0/TCC0WO4/CCLI0)
SWCLK: H1.4 IC1.45(PA30/EIC/SCOM7PAD2/SCOM1PAD2/TCC2WO0/SWCLK/CCLI3) R1.1
SWDIO: H1.2 IC1.46(PA31/EIC/SCOM7PAD3/SCOM1PAD3/TCC2WO1/SWDIO/CCLO1)
VDDANA: C1.2 C6.1 IC1.6(VDDANA) L2.2
VDDCORE: C7.1 C8.2 IC1.41(VDDCORE) L1.2
VREF_TS: H2.11 IC1.4(PA03/EIC/VREFA/A0IN1)
VSW: IC1.43(VSW) L1.1
Unconnected: H1.6 H1.7 H1.8 H1.9 IC1.1(PA00/XIN32/EIC/SCOM1PAD0/TC2WO0) IC1.2(PA01/XOUT32/EIC/SCOM1PAD1/TC2WO1) IC1.37(PB22/EIC/SCOM5PAD2/TC7WO0/CCLI0)

### Library data of the parts
C1 C3 = msrm:GRM?C8*: CAP CER 10UF 6.3V X6S 0402 package: C0402 : 10µF ___ Source: Digikey <https://www.digikey.de/products/en?keywords=490-13233-1-ND> ; Datasheet <https://search.murata.co.jp/Ceramy/image/img/A01X/G101/ENG/GRM155C80J106ME11-01.pdf> 2.2µF ___ Source: Digikey <https://www.digikey.de/products/en?keywords=490-10012-1-ND> ; Datasheet <https://search.murata.co.jp/Ceramy/image/img/A01X/G101/ENG/GRM155C80J225KE95-01.pdf> 4.7µF ___ Source: Digikey <https://www.digikey.de/products/en?keywords=490-14458-1-ND> ; Datasheet <https://search.murata.co.jp/Ceramy/image/img/A01X/G101/ENG/GRM155C80J475MEAA-01.pdf>; CAPACITANCE: 10uF; DIGIKEY: 490-13233-1-ND; TOLERANCE: ±20%; VOLTAGE: 6.3V
C2 C5-C7 = msrm:GCM?R7*: Multilayer Ceramic Capacitors Chip Multilayer Ceramic Capacitors for Automotive –55 to 125°C Sources: Catalogue <https://www.murata.com/~/media/webrenewal/support/library/catalog/products/capacitor/mlcc/c03e.ashx?la=en-us> Part Numbering <https://search.murata.co.jp/Ceramy/image/img/A01X/partnumbering_e_02.pdf> package: C0201 : 470pF ___ Source: Digikey <https://www.digikey.de/products/en?keywords=490-17744-1-ND> ; Datasheet <https://search.murata.co.jp/Ceramy/image/img/A01X/G101/ENG/GCM033R71E471KA03-01.pdf> package: C0402 : 100nF ___ Source: Digikey <https://www.digikey.de/products/en?keywords=490-16433-1-ND> ; Datasheet <https://search.murata.co.jp/Ceramy/image/img/A01X/G101/ENG/GCM155R71C104JA55-01.pdf> 220nF ___ Source: Digikey <https://www.digikey.de/products/en?keywords=490-10671-1-ND> ; Datasheet <https://www.murata.com/-/media/webrenewal/support/library/catalog/products/capacitor/ceramiccapacitor/c03e.ashx?la=en-us&cvid=20200707014404000000> 6.8nF ___ Source: Digikey <https://www.digikey.de/products/en?keywords=490-12655-1-ND> ; Datasheet <https://search.murata.co.jp/Ceramy/image/img/A01X/G101/ENG/GCM155R71C683KA55-01.pdf> 10nF ___ Source: Digikey <https://www.digikey.de/products/en?keywords=490-6043-1-ND> ; Datasheet <https://search.murata.co.jp/Ceramy/image/img/A01X/G101/ENG/GCM155R71E103KA37-01.pdf> 22nF ___ Source: Digikey <https://www.digikey.de/products/en?keywords=490-6044-1-ND> ; Datasheet <https://search.murata.co.jp/Ceramy/image/img/A01X/G101/ENG/GCM155R71E223KA55-01.pdf> 470pF ___ Source: Digikey <https://www.digikey.de/products/en?keywords=490-4913-1-ND> ; Datasheet <https://search.murata.co.jp/Ceramy/image/img/A01X/G101/ENG/GCM155R71H471KA37-01.pdf> package: C0603 : 1µF ___ Source: Digikey <https://www.digikey.de/products/en?keywords=490-5241-1-ND> ; Datasheet <https://www.murata.com/-/media/webrenewal/support/library/catalog/products/capacitor/ceramiccapacitor/c03e.ashx?la=en-us&cvid=20200707014404000000> 470nF ___ Source: Digikey <https://www.digikey.de/products/en?keywords=490-12589-1-ND> ; Datasheet <https://search.murata.co.jp/Ceramy/image/img/A01X/G101/ENG/GCM188R71C474KA55-01.pdf> 10nF ___ Source: Digikey <https://www.digikey.de/products/en?keywords=490-4781-1-ND> ; Datasheet <https://search.murata.co.jp/Ceramy/image/img/A01X/G101/ENG/GCM188R72A103KA37-01.pdf> 22nF ___ Source: Digikey <https://www.digikey.de/products/en?keywords=490-4782-1-ND> ; Datasheet <https://www.murata.com/-/media/webrenewal/support/library/catalog/products/capacitor/ceramiccapacitor/c03e.ashx?la=en-us&cvid=20200707014404000000> package: C0805 : 10µF ___ Source: Digikey <https://www.digikey.de/products/en?keywords=490-14361-1-ND> ; Datasheet <https://search.murata.co.jp/Ceramy/image/img/A01X/G101/ENG/GCM21BR70J106KE22-01.pdf> 2.2µF ___ Source: Digikey <https://www.digikey.de/products/en?keywords=490-4786-1-ND> ; Datasheet <https://search.murata.co.jp/Ceramy/image/img/A01X/G101/ENG/GCM21BR71C225KA64-01.pdf> 470nF ___ Source: Digikey <https://www.digikey.de/products/en?keywords=490-4788-1-ND> ; Datasheet <https://search.murata.co.jp/Ceramy/image/img/A01X/G101/ENG/GCM21BR71H474KA55-01.pdf> 100nF ___ Source: Digikey <https://www.digikey.de/products/en?keywords=490-8051-1-ND> ; Datasheet <https://search.murata.co.jp/Ceramy/image/img/A01X/G101/ENG/GCM21BR72A104KA37-01.pdf> package: C0805K : 220nF ___ Source: Digikey <https://www.digikey.de/products/en?keywords=490-8306-1-ND> ; Datasheet <https://search.murata.co.jp/Ceramy/image/img/A01X/G101/ENG/GRM21AR72A224KAC5-01.pdf> package: C1206 : 10µF ___ Source: Digikey <https://www.digikey.de/products/en?keywords=490-14746-1-ND> ; Datasheet <https://search.murata.co.jp/Ceramy/image/img/A01X/G101/ENG/GCM31CR71C106KA64-01.pdf> 2.2µF ___ Source: Digikey <https://www.digikey.de/products/en?keywords=490-11169-1-ND> ; Datasheet <https://search.murata.co.jp/Ceramy/image/img/A01X/G101/ENG/GCM31CR71H225KA55-01.pdf> package: C1206 : 2220nF ___ Source: Digikey <https://www.digikey.de/products/en?keywords=490-4975-1-ND> ; Datasheet <https://search.murata.co.jp/Ceramy/image/img/A01X/G101/ENG/GCM31MR72A224KA37-01.pdf>; CAPACITANCE: 100nF; DIGIKEY: 490-16433-1-ND; TOLERANCE: ±5%; VOLTAGE: 16V
C8 = msrm:GRM?C8*: CAP CER 10UF 6.3V X6S 0402 package: C0402 : 10µF ___ Source: Digikey <https://www.digikey.de/products/en?keywords=490-13233-1-ND> ; Datasheet <https://search.murata.co.jp/Ceramy/image/img/A01X/G101/ENG/GRM155C80J106ME11-01.pdf> 2.2µF ___ Source: Digikey <https://www.digikey.de/products/en?keywords=490-10012-1-ND> ; Datasheet <https://search.murata.co.jp/Ceramy/image/img/A01X/G101/ENG/GRM155C80J225KE95-01.pdf> 4.7µF ___ Source: Digikey <https://www.digikey.de/products/en?keywords=490-14458-1-ND> ; Datasheet <https://search.murata.co.jp/Ceramy/image/img/A01X/G101/ENG/GRM155C80J475MEAA-01.pdf>; CAPACITANCE: 4.7uF; DIGIKEY: 490-14458-1-ND; TOLERANCE: ±20%; VOLTAGE: 6.3V
D1 D3 = msrm:QBLP595-: LED 0402 SMD, 2V package: 0402 : Yellow-Green ___ Source: Digikey <https://www.digikey.de/product-detail/en/qt-brightek-qtb/QBLP595-AG/1516-1218-1-ND/6201915> ; Datasheet <http://www.qt-brightek.com/datasheet/QBLP595%20Series.pdf> Blue ___ Source: Digikey <https://www.digikey.de/product-detail/en/qt-brightek-qtb/QBLP595-IB/1516-1215-1-ND/6201912> ; Datasheet <http://www.qt-brightek.com/datasheet/QBLP595%20Series.pdf> Green ___ Source: Digikey <https://www.digikey.de/product-detail/en/qt-brightek-qtb/QBLP595-IG/1516-1216-1-ND/6201913> ; Datasheet <http://www.qt-brightek.com/datasheet/QBLP595%20Series.pdf> Orange ___ Source: Digikey <https://www.digikey.de/product-detail/en/qt-brightek-qtb/QBLP595-O/1516-1220-1-ND/6201917> ; Datasheet <http://www.qt-brightek.com/datasheet/QBLP595%20Series.pdf> Red ___ Source: Digikey <https://www.digikey.de/product-detail/en/qt-brightek-qtb/QBLP595-R/1516-1217-1-ND/6201914> ; Datasheet <http://www.qt-brightek.com/datasheet/QBLP595%20Series.pdf> Yellow ___ Source: Digikey <https://www.digikey.de/product-detail/en/qt-brightek-qtb/QBLP595-Y/1516-1219-1-ND/6201916> ; Datasheet <http://www.qt-brightek.com/datasheet/QBLP595%20Series.pdf>; COLOR: Yellow-Green; DIGIKEY: 1516-1218-1-ND
H1 = msrm:20021?10*LF: Connector Header Surface Mount 10 position 0.050" (1.27mm) Variant: 111-000 609-5923-ND ___ Source: Digikey <https://www.digikey.de/products/de?keywords=609-5923-ND> ; Datasheet <https://cdn.amphenol-icc.com/media/wysiwyg/files/drawing/20021111.pdf> 609-3712-ND ___ Source: Digikey <https://www.digikey.de/products/de?keywords=609-3712-ND> ; Datasheet <https://media.digikey.com/pdf/Data%20Sheets/FCI%20PDFs/Minitek%20127_Catalog.pdf> Variant: 112-000 609-5926-ND ___ Source: Digikey <https://www.digikey.de/products/de?keywords=609-5926-ND> ; Datasheet <https://cdn.amphenol-icc.com/media/wysiwyg/files/drawing/20021112.pdf> Variant: 121-000 609-3695-1-ND ___ Source: Digikey <https://www.digikey.de/products/de?keywords=609-3695-1-ND> ; Datasheet <https://cdn.amphenol-icc.com/media/wysiwyg/files/drawing/20021121.pdf> 609-6529-ND ___ Source: Digikey <https://www.digikey.de/products/de?keywords=609-6529-ND> ; Datasheet <https://cdn.amphenol-icc.com/media/wysiwyg/files/drawing/20021121.pdf> 609-3729-ND ___ Source: Digikey <https://www.digikey.de/products/de?keywords=609-3729-ND> ; Datasheet <https://cdn.amphenol-icc.com/media/wysiwyg/files/drawing/20021121.pdf> Variant: 311-000 609-3754-ND ___ Source: Digikey <https://www.digikey.de/products/de?keywords=609-3754-ND> ; Datasheet <https://cdn.amphenol-icc.com/media/wysiwyg/files/drawing/20021311.pdf>; DIGIKEY: 609-5926-ND; PINS: 10
H2 H3 = msrm:20021?14*LF: CONN RCPT 14POS 0.05 GOLD SMD Source: Digikey <https://www.digikey.de/products/de?keywords=609-3771-ND> ; Datasheet <https://media.digikey.com/pdf/Data%20Sheets/FCI%20PDFs/Minitek%20127_Catalog.pdf>; DIGIKEY: 609-4810-ND
IC1 = msrm:ATSAMD51G: Atmel C21 32bit ARM Cortex-M0 microcontroller. Pins 64 GPIO 52 TC 5 TCC 3 DMA 12 USB No CAN 2 CCL 4 SERCOM 6 I2S 0 DIVAS Yes ADCch 20 ADC 2 ADCSDch 3 AC 4 DAC 1 TSENS 1 RTC 1 EIC 16 PTC 32 FREQM Yes MAX_F 48MHz EVENTS 12 WDT Yes SWDI Yes package: QFN48 : D51G18A-MUTCT ___ Source: Digikey <https://www.digikey.de/products/de?keywords=ATSAMD51G18A-MUTCT-ND> ; Datasheet <http://www.microchip.com/mymicrochip/filehandler.aspx?ddocname=en599585> D51G19A-MU ______ Source: Digikey <https://www.digikey.de/products/de?keywords=ATSAMD51G19A-MU-ND> ; Datasheet <http://www.microchip.com/mymicrochip/filehandler.aspx?ddocname=en599585>; DIGIKEY: ATSAMD51G19A-MU-ND; FLASH: 512KB; SRAM: 192KB
L1 L2 = msrm:BLM?EG*1D: Murata's SMD Ferrite Bead BLM18EG Series Productdata: Part Numbering <https://www.murata.com/en-us/products/productdata/8796733767710/S0580E.pdf> package: 0402 : 220 Ohms @ 100MHz ___ Source: Digikey <https://www.digikey.de/products/en?keywords=490-17345-1-ND> ; Datasheet <https://www.murata.com/en-us/products/productdata/8799741607966/QNFA9136.pdf> package: 0603 : 100 Ohms @ 100MHz ___ Source: Digikey <https://www.digikey.de/products/en?keywords=490-5978-1-ND> ; Datasheet <https://www.murata.com/en-us/products/productdata/8796747366430/ENFA0021.pdf> 120 Ohms @ 100MHz___ Source: Digikey <https://www.digikey.de/products/en?keywords=490-3991-1-ND> ; Datasheet <https://www.murata.com/en-us/products/productdata/8796747366430/ENFA0021.pdf> 220 Ohms @ 100MHz ___ Source: Digikey <https://www.digikey.de/products/en?keywords=490-3992-6-ND> ; Datasheet <https://www.murata.com/en-us/products/productdata/8796747366430/ENFA0021.pdf> 220 Ohms @ 100MHz ___ Source: Digikey <https://www.digikey.de/products/en?keywords=490-5979-1-ND> ; Datasheet <https://www.murata.com/en-us/products/productdata/8796747366430/ENFA0021.pdf> 330 Ohms @ 100MHz ___ Source: Digikey <https://www.digikey.de/products/en?keywords=490-5913-1-ND> ; Datasheet <https://www.murata.com/en-us/products/productdata/8796747366430/ENFA0021.pdf> 390 Ohms @ 100MHz ___ Source: Digikey <https://www.digikey.de/products/en?keywords=490-5980-2-ND> ; Datasheet <https://www.murata.com/en-us/products/productdata/8796747366430/ENFA0021.pdf> 470 Ohms @ 100MHz ___ Source: Digikey <https://www.digikey.de/products/en?keywords=490-3993-1-ND> ; Datasheet <https://www.murata.com/en-us/products/productdata/8796747366430/ENFA0021.pdf> 600 Ohms @ 100MHz ___ Source: Digikey <https://www.digikey.de/products/en?keywords=490-3994-1-ND> ; Datasheet <https://www.murata.com/en-us/products/productdata/8796747366430/ENFA0021.pdf>; DC_RES: 350mOhm; DIGIKEY: 490-3994-1-ND; IMPEDANCE-FREQUENCY: 600 Ohms @ 100MHz
R1 = msrm:RT?FRE07*L: SMD RESISTOR ± 1% Tol, Paper/PE taping reel, 50 ppm/°C, 7 inch dia. Reel Datasheet <http://www.yageo.com/documents/recent/PYu-RT_1-to-0.01_RoHS_L_11.pdf> package: 0201 : 0R ___ Source: Digikey <https://www.digikey.de/products/en?keywords=311-0.0MCT-ND> 1k ___ Source: Digikey <https://www.digikey.de/products/en?keywords=RT0201FRE071KL-ND> 10k ___ Source: Digikey <https://www.digikey.de/products/en?keywords=RT0201FRE0710KL-ND> 100 ___ Source: Digikey <https://www.digikey.de/products/en?keywords=RT0201FRE07100RL-ND> 330 ___ Source: Digikey <https://www.digikey.de/products/en?keywords=RT0201FRE07330RL-ND> package: 0402 : 0R ___ Source: Digikey <https://www.digikey.de/products/en?keywords=311-0.0LRCT-ND> 1k ___ Source: Digikey <https://www.digikey.de/products/en?keywords=%20YAG1234CT-ND> 2k2 ___ Source: Digikey <https://www.digikey.de/products/en?keywords=RT0402FRE072K2L-ND> 2k ___ Source: Digikey <https://www.digikey.de/products/en?keywords=YAG3345CT-ND> 4k7 ___ Source: Digikey <https://www.digikey.de/products/en?keywords=YAG3347CT-ND%20> 10k ___ Source: Digikey <https://www.digikey.de/products/en?keywords=YAG1233CT-ND> 12k1 ___ Source: Digikey <https://www.digikey.de/products/en?keywords=RT0402FRE0712K1L-ND> 49R9 ___ Source: Digikey <https://www.digikey.de/products/en?keywords=YAG3346CT-ND> 56k ___ Source: Digikey <https://www.digikey.de/products/en?keywords=RT0402FRE0756K2L-ND> 100k ___ Source: Digikey <https://www.digikey.de/products/en?keywords=YAG2307CT-ND> 100 ___ Source: Digikey <https://www.digikey.de/products/en?keywords=YAG3342CT-ND> 150 ___ Source: Digikey <https://www.digikey.de/product-detail/en/yageo/RT0402FRE07150RL/13-RT0402FRE07150RLCT-ND/12705162> 300 ___ Source: Digikey <https://www.digikey.de/products/en?keywords=RT0402FRE07300RL-ND> package: 0603 : 0R ___ Source: Digikey <https://www.digikey.de/products/en?keywords=311-0.0HRCT-ND> 1k ___ Source: Digikey <https://www.digikey.de/products/en?keywords=YAG2323CT-ND> 10k ___ Source: Digikey <https://www.digikey.de/products/en?keywords=YAG2321CT-ND> 100k ___ Source: Digikey <https://www.digikey.de/products/en?keywords=YAG2319CT-ND> 100 ___ Source: Digikey <https://www.digikey.de/products/en?keywords=YAG2320CT-ND> 300 ___ Source: Digikey <https://www.digikey.de/products/en?keywords=RT0603FRE07300RL-ND> 330 ___ Source: Digikey <https://www.digikey.de/products/en?keywords=YAG5957CT-ND>; DIGIKEY: YAG1234CT-ND; RVALUE: 1k; SPICEPREFIX: R
R3 = msrm:RT?FRE07*L: SMD RESISTOR ± 1% Tol, Paper/PE taping reel, 50 ppm/°C, 7 inch dia. Reel Datasheet <http://www.yageo.com/documents/recent/PYu-RT_1-to-0.01_RoHS_L_11.pdf> package: 0201 : 0R ___ Source: Digikey <https://www.digikey.de/products/en?keywords=311-0.0MCT-ND> 1k ___ Source: Digikey <https://www.digikey.de/products/en?keywords=RT0201FRE071KL-ND> 10k ___ Source: Digikey <https://www.digikey.de/products/en?keywords=RT0201FRE0710KL-ND> 100 ___ Source: Digikey <https://www.digikey.de/products/en?keywords=RT0201FRE07100RL-ND> 330 ___ Source: Digikey <https://www.digikey.de/products/en?keywords=RT0201FRE07330RL-ND> package: 0402 : 0R ___ Source: Digikey <https://www.digikey.de/products/en?keywords=311-0.0LRCT-ND> 1k ___ Source: Digikey <https://www.digikey.de/products/en?keywords=%20YAG1234CT-ND> 2k2 ___ Source: Digikey <https://www.digikey.de/products/en?keywords=RT0402FRE072K2L-ND> 2k ___ Source: Digikey <https://www.digikey.de/products/en?keywords=YAG3345CT-ND> 4k7 ___ Source: Digikey <https://www.digikey.de/products/en?keywords=YAG3347CT-ND%20> 10k ___ Source: Digikey <https://www.digikey.de/products/en?keywords=YAG1233CT-ND> 12k1 ___ Source: Digikey <https://www.digikey.de/products/en?keywords=RT0402FRE0712K1L-ND> 49R9 ___ Source: Digikey <https://www.digikey.de/products/en?keywords=YAG3346CT-ND> 56k ___ Source: Digikey <https://www.digikey.de/products/en?keywords=RT0402FRE0756K2L-ND> 100k ___ Source: Digikey <https://www.digikey.de/products/en?keywords=YAG2307CT-ND> 100 ___ Source: Digikey <https://www.digikey.de/products/en?keywords=YAG3342CT-ND> 150 ___ Source: Digikey <https://www.digikey.de/product-detail/en/yageo/RT0402FRE07150RL/13-RT0402FRE07150RLCT-ND/12705162> 300 ___ Source: Digikey <https://www.digikey.de/products/en?keywords=RT0402FRE07300RL-ND> package: 0603 : 0R ___ Source: Digikey <https://www.digikey.de/products/en?keywords=311-0.0HRCT-ND> 1k ___ Source: Digikey <https://www.digikey.de/products/en?keywords=YAG2323CT-ND> 10k ___ Source: Digikey <https://www.digikey.de/products/en?keywords=YAG2321CT-ND> 100k ___ Source: Digikey <https://www.digikey.de/products/en?keywords=YAG2319CT-ND> 100 ___ Source: Digikey <https://www.digikey.de/products/en?keywords=YAG2320CT-ND> 300 ___ Source: Digikey <https://www.digikey.de/products/en?keywords=RT0603FRE07300RL-ND> 330 ___ Source: Digikey <https://www.digikey.de/products/en?keywords=YAG5957CT-ND>; DIGIKEY: YAG5957CT-ND; RVALUE: 330; SPICEPREFIX: R
R5 R6 R24 = msrm:RT?FRE07*L: SMD RESISTOR ± 1% Tol, Paper/PE taping reel, 50 ppm/°C, 7 inch dia. Reel Datasheet <http://www.yageo.com/documents/recent/PYu-RT_1-to-0.01_RoHS_L_11.pdf> package: 0201 : 0R ___ Source: Digikey <https://www.digikey.de/products/en?keywords=311-0.0MCT-ND> 1k ___ Source: Digikey <https://www.digikey.de/products/en?keywords=RT0201FRE071KL-ND> 10k ___ Source: Digikey <https://www.digikey.de/products/en?keywords=RT0201FRE0710KL-ND> 100 ___ Source: Digikey <https://www.digikey.de/products/en?keywords=RT0201FRE07100RL-ND> 330 ___ Source: Digikey <https://www.digikey.de/products/en?keywords=RT0201FRE07330RL-ND> package: 0402 : 0R ___ Source: Digikey <https://www.digikey.de/products/en?keywords=311-0.0LRCT-ND> 1k ___ Source: Digikey <https://www.digikey.de/products/en?keywords=%20YAG1234CT-ND> 2k2 ___ Source: Digikey <https://www.digikey.de/products/en?keywords=RT0402FRE072K2L-ND> 2k ___ Source: Digikey <https://www.digikey.de/products/en?keywords=YAG3345CT-ND> 4k7 ___ Source: Digikey <https://www.digikey.de/products/en?keywords=YAG3347CT-ND%20> 10k ___ Source: Digikey <https://www.digikey.de/products/en?keywords=YAG1233CT-ND> 12k1 ___ Source: Digikey <https://www.digikey.de/products/en?keywords=RT0402FRE0712K1L-ND> 49R9 ___ Source: Digikey <https://www.digikey.de/products/en?keywords=YAG3346CT-ND> 56k ___ Source: Digikey <https://www.digikey.de/products/en?keywords=RT0402FRE0756K2L-ND> 100k ___ Source: Digikey <https://www.digikey.de/products/en?keywords=YAG2307CT-ND> 100 ___ Source: Digikey <https://www.digikey.de/products/en?keywords=YAG3342CT-ND> 150 ___ Source: Digikey <https://www.digikey.de/product-detail/en/yageo/RT0402FRE07150RL/13-RT0402FRE07150RLCT-ND/12705162> 300 ___ Source: Digikey <https://www.digikey.de/products/en?keywords=RT0402FRE07300RL-ND> package: 0603 : 0R ___ Source: Digikey <https://www.digikey.de/products/en?keywords=311-0.0HRCT-ND> 1k ___ Source: Digikey <https://www.digikey.de/products/en?keywords=YAG2323CT-ND> 10k ___ Source: Digikey <https://www.digikey.de/products/en?keywords=YAG2321CT-ND> 100k ___ Source: Digikey <https://www.digikey.de/products/en?keywords=YAG2319CT-ND> 100 ___ Source: Digikey <https://www.digikey.de/products/en?keywords=YAG2320CT-ND> 300 ___ Source: Digikey <https://www.digikey.de/products/en?keywords=RT0603FRE07300RL-ND> 330 ___ Source: Digikey <https://www.digikey.de/products/en?keywords=YAG5957CT-ND>; DIGIKEY: YAG1233CT-ND; RVALUE: 10k; SPICEPREFIX: R
S1 = msrm:USLPT?*TR: Tactile Switch SPST-NO Top Actuated Surface Mount 450-3357-1 ___ Source: Digikey <https://www.digikey.de/products/en?keywords=450-3357-1-ND> ; Datasheet <https://media.digikey.com/pdf/Data%20Sheets/Tyco%20Electronics%20Alcoswitch%20PDFs/USLPT2616_DS.pdf>; DIGIKEY: 450-3357-1-ND; FORCE: 160gf; HEIGHT: 0.55mm; MANUFACTURER_NAME: TE Connectivity; MANUFACTURER_PART_NUMBER: USLPT2616CT2TR; MOUSER_PART_NUMBER: 506-USLPT2616CT2TR

## Net classes
0 Signal: width 0.152 mm, drill 0.2 mm, clearance 0.152 mm
1 Power: width 0.5 mm, drill 0.2 mm, clearance 0.152 mm
2 Ethernet: width 0.152 mm, drill 0.25 mm, clearance 0.1 mm